# EasyEDA Pro project ProPrj_MBC1  FRAM（AM29F016）(定稿)_2024-09-28.epro, board 1
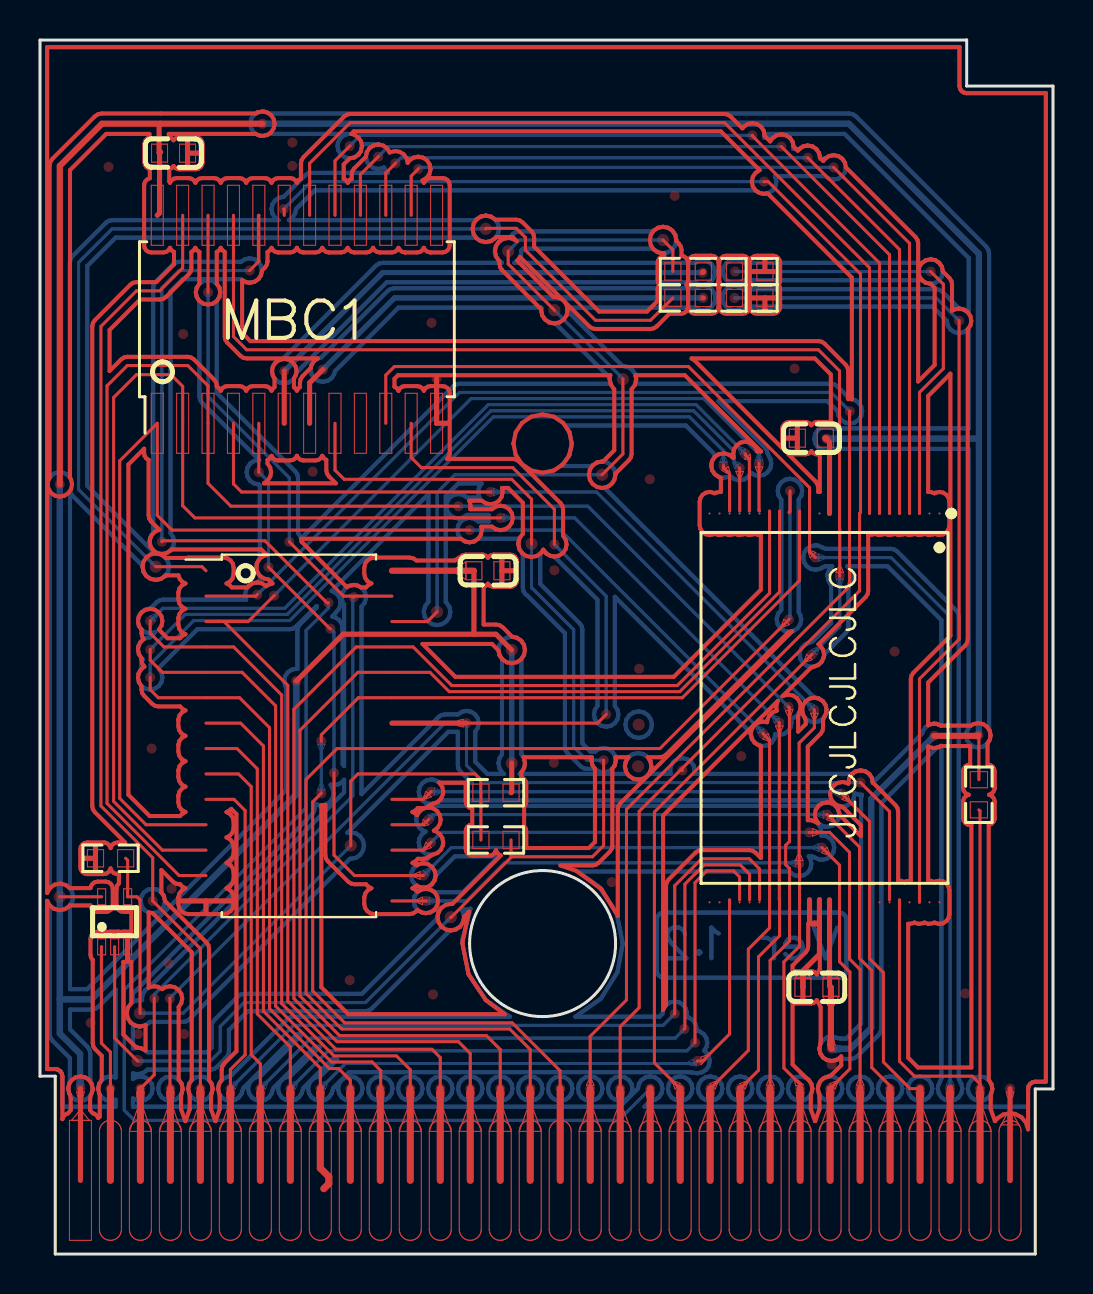
[diagram p3: board, top side]
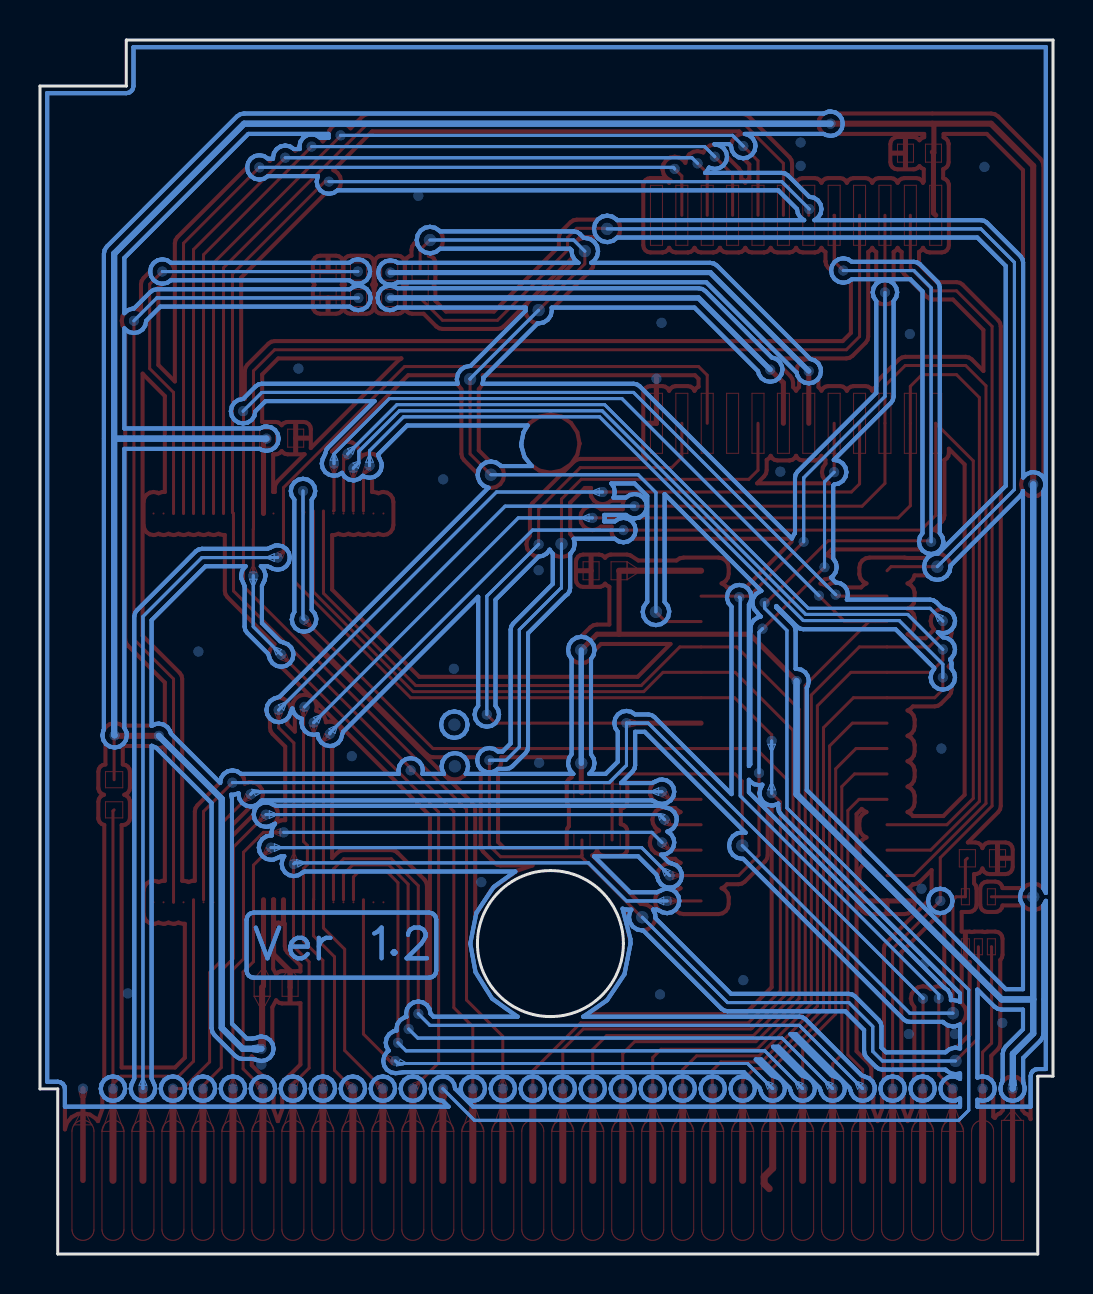
[diagram p4: board, bottom side, seen from below]

Outline 50.67 x 60.7 mm; copper layers: Top Layer, Bottom Layer. Coordinates in mm from the lower left corner of the outline.
Outline path: 0,60.7 46.35,60.7 46.35,58.4 50.67,58.4 50.67,8.25 49.78,8.25 49.78,0 0.76,0 0.76,8.89 0,8.89 0,60.7 ; 21.49,15.52 arc(25.14,19.17) 28.79,15.52 arc(25.14,11.87) 21.49,15.52

## Placement (name value [footprint] x y rotation side)

## Nets

## Routing (per net, layer and track width the routed paths; a pad name or vN(x,y) marks a point on that pad's centre or on a via; arc(x,y) is an arc through that point)
(no net): length 8305.5
  Top Layer w0.152: 35.02,8.27 35.94,9.19 35.94,14.86 36.99,15.91 36.99,17.71 36.98,17.72 36.98,26.57 ; 22.53,38.1 10.08,38.1 9.68,38.51 9.68,41.54 ; 10.95,49.64 10.95,49.63 10.49,49.17 ; 10.95,49.64 10.93,49.66 10.93,51.92 10.95,51.94 10.95,49.64 ; 25.73,35.48 25.73,37.24 23.65,39.32 19.07,39.32 18.57,39.83 18.57,41.54 ; 8.3,20.19 6.12,20.19 3.68,22.63 3.68,42.82 4.83,43.97 6.55,43.97 7.14,43.38 7.14,37.41 7.75,36.81 23.04,36.81 ; 35.64,55.93 35.64,55.91 41.99,49.55 41.99,37.03 ; 45.97,46.66 45.97,30.73 43.99,28.75 43.99,17.58 ; 8.3,34.16 8.1,34.37 5.79,34.37 ; 32.23,11.25 32.26,11.28 32.26,18.49 33.22,19.46 35.03,19.46 35.49,18.99 35.49,17.71 ; 14.07,23.04 13.64,22.61 13.64,13.16 15.24,11.56 23.62,11.56 26.01,9.17 26.02,8.27 ; 22.06,20.7 22.06,23.06 22.05,23.07 22.05,23.72 21.77,24 15.9,24 15.54,23.65 15.54,20.42 ; 31.66,47.8 30.54,46.69 27.79,46.69 24.28,50.19 24.28,50.83 23.82,51.28 22.33,51.28 22.3,51.26 ; 12.52,8.27 12.52,10.35 10.87,12 10.87,24.26 9.85,25.27 8.3,25.27 ; 44.55,49.12 45.19,48.49 45.19,44.27 43.99,43.08 43.99,37.03 ; 35.99,37.15 35.97,37.18 35.97,39.52 ; 17.6,20.19 19.18,20.19 19.56,20.57 ; 5.51,30.23 5.51,29.69 6.12,29.08 10.11,29.08 11.79,27.41 11.79,12.39 14.58,9.6 16.61,9.6 17.04,9.17 17.04,8.29 17.02,8.27 ; 19.86,32.11 19.38,31.62 17.6,31.62 ; 21.52,8.27 21.52,10.02 20.93,10.62 14.86,10.62 12.7,12.77 12.7,27.24 15.82,30.35 18.67,30.35 20.6,28.42 31.88,28.42 36.49,33.04 36.49,37.15 ; 16.92,54.86 16.03,53.97 16.03,51.94 ; 32.08,24.24 40.99,33.15 41,37.03 ; 32.08,24.24 29.97,22.13 29.97,12.32 29.02,11.37 29.02,8.27 ; 32.08,24.24 32.13,24.18 32.13,24.18 ; 38.79,34.82 38.49,35.12 38.49,38.32 32.44,44.37 17.73,44.37 17.3,43.94 17.3,41.54 ; 35.99,17.71 35.99,19.25 35.48,19.76 33.1,19.76 31.75,18.42 31.75,12.01 ; 46.97,22.21 47.02,22.15 47.02,8.5 ; 25.73,47.19 23.42,49.5 23.42,50.14 ; 19.56,23.11 19.18,22.73 17.6,22.73 ; 17.3,51.94 17.3,54.05 17.78,54.53 ; 19.43,21.72 19.18,21.46 17.6,21.46 ; 31.17,50.7 31.66,50.21 31.66,49.12 ; 23.56,19.94 23.56,19.83 20.57,16.84 20.55,16.84 ; 23.56,19.94 23.56,20.7 ; 23.56,19.94 23.64,19.86 27.63,19.86 28.19,20.42 28.19,24.69 ; 3.08,15.36 3.07,15.35 3.07,10.54 3.52,10.09 3.52,8.27 ; 34.49,17.71 34.49,11 33.15,9.65 32.89,9.65 ; 14.76,51.94 14.76,54.66 15.49,55.4 ; 9.52,8.27 9.52,9.22 10.26,9.96 10.26,22.17 9.7,22.73 8.3,22.73 ; 35.28,40 35.28,39.95 35.48,39.75 35.48,37.15 ; 3.73,15.36 3.73,10.79 4.88,9.65 ; 8.3,32.89 10.79,32.89 10.87,32.97 ; 9.2,31.62 12.4,28.43 12.4,12.65 14.81,10.24 19.61,10.24 20.02,9.82 20.02,8.27 ; 5.51,28.83 5.51,28.22 5.92,27.81 9.98,27.81 11.48,26.32 11.48,12.27 14.48,9.27 14.94,9.27 15.52,8.68 15.52,8.27 ; 17.6,32.89 15.19,32.89 12.47,35.61 ; 33.52,8.27 35.43,10.18 35.43,15.24 36.49,16.3 36.49,25.69 36.17,26.01 ; 34.99,17.71 34.99,18.86 34.7,19.15 33.35,19.15 32.77,18.57 32.77,10.57 ; 12.22,51.94 12.22,52.22 12.19,52.25 ; 42.99,17.71 42.99,9.64 43.74,8.89 46.63,8.89 47.02,8.5 ; 38.48,21.08 39.5,21.08 40.49,20.09 40.49,14.75 41.02,14.22 41.02,8.27 ; 38.61,29.97 30.73,22.1 30.73,9.56 32.02,8.27 ; 14.02,8.27 14.02,9.29 11.18,12.14 11.18,25.4 10.04,26.54 8.3,26.54 ; 42.49,37.03 42.49,49.96 37.08,55.37 ; 20.93,37.39 9.55,37.39 8.41,38.53 8.41,43.41 7.39,44.42 4.37,44.42 3.35,43.41 3.35,22.53 6.96,18.92 8.3,18.92 ; 40,33.91 40,36.24 39.99,36.25 39.99,44.16 38.94,45.21 10.34,45.21 9.68,45.87 9.68,51.94 ; 8.02,8.27 8.02,15.27 5.64,17.65 5.64,19.81 3.05,22.4 3.05,46.38 4.83,48.16 5.99,48.16 7.14,49.3 7.14,51.94 ; 26.01,7.98 26.02,7.97 ; 47.02,8.5 47.02,8.27 ; 8.9,31.62 10.41,31.62 11.71,32.92 ; 8.9,31.62 8.89,31.63 ; 8.9,31.62 8.3,31.62 ; 8.3,24 9.93,24 10.57,23.37 10.57,9.97 11.02,9.51 11.02,8.27 ; 14.07,25.65 14.07,25.96 15.93,27.81 32.13,27.81 37.99,33.67 37.99,37.15 ; 38.41,54.81 42.99,50.22 42.99,37.03 ; 28.32,26.97 27.89,26.54 21.34,26.54 ; 14.71,24.05 14.71,19.94 15.73,18.92 19.18,18.92 ; 17.6,17.65 19.3,17.65 ; 37.47,31.72 31.01,25.27 14.86,25.27 13.31,23.72 13.31,13.03 15.06,11.28 15.09,11.28 15.11,11.25 23.5,11.25 24.52,10.22 24.52,8.27 ; 36.22,53.62 36.42,53.62 41.04,49 41.04,37.08 40.99,37.03 ; 34.19,39.42 34.19,39.32 34.49,39.01 34.49,37.15 ; 8.3,21.46 5.31,21.46 3.99,22.78 3.99,39.66 5.87,41.54 5.87,36.93 6.6,36.19 21.49,36.19 ; 6.5,12.78 6.5,8.29 6.52,8.27 ; 18.52,8.27 18.52,9.21 17.83,9.91 14.71,9.91 12.09,12.52 12.09,27.95 9.69,30.35 6.2,30.35 5.51,31.04 5.51,31.65 ; 37.52,38.15 37.52,37.14 37.47,37.08 ; 24.59,35.51 24.59,37.74 23.6,38.73 15.22,38.73 14.76,39.19 14.76,41.54 ; 0.99,17.86 1,17.86 3.08,17.86 ; 5.72,12.78 5.72,8.96 5.02,8.27 ; 39.37,21.97 40.99,20.35 40.99,14.78 41.6,14.17 41.6,9.32 42.52,8.4 42.52,8.27 ; 27.52,8.27 27.52,10.89 29.34,12.7 29.34,22.23 40.49,33.39 40.49,42.12 40.51,42.14 ; 8.41,48.08 8.41,51.94 ; 41.05,23.57 42.49,22.12 42.49,17.71 ; 29.16,43.74 29.16,40 28.12,38.96 ; 37.44,27.36 37.49,27.31 37.49,20.62 37.3,20.43 37.3,19.47 37.49,19.28 37.49,15.65 36.52,14.68 36.52,8.27 ; 39.52,8.27 40.51,9.26 40.51,14.1 39.99,14.62 39.99,19.44 39.12,20.32 ; 44.02,8.27 43.52,8.27 42.19,9.6 42.19,14.07 41.49,14.77 41.49,21.63 40.13,22.99 ; 14.43,32.56 14.35,32.56 11.25,35.66 6.15,35.66 6.1,35.61 ; 18.57,51.94 18.57,53.9 18.92,54.25 ; 13.49,51.94 13.49,54.53 15.52,56.57 34.24,56.57 41.49,49.31 41.49,37.03 ; 36.99,37.15 36.99,33.11 32,28.12 20.47,28.12 19.51,29.08 15.9,29.08 13,26.19 13,12.9 14.98,10.92 22.33,10.92 23.02,10.23 23.02,8.27 ; 5,12.04 5,17.7 4.85,17.86 4.38,17.86 4.38,19.69 4.28,19.79 ; 10.95,39.09 10.95,41.54 ; 38.74,27.2 38.74,26.31 37.97,25.55 37.97,19.51 37.99,19.49 37.99,15.39 37.21,14.61 37.21,9.29 38.02,8.48 38.02,8.27 ; 46.94,25.93 46.97,25.91 46.97,23.72 ; 11.43,34.34 14.5,31.27 14.53,31.27 ; 35,39.29 35,37.15 ; 39.7,54.33 43.49,50.54 43.49,37.03 ; 15.7,32.84 15.75,32.89
  Top Layer w0.203: 35.5,48.23 35.52,48.34 35.58,48.46 35.53,48.56 35.5,48.69 ; 35.5,48.23 35.5,47.37 ; 35.5,48.23 35.5,47.37 ; 35.5,48.23 35.47,48.37 35.42,48.46 35.48,48.59 35.5,48.69 ; 35.5,49.56 35.5,48.69 ; 35.5,49.56 35.5,48.69 ; 35.5,49.56 35.47,49.69 35.39,49.81 35.28,49.89 35.14,49.91 34.34,49.91 34.2,49.89 34.08,49.81 34,49.69 33.98,49.56 33.98,48.69 34,48.56 34.06,48.46 33.99,48.34 33.98,48.23 33.98,47.37 34,47.23 34.08,47.12 34.2,47.04 34.34,47.01 35.14,47.01 35.28,47.04 35.39,47.12 35.47,47.23 35.5,47.37 ; 35.5,49.56 35.53,49.69 35.61,49.81 35.72,49.89 35.86,49.91 36.66,49.91 36.8,49.89 36.92,49.81 37,49.69 37.02,49.56 37.02,48.69 37.01,48.59 36.94,48.46 37,48.37 37.02,48.23 37.02,47.37 37,47.23 36.92,47.12 36.8,47.04 36.66,47.01 35.86,47.01 35.72,47.04 35.61,47.12 35.53,47.23 35.5,47.37 ; 9.54,17.14 9.65,17.31 9.69,17.5 9.69,17.8 9.65,18 9.54,18.16 9.37,18.27 9.33,18.29 9.5,18.38 9.63,18.54 9.69,18.73 9.69,18.77 9.69,19.07 9.65,19.27 9.54,19.43 9.37,19.54 9.33,19.56 9.5,19.65 9.63,19.81 9.69,20 9.69,20.04 9.69,20.34 9.65,20.54 9.54,20.7 9.37,20.81 9.33,20.83 9.5,20.92 9.63,21.08 9.69,21.27 9.69,21.31 9.69,21.61 9.65,21.81 9.54,21.97 9.37,22.08 9.33,22.1 9.5,22.19 9.57,22.25 9.83,21.99 9.83,10.14 9.22,9.53 9.12,9.38 9.09,9.22 9.09,8.7 8.96,8.5 8.91,8.27 8.96,8.03 8.98,7.98 8.99,7.82 8.99,7.24 8.78,6.65 8.77,6.65 8.77,6.65 8.56,7.24 8.56,7.82 8.56,7.98 8.63,8.21 8.63,8.27 8.59,8.5 8.46,8.7 8.46,15.27 8.42,15.44 8.33,15.58 6.25,17.66 6.2,17.89 6.07,18.08 6.07,19.19 6.65,18.62 6.79,18.52 6.96,18.49 7.01,18.49 7.15,18.35 7.28,18.29 7.1,18.19 6.98,18.04 6.92,17.85 6.92,17.8 6.92,17.5 6.96,17.31 7.07,17.14 7.23,17.03 7.43,17 9.18,17 9.37,17.03 9.54,17.14 ; 46.94,26.55 46.7,26.5 46.57,26.42 45.07,26.42 44.85,26.51 44.73,26.52 44.49,26.47 44.43,26.44 44.43,28.57 46.28,30.43 46.38,30.57 46.41,30.73 46.41,46.23 46.54,46.43 46.59,46.66 46.54,46.89 46.41,47.09 46.21,47.23 45.97,47.27 45.74,47.23 45.62,47.16 45.62,48.49 45.59,48.66 45.49,48.8 45.16,49.13 45.12,49.36 44.98,49.56 44.78,49.69 44.55,49.74 44.32,49.69 44.12,49.56 43.99,49.36 43.94,49.12 43.99,48.89 44.12,48.69 44.32,48.56 44.55,48.51 44.75,48.31 44.75,44.45 43.93,43.63 43.93,50.54 43.89,50.7 43.8,50.84 40.31,54.33 40.26,54.57 40.13,54.77 39.93,54.9 39.7,54.94 39.47,54.9 39.27,54.76 39.18,54.65 39.02,54.81 38.97,55.05 38.84,55.25 38.64,55.38 38.41,55.42 38.17,55.38 37.97,55.25 37.9,55.17 37.7,55.37 37.65,55.61 37.52,55.81 37.32,55.94 37.08,55.98 36.85,55.94 36.65,55.8 36.53,55.63 36.25,55.91 36.25,55.93 36.2,56.17 36.07,56.36 35.87,56.5 35.64,56.54 35.4,56.5 35.2,56.36 35.14,56.28 34.55,56.87 34.41,56.97 34.24,57 15.52,57 15.35,56.97 15.21,56.87 13.18,54.84 13.09,54.7 13.05,54.53 13.05,53.77 12.94,53.69 12.86,53.58 12.85,53.56 12.78,53.68 12.66,53.76 12.53,53.79 11.92,53.79 11.78,53.77 11.66,53.69 11.59,53.57 11.58,53.56 11.51,53.68 11.39,53.76 11.26,53.79 10.65,53.79 10.51,53.77 10.39,53.69 10.32,53.57 10.31,53.56 10.24,53.68 10.12,53.76 9.99,53.79 9.38,53.79 9.24,53.77 9.12,53.69 9.05,53.57 9.04,53.56 8.97,53.68 8.85,53.76 8.72,53.79 8.11,53.79 7.97,53.77 7.85,53.69 7.78,53.57 7.77,53.56 7.7,53.68 7.58,53.76 7.45,53.79 6.84,53.79 6.7,53.77 6.58,53.69 6.51,53.57 6.5,53.56 6.47,53.64 6.47,54.24 6.59,54.3 6.68,54.4 6.78,54.3 6.91,54.24 6.98,54.23 7.78,54.23 7.92,54.26 8.03,54.34 8.11,54.45 8.14,54.59 8.14,55.49 8.11,55.63 8.03,55.75 7.92,55.82 7.78,55.85 6.98,55.85 6.84,55.82 6.73,55.75 6.68,55.69 6.58,55.79 6.45,55.84 6.44,55.84 6.44,56 10.79,56 11.01,55.91 11.12,55.9 11.36,55.95 11.56,56.08 11.69,56.28 11.74,56.52 11.69,56.75 11.56,56.95 11.36,57.08 11.12,57.13 10.89,57.08 10.79,57.03 3.1,57.03 2.9,56.99 2.74,56.88 0.63,54.77 0.52,54.6 0.48,54.41 0.48,38.82 0.39,38.6 0.38,38.48 0.42,38.25 0.56,38.05 0.76,37.92 0.99,37.87 0.99,37.87 1.22,37.92 1.42,38.05 1.56,38.25 1.6,38.48 1.56,38.72 1.5,38.82 1.5,54.19 3.31,56 5.47,56 5.47,55.83 5.35,55.77 5.26,55.66 5.22,55.52 5.22,55.49 5.22,54.59 5.25,54.45 5.33,54.34 5.44,54.26 5.5,54.24 5.5,53.79 5.37,53.73 5.27,53.63 5.22,53.5 5.21,53.44 5.21,50.44 5.24,50.3 5.31,50.18 5.43,50.11 5.57,50.08 6.17,50.08 6.3,50.11 6.42,50.18 6.5,50.3 6.5,50.31 6.58,50.19 6.69,50.11 6.7,50.1 6.7,49.48 5.81,48.59 4.83,48.59 4.66,48.56 4.52,48.47 2.74,46.69 2.65,46.55 2.61,46.38 2.61,22.4 2.65,22.24 2.74,22.1 4.26,20.58 3.88,20.58 3.74,20.55 3.63,20.47 3.55,20.36 3.53,20.29 3.48,20.42 3.38,20.52 3.25,20.57 3.18,20.58 2.37,20.58 2.24,20.55 2.12,20.47 2.04,20.36 2.02,20.22 2.02,19.36 2.04,19.22 2.12,19.1 2.24,19.02 2.37,19 3.18,19 3.32,19.02 3.43,19.1 3.51,19.22 3.53,19.28 3.59,19.15 3.69,19.05 3.82,19 3.88,19 3.95,19 3.95,18.53 3.86,18.42 3.83,18.29 3.83,17.46 3.85,17.33 3.93,17.21 4.05,17.13 4.18,17.1 4.57,17.1 4.57,16.12 4.18,16.12 4.06,16.1 3.93,16.12 3.53,16.12 3.41,16.1 3.28,16.12 2.88,16.12 2.75,16.09 2.63,16.02 2.55,15.9 2.53,15.76 2.53,14.96 2.55,14.83 2.63,14.71 2.64,14.7 2.64,10.54 2.67,10.38 2.77,10.23 3.09,9.91 3.09,8.7 2.96,8.5 2.91,8.27 2.96,8.03 2.99,7.97 2.99,6.87 2.91,6.8 2.84,6.92 2.73,7.01 2.64,7.03 2.51,7.19 2.51,7.79 2.55,7.95 2.63,8.17 2.64,8.27 2.59,8.5 2.46,8.7 2.26,8.83 2.02,8.88 1.79,8.83 1.59,8.7 1.46,8.5 1.41,8.27 1.46,8.03 1.5,7.95 1.54,7.79 1.54,7.19 1.41,7.03 1.28,6.98 1.18,6.88 1.12,6.75 1.12,6.74 1.12,8.89 1.09,9.03 1.02,9.14 0.9,9.22 0.76,9.25 0.36,9.25 0.36,17.66 0.48,17.43 0.68,17.27 0.93,17.2 0.99,17.19 1.24,17.24 1.46,17.39 1.5,17.43 2.53,17.43 2.57,17.29 2.66,17.19 2.78,17.12 2.88,17.1 3.28,17.1 3.42,17.13 3.54,17.21 3.61,17.32 3.64,17.46 3.64,18.26 3.61,18.4 3.54,18.52 3.42,18.59 3.28,18.62 2.88,18.62 2.75,18.59 2.63,18.52 2.55,18.4 2.53,18.3 1.49,18.3 1.28,18.45 1.03,18.52 0.99,18.52 0.74,18.47 0.52,18.33 0.38,18.11 0.36,18.06 0.36,60.34 46,60.34 46,58.4 46.02,58.26 46.1,58.15 46.22,58.07 46.35,58.04 50.31,58.04 50.31,8.61 49.78,8.61 49.65,8.59 49.53,8.51 49.45,8.39 49.43,8.25 49.43,6.23 49.32,6.57 49.09,6.84 48.78,7 48.52,7.04 48.18,6.97 47.88,6.78 47.77,6.65 47.77,6.65 47.56,7.24 47.56,7.82 47.56,7.98 47.63,8.21 47.63,8.27 47.59,8.5 47.46,8.7 47.46,21.45 47.59,21.5 47.69,21.6 47.75,21.73 47.75,21.81 47.75,22.61 47.73,22.75 47.65,22.86 47.53,22.94 47.47,22.96 47.6,23.02 47.7,23.12 47.75,23.25 47.75,23.31 47.75,24.12 47.73,24.25 47.65,24.37 47.53,24.45 47.4,24.48 47.4,25.53 47.52,25.74 47.55,25.93 47.5,26.17 47.37,26.37 47.17,26.5 46.94,26.55 ; 38.99,7.82 38.99,7.24 38.78,6.65 38.77,6.65 38.77,6.65 38.56,7.24 38.56,7.82 38.56,7.98 38.63,8.21 38.63,8.27 38.59,8.5 38.46,8.7 38.42,8.73 38.17,8.95 37.65,9.47 37.65,12.55 37.76,12.53 38.56,12.53 38.7,12.55 38.81,12.63 38.86,12.69 39.05,12.34 39.05,10.69 39.03,10.5 38.99,10.27 38.99,10.26 39.03,10.03 39.16,9.83 39.36,9.7 39.6,9.65 39.6,9.65 39.83,9.7 40.03,9.83 40.08,9.88 40.08,9.44 39.57,8.93 39.42,8.87 39.19,8.78 39.02,8.62 38.93,8.4 38.91,8.27 38.96,8.03 38.98,7.98 38.99,7.82 ; 43.49,18.66 43.3,18.62 43.24,18.6 43.06,18.66 42.99,18.66 42.93,18.66 42.93,22.12 42.89,22.29 42.8,22.43 41.66,23.57 41.61,23.81 41.48,24 41.28,24.14 41.05,24.18 40.81,24.14 40.61,24 40.48,23.81 40.43,23.57 40.44,23.52 40.21,23.59 40.13,23.6 39.9,23.55 39.7,23.42 39.57,23.22 39.52,22.99 39.57,22.75 39.7,22.55 39.9,22.42 40.03,22.38 40.18,22.32 41.06,21.45 41.06,20.9 40.03,21.92 39.97,22.08 39.89,22.3 39.72,22.47 39.5,22.57 39.37,22.58 39.14,22.54 38.94,22.4 38.8,22.2 38.76,21.97 38.8,21.74 38.94,21.54 38.61,21.68 38.48,21.69 38.41,21.69 38.41,25.37 39.04,26.01 39.14,26.15 39.17,26.31 39.17,26.7 39.24,26.85 39.33,27.07 39.35,27.2 39.3,27.44 39.17,27.64 38.97,27.77 38.74,27.82 38.5,27.77 38.3,27.64 38.17,27.44 38.12,27.2 38.17,26.97 38.23,26.85 38.3,26.7 38.3,26.49 37.93,26.12 37.93,26.89 37.99,27.09 38.05,27.32 38.05,27.36 38.01,27.59 37.87,27.79 37.67,27.92 37.44,27.97 37.21,27.92 37.14,27.89 38.56,29.31 38.71,29.37 38.94,29.46 39.11,29.62 39.21,29.84 39.22,29.97 39.17,30.21 39.04,30.4 38.94,30.49 41.3,32.84 41.39,32.99 41.43,33.15 41.43,35.95 41.49,35.95 41.68,35.98 41.74,36.01 41.93,35.95 41.99,35.95 42.18,35.98 42.24,36.01 42.43,35.95 42.49,35.95 42.68,35.98 42.74,36.01 42.93,35.95 42.99,35.95 43.18,35.98 43.24,36.01 43.43,35.95 43.49,35.95 43.68,35.98 43.74,36.01 43.93,35.95 43.99,35.95 44.18,35.98 44.24,36.01 44.43,35.95 44.49,35.95 44.68,35.98 44.74,36.01 44.93,35.95 44.99,35.95 45.18,35.98 45.34,36.09 45.45,36.25 45.49,36.44 45.49,37.61 45.45,37.8 45.34,37.96 45.18,38.06 44.99,38.1 44.8,38.06 44.74,38.04 44.56,38.1 44.49,38.1 44.43,38.1 44.43,42.9 45.49,43.97 45.54,44.02 45.54,30.91 43.69,29.06 43.59,28.92 43.56,28.75 43.56,18.66 43.49,18.66 ; 22.05,50.64 22.3,50.59 22.55,50.64 22.77,50.79 22.82,50.85 23.65,50.85 23.85,50.64 23.62,50.77 23.42,50.8 23.16,50.75 22.95,50.61 22.81,50.39 22.76,50.14 22.81,49.89 22.95,49.67 22.98,49.64 22.98,49.5 23.02,49.34 23.11,49.2 25.07,47.24 25.07,47.19 25.12,46.94 25.26,46.72 25.48,46.58 25.73,46.53 25.98,46.58 26.2,46.72 26.34,46.94 26.39,47.19 26.34,47.45 26.23,47.63 27.48,46.38 27.62,46.28 27.79,46.25 27.79,46.25 30.54,46.25 30.71,46.28 30.85,46.38 30.85,46.38 31.48,47.01 32.06,47.01 32.2,47.04 32.31,47.12 32.39,47.23 32.42,47.37 32.42,48.23 32.39,48.37 32.34,48.46 32.4,48.59 32.42,48.69 32.42,49.56 32.39,49.69 32.31,49.81 32.2,49.89 32.09,49.91 32.09,50.21 32.06,50.37 31.96,50.51 31.83,50.65 31.83,50.7 31.78,50.95 31.63,51.17 31.42,51.31 31.17,51.36 30.91,51.31 30.7,51.17 30.55,50.95 30.5,50.7 30.55,50.44 30.7,50.23 30.91,50.09 31.17,50.03 31.21,50.04 31.22,50.03 31.22,49.91 31.09,49.87 30.98,49.79 30.91,49.66 30.9,49.56 30.9,48.69 30.92,48.56 30.98,48.46 30.91,48.34 30.9,48.23 30.9,47.66 30.36,47.12 27.97,47.12 24.72,50.37 24.72,50.83 24.68,50.99 24.59,51.13 24.13,51.59 23.99,51.68 23.82,51.72 22.78,51.72 22.57,51.86 22.31,51.92 22.3,51.92 22.05,51.87 21.83,51.73 21.69,51.51 21.64,51.26 21.69,51 21.83,50.79 22.05,50.64 ; 5.08,31.04 5.11,30.87 5.19,30.75 5.02,30.58 4.92,30.37 4.9,30.23 4.95,29.99 5.08,29.8 5.08,29.69 5.11,29.53 5.2,29.39 5.22,29.37 5.04,29.22 4.93,29 4.9,28.83 4.95,28.59 5.08,28.4 5.08,28.22 5.11,28.05 5.2,27.91 5.61,27.51 5.75,27.41 5.92,27.38 7.01,27.38 7.15,27.24 7.28,27.18 7.1,27.08 6.98,26.93 6.92,26.74 6.92,26.69 6.92,26.39 6.96,26.2 7.07,26.03 7.23,25.92 7.28,25.91 7.1,25.81 6.98,25.66 6.92,25.47 6.92,25.42 6.92,25.12 6.96,24.93 7.07,24.76 7.23,24.65 7.28,24.64 7.1,24.54 6.98,24.39 6.92,24.2 6.92,24.15 6.92,23.85 6.96,23.66 7.07,23.49 7.23,23.38 7.28,23.37 7.1,23.27 6.98,23.12 6.92,22.93 6.92,22.88 6.92,22.58 6.96,22.39 7.07,22.22 7.23,22.11 7.28,22.1 7.1,22 7.01,21.9 5.49,21.9 4.42,22.96 4.42,39.48 5.21,40.26 5.21,40.04 5.24,39.9 5.31,39.78 5.43,39.7 5.43,39.7 5.43,36.93 5.47,36.77 5.56,36.62 5.97,36.21 5.75,36.12 5.59,35.95 5.5,35.73 5.48,35.61 5.53,35.38 5.66,35.18 5.86,35.05 6.1,35 6.33,35.05 6.53,35.18 6.57,35.23 11.07,35.23 11.35,34.95 11.13,34.87 10.95,34.72 10.84,34.5 10.82,34.34 10.86,34.11 11,33.91 11.2,33.78 11.43,33.73 11.63,33.53 11.4,33.45 11.32,33.39 11.12,33.53 10.89,33.58 10.87,33.58 10.64,33.53 10.44,33.4 10.38,33.33 9.6,33.33 9.46,33.47 9.33,33.53 9.5,33.62 9.63,33.78 9.69,33.97 9.69,34.01 9.69,34.31 9.65,34.51 9.54,34.67 9.37,34.78 9.18,34.82 7.43,34.82 7.29,34.8 6.29,34.8 6.09,34.96 5.84,35.03 5.79,35.03 5.54,34.98 5.32,34.83 5.18,34.62 5.13,34.37 5.18,34.11 5.32,33.9 5.54,33.75 5.79,33.7 6.04,33.75 6.26,33.9 6.29,33.93 6.93,33.93 7,33.75 7.13,33.6 7.28,33.53 7.1,33.43 6.98,33.28 6.92,33.09 6.92,33.04 6.92,32.74 6.96,32.55 7.07,32.38 7.23,32.27 7.28,32.26 7.1,32.16 6.98,32.01 6.92,31.82 6.92,31.77 6.92,31.47 6.96,31.28 7.07,31.11 7.23,31 7.28,30.99 7.1,30.89 7.01,30.79 6.38,30.79 5.95,31.22 6.08,31.42 6.12,31.65 6.08,31.88 5.94,32.08 5.75,32.21 5.51,32.26 5.28,32.21 5.08,32.08 4.95,31.88 4.9,31.65 4.95,31.41 5.08,31.22 5.08,31.04 ; 7.13,8.21 7.14,8.27 7.09,8.5 6.96,8.7 6.94,8.72 6.94,12.34 7.07,12.54 7.11,12.78 7.07,13.01 6.94,13.21 6.74,13.34 6.5,13.39 6.5,13.39 6.27,13.34 6.11,13.25 5.9,13.36 5.72,13.39 5.48,13.34 5.44,13.32 5.44,17.08 5.64,17.04 7.59,15.09 7.59,8.7 7.46,8.5 7.41,8.27 7.46,8.03 7.48,7.98 7.49,7.82 7.49,7.24 7.28,6.65 7.27,6.65 7.27,6.65 7.06,7.24 7.06,7.82 7.06,7.98 7.13,8.21 ; 35.65,53.38 35.79,53.19 35.99,53.05 36.22,53.01 36.4,53.03 40.61,48.82 40.61,42.74 40.51,42.75 40.43,42.75 40.43,44.16 40.39,44.32 40.3,44.46 39.25,45.52 39.1,45.61 38.94,45.65 10.52,45.65 10.11,46.05 10.11,48.69 10.32,48.58 10.49,48.56 10.72,48.61 10.92,48.74 11.06,48.94 11.1,49.17 11.25,49.32 11.35,49.47 11.38,49.63 11.38,50.1 11.5,50.18 11.58,50.3 11.58,50.31 11.66,50.19 11.77,50.11 11.91,50.08 12.52,50.08 12.65,50.11 12.77,50.18 12.85,50.3 12.85,50.31 12.93,50.19 13.04,50.11 13.18,50.08 13.79,50.08 13.92,50.11 14.04,50.18 14.12,50.3 14.12,50.31 14.2,50.19 14.31,50.11 14.45,50.08 15.06,50.08 15.19,50.11 15.31,50.18 15.39,50.3 15.39,50.31 15.47,50.19 15.58,50.11 15.72,50.08 16.33,50.08 16.46,50.11 16.58,50.18 16.66,50.3 16.66,50.31 16.74,50.19 16.85,50.11 16.99,50.08 17.6,50.08 17.73,50.11 17.85,50.18 17.93,50.3 17.93,50.31 18.01,50.19 18.12,50.11 18.26,50.08 18.87,50.08 19,50.11 19.12,50.18 19.2,50.3 19.2,50.31 19.28,50.19 19.39,50.11 19.53,50.08 20.14,50.08 20.27,50.11 20.39,50.18 20.47,50.3 20.5,50.44 20.5,53.44 20.47,53.57 20.39,53.69 20.28,53.77 20.14,53.79 19.54,53.79 19.4,53.77 19.28,53.69 19.21,53.57 19.2,53.56 19.13,53.68 19.34,53.8 19.48,53.99 19.53,54.23 19.53,54.25 19.49,54.49 19.36,54.69 19.16,54.82 18.92,54.87 18.69,54.82 18.49,54.69 18.39,54.56 18.34,54.79 18.19,54.98 17.99,55.11 17.78,55.15 17.55,55.1 17.49,55.07 17.37,55.28 17.18,55.42 16.94,55.48 16.92,55.48 16.68,55.43 16.48,55.3 16.35,55.1 16.3,54.87 15.72,54.28 15.63,54.14 15.59,53.97 15.59,53.77 15.48,53.69 15.4,53.58 15.39,53.56 15.32,53.68 15.2,53.76 15.19,53.77 15.19,54.48 15.5,54.78 15.73,54.83 15.93,54.97 16.06,55.16 16.11,55.4 16.06,55.63 15.93,55.83 15.73,55.96 15.57,56 15.7,56.13 34.06,56.13 36,54.19 35.8,54.06 35.66,53.87 35.61,53.64 35.61,53.62 35.65,53.38 ; 24.22,22.38 24.3,22.49 24.32,22.63 24.32,22.63 24.32,23.5 24.3,23.63 24.22,23.75 24.1,23.83 24.08,23.83 24.08,24.08 24.22,24.31 24.26,24.54 24.21,24.79 24.19,24.84 27.6,24.84 27.58,24.69 27.63,24.45 27.76,24.26 27.76,20.6 27.46,20.3 24.32,20.3 24.32,21.13 24.3,21.27 24.22,21.39 24.22,22.38 ; 44.93,16.51 44.99,16.51 45.18,16.55 45.34,16.65 45.45,16.81 45.49,17 45.49,18.17 45.45,18.36 45.34,18.52 45.18,18.62 44.99,18.66 44.8,18.62 44.74,18.6 44.56,18.66 44.49,18.66 44.43,18.66 44.43,25.38 44.65,25.3 44.73,25.3 44.96,25.34 45.07,25.4 46.53,25.4 46.53,24.48 46.39,24.45 46.28,24.37 46.2,24.25 46.17,24.12 46.17,23.31 46.2,23.17 46.28,23.06 46.4,22.98 46.46,22.96 46.33,22.91 46.23,22.81 46.18,22.68 46.17,22.61 46.17,21.81 46.2,21.67 46.28,21.55 46.4,21.47 46.53,21.45 46.59,21.45 46.59,9.32 43.92,9.32 43.43,9.82 43.43,16.51 43.49,16.51 43.68,16.55 43.74,16.57 43.93,16.51 43.99,16.51 44.18,16.55 44.24,16.57 44.43,16.51 44.49,16.51 44.68,16.55 44.74,16.57 44.93,16.51 ; 20.55,17.5 20.29,17.45 20.08,17.31 19.94,17.09 19.89,16.84 19.94,16.59 20.08,16.37 20.29,16.23 20.55,16.18 20.8,16.23 21.02,16.37 21.16,16.59 21.21,16.84 21.21,16.86 21.46,17.12 21.13,15.59 21.13,15.52 21.44,13.99 22.31,12.69 23.24,11.99 15.42,11.99 14.07,13.34 14.07,22.43 14.27,22.46 14.27,19.94 14.31,19.78 14.4,19.64 15.42,18.62 15.56,18.52 15.73,18.49 16.31,18.49 16.45,18.35 16.58,18.29 16.4,18.19 16.28,18.04 16.22,17.85 16.22,17.8 16.22,17.5 16.26,17.31 16.37,17.14 16.53,17.03 16.73,17 18.48,17 18.67,17.03 18.84,17.14 18.88,17.19 18.95,17.15 19.17,17.06 19.3,17.04 19.54,17.09 19.74,17.22 19.87,17.42 19.92,17.65 19.87,17.89 19.74,18.09 19.54,18.22 19.3,18.27 19.07,18.22 18.95,18.16 18.88,18.12 18.72,18.25 18.63,18.29 18.81,18.38 18.84,18.41 19.06,18.32 19.18,18.31 19.41,18.36 19.61,18.49 19.74,18.69 19.79,18.92 19.74,19.16 19.61,19.36 19.41,19.49 19.18,19.53 18.94,19.49 18.84,19.43 18.67,19.54 18.63,19.56 18.81,19.65 18.9,19.76 19.18,19.76 19.34,19.79 19.48,19.89 19.51,19.91 19.66,19.97 19.89,20.06 20.06,20.22 20.16,20.44 20.17,20.57 20.12,20.81 19.99,21.01 19.79,21.14 19.7,21.17 19.89,21.31 20.01,21.52 20.04,21.72 20,21.95 19.86,22.15 19.66,22.28 19.43,22.33 19.2,22.28 19,22.15 18.87,21.95 18.86,21.95 18.71,22.07 18.63,22.1 18.81,22.19 18.9,22.3 19.18,22.3 19.34,22.33 19.48,22.43 19.51,22.45 19.66,22.51 19.89,22.6 20.06,22.76 20.16,22.98 20.17,23.11 20.12,23.35 19.99,23.55 19.97,23.57 21.3,23.57 21.29,23.5 21.29,22.63 21.32,22.49 21.4,22.38 21.51,22.3 21.62,22.27 21.62,21.49 21.49,21.45 21.38,21.36 21.31,21.24 21.29,21.13 21.29,20.27 21.32,20.13 21.4,20.02 21.51,19.94 21.65,19.91 22.46,19.91 22.6,19.94 22.71,20.02 22.79,20.13 22.81,20.19 22.86,20.07 22.96,19.97 23.05,19.93 20.62,17.5 20.55,17.5 ; 7.39,44.86 4.37,44.86 4.2,44.83 4.06,44.73 3.48,44.15 3.48,46.2 5.01,47.72 5.99,47.72 6.16,47.76 6.3,47.85 6.3,47.85 7.44,48.99 7.54,49.14 7.57,49.3 7.57,50.1 7.69,50.18 7.77,50.3 7.77,50.31 7.85,50.19 7.96,50.11 7.97,50.1 7.97,48.51 7.84,48.31 7.8,48.08 7.84,47.85 7.97,47.65 8.17,47.52 8.41,47.47 8.64,47.52 8.84,47.65 8.97,47.85 9.02,48.08 8.97,48.32 8.84,48.51 8.84,50.1 8.96,50.18 9.04,50.3 9.04,50.31 9.12,50.19 9.23,50.11 9.24,50.1 9.24,45.87 9.28,45.71 9.37,45.56 10.03,44.91 10.17,44.81 10.34,44.78 13.89,44.78 13.7,44.64 13.57,44.43 13.54,44.3 13.14,43.9 13.04,43.75 13,43.56 13,43.34 12.9,43.25 12.85,43.16 12.78,43.28 12.7,43.34 12.7,43.77 12.81,43.99 12.83,44.14 12.78,44.38 12.65,44.58 12.45,44.71 12.22,44.76 12.22,44.76 11.98,44.71 11.78,44.58 11.65,44.38 11.6,44.14 11.65,43.91 11.73,43.77 11.73,43.34 11.63,43.25 11.58,43.16 11.51,43.28 11.39,43.36 11.26,43.39 10.65,43.39 10.51,43.37 10.39,43.29 10.32,43.17 10.31,43.16 10.24,43.28 10.12,43.36 9.99,43.39 9.38,43.39 9.24,43.37 9.12,43.29 9.05,43.17 9.04,43.16 8.97,43.28 8.85,43.36 8.84,43.37 8.84,43.41 8.81,43.58 8.72,43.72 7.7,44.73 7.56,44.83 7.39,44.86 ; 39.56,41.6 38.88,41.6 38.75,41.57 38.63,41.5 38.58,41.44 38.49,41.54 38.36,41.59 38.28,41.6 37.48,41.6 37.35,41.57 37.23,41.5 37.15,41.38 37.12,41.24 37.12,41.24 37.12,40.34 37.13,40.3 32.74,44.68 32.6,44.78 32.6,44.78 38.76,44.78 39.56,43.98 39.56,41.6 ; 24.12,35.04 24.33,34.9 24.59,34.85 24.84,34.9 25.06,35.04 25.18,35.21 25.33,35.02 25.53,34.91 25.73,34.87 25.96,34.92 26.16,35.05 26.3,35.25 26.34,35.48 26.3,35.72 26.16,35.92 26.16,37.24 26.13,37.4 26.04,37.54 23.96,39.63 23.81,39.72 23.65,39.75 23.65,39.75 20.36,39.75 20.45,39.86 20.49,39.99 20.5,40.04 20.5,43.04 20.47,43.17 20.39,43.29 20.28,43.37 20.14,43.39 19.54,43.39 19.4,43.37 19.28,43.29 19.21,43.17 19.2,43.16 19.13,43.28 19.01,43.36 18.88,43.39 18.27,43.39 18.13,43.37 18.01,43.29 17.94,43.17 17.93,43.16 17.86,43.28 17.74,43.36 17.73,43.37 17.73,43.76 17.91,43.94 28.53,43.94 28.5,43.74 28.55,43.48 28.69,43.27 28.72,43.24 28.72,40.19 28.16,39.62 28.12,39.63 27.86,39.58 27.65,39.43 27.51,39.22 27.46,38.96 27.51,38.71 27.65,38.5 27.86,38.35 28.12,38.3 28.37,38.35 28.59,38.5 28.73,38.71 28.78,38.96 28.78,39.01 29.47,39.7 29.56,39.84 29.59,40 29.59,43.24 29.75,43.44 29.82,43.69 29.82,43.74 29.79,43.94 32.26,43.94 36.07,40.13 35.97,40.14 35.88,40.13 35.79,40.35 35.62,40.52 35.4,40.61 35.28,40.62 35.05,40.57 34.85,40.44 34.72,40.24 34.67,40 34.7,39.82 34.66,39.81 34.48,39.96 34.25,40.03 34.19,40.03 33.95,39.99 33.75,39.85 33.62,39.66 33.58,39.42 33.62,39.19 33.75,38.99 33.94,38.86 34.06,38.79 34.06,38.1 33.99,38.1 33.8,38.06 33.74,38.04 33.56,38.1 33.49,38.1 33.3,38.06 33.14,37.96 33.03,37.8 33,37.61 33,36.44 33.03,36.25 33.14,36.09 33.3,35.98 33.49,35.95 33.68,35.98 33.74,36.01 33.93,35.95 33.99,35.95 34.18,35.98 34.24,36.01 34.43,35.95 34.49,35.95 34.68,35.98 34.74,36.01 34.93,35.95 34.99,35.95 35.18,35.98 35.24,36.01 35.43,35.95 35.49,35.95 35.68,35.98 35.74,36.01 35.93,35.95 35.99,35.95 36.06,35.95 36.06,33.22 31.7,28.86 20.78,28.86 19.13,30.5 22.61,30.5 22.93,30.18 22.99,29.92 23.15,29.72 23.37,29.58 23.6,29.54 23.85,29.59 24.07,29.73 24.21,29.95 24.26,30.2 24.21,30.45 24.07,30.67 23.85,30.81 23.62,30.86 23.15,31.33 22.99,31.44 22.81,31.47 22.19,31.47 22.19,33.36 22.32,33.42 22.41,33.52 22.5,33.42 22.63,33.36 22.71,33.36 23.51,33.36 23.64,33.38 23.76,33.46 23.84,33.58 23.86,33.71 23.86,34.61 23.84,34.75 23.76,34.87 23.64,34.94 23.51,34.97 22.71,34.97 22.57,34.94 22.45,34.87 22.41,34.81 22.31,34.91 22.18,34.96 22.11,34.97 21.31,34.97 21.17,34.94 21.11,34.91 20.74,34.67 18.84,34.67 18.67,34.78 18.48,34.82 16.73,34.82 16.53,34.78 16.37,34.67 16.26,34.51 16.22,34.31 16.22,34.01 16.26,33.82 16.37,33.65 16.53,33.54 16.58,33.53 16.4,33.43 16.31,33.33 16.07,33.33 15.86,33.43 15.7,33.45 15.46,33.41 15.35,33.35 13.08,35.61 13.06,35.76 21.06,35.76 21.26,35.63 21.49,35.58 21.72,35.63 21.92,35.76 22.05,35.96 22.1,36.19 22.07,36.37 22.61,36.37 22.81,36.24 23.04,36.19 23.27,36.24 23.47,36.37 23.6,36.57 23.65,36.8 23.6,37.04 23.47,37.24 23.27,37.37 23.04,37.42 22.8,37.37 22.61,37.24 21.52,37.24 21.54,37.39 21.5,37.62 21.48,37.67 22.1,37.67 22.3,37.53 22.53,37.49 22.76,37.53 22.96,37.67 23.1,37.87 23.14,38.1 23.11,38.3 23.42,38.3 24.15,37.56 24.15,36.01 23.99,35.81 23.93,35.56 23.92,35.51 23.97,35.25 24.12,35.04 ; 4.57,12.54 4.41,12.34 4.34,12.09 4.34,12.04 4.39,11.79 4.53,11.57 4.75,11.43 5,11.38 5.26,11.43 5.28,11.44 5.28,10.18 5.05,10.29 4.88,10.31 4.83,10.31 4.17,10.97 4.17,14.6 4.57,14.6 4.57,12.54 ; 36.83,27.36 36.86,27.17 36.64,27.07 36.47,26.9 36.38,26.68 36.37,26.59 36.17,26.62 35.94,26.58 35.74,26.44 35.6,26.24 35.56,26.01 35.6,25.78 35.74,25.58 35.93,25.44 36.06,25.41 36.06,19.8 35.79,20.07 35.65,20.16 35.48,20.2 33.1,20.2 32.93,20.16 32.79,20.07 31.44,18.72 31.35,18.58 31.32,18.42 31.32,12.45 31.18,12.25 31.17,12.2 31.17,21.92 36.91,27.66 36.83,27.43 36.83,27.36 ; 32.45,49.69 32.42,49.56 32.42,48.69 32.45,48.56 32.5,48.46 32.44,48.34 32.42,48.23 32.42,47.37 32.45,47.23 32.53,47.12 32.64,47.04 32.78,47.01 33.58,47.01 33.72,47.04 33.84,47.12 33.91,47.23 33.94,47.37 33.94,48.23 33.91,48.37 33.86,48.46 33.93,48.59 33.94,48.69 33.94,49.56 33.91,49.69 33.84,49.81 33.72,49.89 33.58,49.91 32.78,49.91 32.64,49.89 32.53,49.81 32.45,49.69 ; 14.12,39.91 14.2,39.79 14.31,39.71 14.32,39.7 14.32,39.19 14.36,39.03 14.45,38.89 14.8,38.53 11.2,38.53 11.4,38.67 11.52,38.88 11.56,39.09 11.51,39.33 11.38,39.52 11.38,39.7 11.5,39.78 11.58,39.9 11.58,39.91 11.66,39.79 11.77,39.71 11.91,39.68 12.52,39.68 12.65,39.7 12.77,39.78 12.85,39.9 12.85,39.91 12.93,39.79 13.04,39.71 13.18,39.68 13.79,39.68 13.92,39.7 14.04,39.78 14.12,39.9 14.12,39.91 ; 31.18,24.87 31.32,24.97 37.41,31.06 37.57,31.12 37.62,31.13 29.03,22.54 28.94,22.4 28.9,22.23 28.9,16.91 28.09,18.24 26.82,19.16 26.04,19.43 27.63,19.43 27.8,19.46 27.94,19.56 28.5,20.11 28.59,20.25 28.63,20.42 28.63,24.26 28.76,24.46 28.81,24.69 28.79,24.84 29.44,24.84 29.3,24.62 29.26,24.38 29.31,24.13 29.45,23.92 29.67,23.77 29.92,23.72 30.17,23.77 30.39,23.92 30.53,24.13 30.58,24.38 30.53,24.64 30.4,24.84 31.01,24.84 31.18,24.87 ; 38.68,16.55 38.74,16.57 38.93,16.51 38.99,16.51 39.01,16.51 39.01,14.26 38.86,13.98 38.76,14.08 38.63,14.14 38.56,14.14 37.76,14.14 37.65,14.12 37.65,14.42 38.3,15.08 38.39,15.22 38.43,15.39 38.43,16.51 38.49,16.51 38.68,16.55 ; 38.8,38.62 37.44,39.99 37.48,39.98 38.28,39.98 38.42,40.01 38.54,40.09 38.58,40.15 38.68,40.05 38.81,39.99 38.88,39.98 39.01,39.98 39.01,38.1 38.99,38.1 38.93,38.1 38.93,38.32 38.89,38.48 38.8,38.62 ; 24.58,41.87 24.11,41.55 23.79,41.08 23.68,40.52 23.68,40.52 23.79,39.96 24.11,39.49 24.58,39.17 25.14,39.06 25.7,39.17 26.17,39.49 26.49,39.96 26.6,40.52 26.49,41.08 26.17,41.55 25.7,41.87 25.14,41.98 24.58,41.87 ; 25.94,47.82 25.73,47.86 25.68,47.85 23.88,49.66 24.01,49.85 26.16,47.69 25.94,47.82
  Top Layer w0.254: 23.6,24.54 23.6,23.1 23.56,23.06 ; 38.99,17.71 38.99,17.71 38.99,16.64 ; 5.98,55.04 5.98,52.05 5.87,51.94 ; 5.98,55.04 5.96,55.06 5.96,56.44 6.03,56.52 ; 5.98,55.04 6.03,55.1 ; 48.52,8.27 48.52,3.68 48.52,6.94 ; 38.99,16.64 38.86,16.51 38.61,16.51 38.49,16.62 38.49,17.71 ; 38.99,16.64 38.99,14.99 38.16,14.16 38.16,13.33 ; 12.83,28.65 15.16,30.99 21.71,30.99 ; 4.38,14.7 4.38,16.02 ; 39.31,40.77 39.49,40.58 39.49,37.03 ; 36.26,47.8 35.6,47.8 ; 36.26,47.8 36.92,47.8 ; 36.26,47.8 36.26,47.11 ; 36.26,49.12 36.92,49.12 ; 36.26,49.12 35.6,49.12 ; 36.26,49.12 36.26,49.81 ; 38.16,13.33 38.16,12.63 ; 38.16,13.33 38.16,14.04 ; 33.15,49.07 33.18,49.11 33.18,49.12 ; 13.49,41.54 13.49,43.56 14.15,44.22 ; 8.3,17.65 7.02,17.65 ; 8.3,17.65 8.3,17.09 ; 8.3,17.65 9.59,17.65 ; 2.78,19.79 2.11,19.79 ; 2.78,19.79 2.78,19.1 ; 2.78,19.79 2.78,20.48 ; 7.38,55.04 7.38,54.33 ; 7.38,55.04 8.04,55.04 ; 7.38,55.04 7.38,55.75 ; 21.34,26.54 17.6,26.54 ; 19.84,41.54 20.4,41.54 ; 19.84,41.54 19.84,43.76 ; 19.84,41.54 19.84,43.3 ; 37.88,40.79 37.88,40.08 ; 37.88,40.79 37.88,41.5 ; 37.88,40.79 37.22,40.79 ; 21.71,30.99 21.71,34.16 ; 21.71,30.99 22.81,30.99 23.6,30.2 ; 23.11,34.16 23.11,33.45 ; 23.11,34.16 23.76,34.16 ; 23.11,34.16 23.11,34.87 ; 2.02,8.27 2.02,3.68 ; 39.56,13.33 39.49,13.4 39.49,17.71 ; 12.22,41.54 12.22,44.14 ; 33.17,47.8 33.18,47.8
  Top Layer w0.305: 39.56,13.33 39.56,10.3 39.6,10.26 ; 46.94,25.93 46.91,25.91 44.73,25.91 ; 11.12,56.52 3.1,56.52 0.99,54.41 0.99,38.48 ; 17.6,34.16 21.71,34.16 ; 39.34,40.77 39.31,40.77 39.28,40.79
  Top Layer w0.35: 3.52,8.27 3.52,3.68 ; 24.52,8.27 24.52,3.68 ; 44.02,8.27 44.02,3.68 ; 45.52,8.27 45.52,3.68 ; 20.02,8.27 20.02,3.68 ; 26.02,8.27 26.02,3.68 ; 35.02,8.27 35.02,3.68 ; 9.52,8.27 9.52,3.68 ; 11.02,8.27 11.02,3.68 ; 39.52,8.27 39.52,3.68 ; 41.02,8.27 41.02,3.68 ; 12.52,8.27 12.52,3.68 ; 36.52,8.27 36.52,3.68 ; 32.02,8.27 32.02,3.68 ; 18.52,8.27 18.52,3.68 ; 23.02,8.27 23.02,3.68 ; 6.52,8.27 6.52,3.68 ; 29.02,8.27 29.02,3.68 ; 33.52,8.27 33.52,3.68 ; 27.52,8.27 27.52,3.68 ; 42.52,8.27 42.52,3.68 ; 30.52,8.27 30.52,3.68 ; 38.02,8.27 38.02,3.68 ; 47.02,8.27 47.02,3.68 ; 15.52,8.27 15.52,3.68 ; 5.02,8.27 5.02,3.68 ; 17.02,8.27 17.02,3.68 ; 21.52,8.27 21.52,3.68 ; 8.02,8.27 8.02,3.68
  Top Layer w0.351: 14.2,3.27 14.45,3.52 14.45,3.86 14.02,4.29 14.02,8.27
  Bottom Layer w0.152: 31.17,11.43 12.69,11.43 ; 31.17,11.43 12.69,11.43 ; 31.17,11.43 31.75,12.01 31.17,11.43 ; 12.69,11.43 9.52,8.27 12.69,11.43 ; 1.93,49.58 3.61,51.26 ; 1.93,49.58 3.61,51.26 ; 1.93,49.58 1.93,38.23 ; 1.93,49.58 1.93,38.23 ; 3.61,51.26 22.3,51.26 3.61,51.26 ; 31.78,10.79 13.55,10.79 ; 31.78,10.79 13.55,10.79 ; 31.78,10.79 32.23,11.25 31.78,10.79 ; 13.55,10.79 11.02,8.27 13.55,10.79 ; 16.28,12.57 20.55,16.84 16.28,12.57 ; 16.28,12.57 10.21,12.57 ; 16.28,12.57 10.21,12.57 ; 13.31,31.18 13.31,22.3 ; 13.31,31.18 14.43,32.3 ; 13.31,31.18 14.43,32.3 ; 13.31,31.18 13.31,22.3 ; 13.31,22.3 4.22,13.21 ; 13.31,22.3 4.22,13.21 ; 16.03,55.93 15.49,55.4 16.03,55.93 ; 16.03,55.93 35.64,55.93 16.03,55.93 ; 23.98,50.7 31.17,50.7 23.98,50.7 ; 23.98,50.7 23.42,50.14 23.98,50.7 ; 6.5,12.8 6.5,12.78 6.5,12.8 ; 6.5,12.8 20.24,26.54 ; 6.5,12.8 20.24,26.54 ; 21.34,17.65 23.24,19.56 ; 21.34,17.65 23.24,19.56 ; 21.34,17.65 19.3,17.65 21.34,17.65 ; 23.24,19.56 37.92,19.56 ; 23.24,19.56 37.92,19.56 ; 21.34,26.54 20.24,26.54 ; 21.34,26.54 21.34,24.44 ; 21.34,26.54 20.24,26.54 ; 21.34,26.54 21.34,24.44 ; 32.69,42.16 34.72,40.13 ; 32.69,42.16 22.55,42.16 ; 32.69,42.16 34.72,40.13 ; 32.69,42.16 22.55,42.16 ; 34.72,40.13 34.72,39.57 ; 34.72,40.13 34.72,39.57 ; 8.41,42.88 8.41,48.08 8.41,42.88 ; 8.41,42.88 12.47,38.81 ; 8.41,42.88 12.47,38.81 ; 7.26,31.98 12.37,31.98 ; 7.26,31.98 5.51,30.23 7.26,31.98 ; 7.26,31.98 12.37,31.98 ; 12.37,31.98 22.55,42.16 ; 12.37,31.98 22.55,42.16 ; 34.72,39.57 35,39.29 34.72,39.57 ; 27.36,24.69 26.69,25.35 ; 27.36,24.69 26.69,25.35 ; 27.36,24.69 28.19,24.69 27.36,24.69 ; 26.69,25.35 26.69,31.22 ; 26.69,25.35 26.69,31.22 ; 21.56,42.77 11.71,32.92 21.56,42.77 ; 21.56,42.77 33.19,42.77 ; 21.56,42.77 33.19,42.77 ; 11.43,38.61 10.95,39.09 11.43,38.61 ; 11.43,38.61 11.43,34.34 11.43,38.61 ; 4.22,13.21 4.22,7.19 ; 4.22,13.21 4.22,7.19 ; 4.22,7.19 4.72,6.68 ; 4.22,7.19 4.72,6.68 ; 6.15,32.28 12.24,32.28 ; 6.15,32.28 5.51,31.65 6.15,32.28 ; 6.15,32.28 12.24,32.28 ; 12.24,32.28 22.43,42.47 ; 12.24,32.28 22.43,42.47 ; 22.68,41.86 12.5,31.67 ; 22.68,41.86 12.5,31.67 ; 22.68,41.86 32.49,41.86 ; 22.68,41.86 32.49,41.86 ; 12.5,31.67 7.7,31.67 ; 12.5,31.67 7.7,31.67 ; 14.43,32.3 14.43,32.56 14.43,32.3 ; 15.65,32.79 15.7,32.84 15.65,32.79 ; 15.65,32.79 15.65,22.91 ; 15.65,32.79 15.65,22.91 ; 44.83,47.8 34.75,47.8 44.83,47.8 ; 44.83,47.8 45.97,46.66 44.83,47.8 ; 20.07,21.08 19.56,20.57 20.07,21.08 ; 20.07,21.08 38.48,21.08 20.07,21.08 ; 24.61,33.3 24.59,33.3 ; 24.61,33.3 26.69,31.22 ; 24.61,33.3 24.59,33.3 ; 24.61,33.3 26.69,31.22 ; 24.59,33.3 24.59,35.51 24.59,33.3 ; 4.72,6.68 28.94,6.68 ; 4.72,6.68 28.94,6.68 ; 28.94,6.68 30.52,8.27 28.94,6.68 ; 40,23.11 19.56,23.11 40,23.11 ; 40,23.11 40.13,22.99 40,23.11 ; 37.52,31.78 37.47,31.72 37.52,31.78 ; 37.52,31.78 37.52,38.15 37.52,31.78 ; 34.19,40.16 34.19,39.42 34.19,40.16 ; 34.19,40.16 32.49,41.86 ; 34.19,40.16 32.49,41.86 ; 27.41,37.39 20.93,37.39 27.41,37.39 ; 27.41,37.39 37.44,27.36 27.41,37.39 ; 22.2,23.57 41.05,23.57 22.2,23.57 ; 22.2,23.57 21.34,24.44 ; 22.2,23.57 21.34,24.44 ; 6.1,48.31 6.96,49.17 ; 6.1,48.31 6.1,35.61 6.1,48.31 ; 6.1,48.31 6.96,49.17 ; 6.96,49.17 10.49,49.17 6.96,49.17 ; 32.36,10.16 14.41,10.16 ; 32.36,10.16 14.41,10.16 ; 32.36,10.16 32.77,10.57 32.36,10.16 ; 14.41,10.16 12.52,8.27 14.41,10.16 ; 15.65,22.91 5.72,12.98 ; 15.65,22.91 5.72,12.98 ; 42.57,34.82 38.79,34.82 42.57,34.82 ; 42.57,34.82 45.52,31.87 ; 42.57,34.82 45.52,31.87 ; 7.16,12.04 5,12.04 7.16,12.04 ; 7.16,12.04 15.54,20.42 7.16,12.04 ; 40,31.37 38.61,29.97 40,31.37 ; 40,31.37 40,33.91 40,31.37 ; 8.53,9.65 4.88,9.65 8.53,9.65 ; 8.53,9.65 9.02,10.13 ; 8.53,9.65 9.02,10.13 ; 18.06,54.81 38.41,54.81 18.06,54.81 ; 18.06,54.81 17.78,54.53 18.06,54.81 ; 9.02,11.38 9.02,10.13 ; 9.02,11.38 10.21,12.57 ; 9.02,11.38 10.21,12.57 ; 9.02,11.38 9.02,10.13 ; 27.84,38.1 38.74,27.2 27.84,38.1 ; 27.84,38.1 22.53,38.1 27.84,38.1 ; 13.56,53.62 36.22,53.62 13.56,53.62 ; 13.56,53.62 12.19,52.25 13.56,53.62 ; 45.52,31.87 45.52,8.27 45.52,31.87 ; 32.77,9.53 32.89,9.65 32.77,9.53 ; 32.77,9.53 15.28,9.53 ; 32.77,9.53 15.28,9.53 ; 14.71,31.09 14.53,31.27 14.71,31.09 ; 14.71,31.09 14.71,24.05 14.71,31.09 ; 26.75,36.81 36.98,26.57 26.75,36.81 ; 26.75,36.81 23.04,36.81 26.75,36.81 ; 1.93,38.23 5.79,34.37 1.93,38.23 ; 28.32,32.89 25.73,35.48 28.32,32.89 ; 28.32,32.89 28.32,26.97 28.32,32.89 ; 33.19,42.77 35.97,40 ; 33.19,42.77 35.97,40 ; 5.72,12.98 5.72,12.78 5.72,12.98 ; 35.97,40 35.97,39.52 35.97,40 ; 19.69,21.97 19.43,21.72 19.69,21.97 ; 19.69,21.97 39.37,21.97 19.69,21.97 ; 5.51,29.49 7.7,31.67 ; 5.51,29.49 7.7,31.67 ; 5.51,29.49 5.51,28.83 5.51,29.49 ; 19,54.33 18.92,54.25 19,54.33 ; 19,54.33 39.7,54.33 19,54.33 ; 32.82,42.47 35.28,40 32.82,42.47 ; 32.82,42.47 22.43,42.47 ; 32.82,42.47 22.43,42.47 ; 39.57,43.08 40.51,42.14 39.57,43.08 ; 39.57,43.08 20.98,43.08 ; 39.57,43.08 20.98,43.08 ; 19.86,38.08 20.75,38.96 ; 19.86,38.08 19.86,32.11 19.86,38.08 ; 19.86,38.08 20.75,38.96 ; 20.75,38.96 28.12,38.96 20.75,38.96 ; 26.03,36.19 21.49,36.19 26.03,36.19 ; 26.03,36.19 36.17,26.06 ; 26.03,36.19 36.17,26.06 ; 20.98,43.08 10.87,32.97 20.98,43.08 ; 36.17,26.06 36.17,26.01 36.17,26.06 ; 29.16,43.76 25.73,47.19 29.16,43.76 ; 29.16,43.76 29.16,43.74 29.16,43.76 ; 12.47,38.81 12.47,35.61 12.47,38.81 ; 15.28,9.53 14.02,8.27 15.28,9.53 ; 37.92,19.56 37.97,19.51 37.92,19.56 ; 17.42,55.37 37.08,55.37 17.42,55.37 ; 17.42,55.37 16.92,54.86 17.42,55.37 ; 20.57,20.32 39.12,20.32 20.57,20.32 ; 20.57,20.32 19.18,18.92 20.57,20.32 ; 14.07,25.65 14.07,23.04 14.07,25.65 ; 34.77,49.12 44.55,49.12 34.77,49.12
  Bottom Layer w0.203: 25.18,35.21 25.33,35.02 ; 25.18,35.21 25.33,35.02 ; 25.18,35.21 25.18,35.21 ; 25.18,35.21 25.18,35.21 ; 25.33,35.02 25.53,34.91 ; 25.33,35.02 25.53,34.91 ; 26.9,19.12 37.44,19.12 ; 26.9,19.12 37.44,19.12 ; 26.9,19.12 27.97,18.36 ; 26.9,19.12 27.97,18.36 ; 37.44,19.12 37.55,19.07 ; 37.44,19.12 37.55,19.07 ; 29.01,7.37 4.65,7.37 ; 29.01,7.37 29.91,8.27 ; 29.01,7.37 4.65,7.37 ; 29.01,7.37 29.91,8.27 ; 4.65,7.37 4.65,7.37 ; 4.65,7.37 4.65,7.37 ; 38.38,26.7 38.6,26.61 ; 38.38,26.7 38.22,26.87 ; 38.38,26.7 38.22,26.87 ; 38.38,26.7 38.6,26.61 ; 38.6,26.61 38.74,26.59 ; 38.6,26.61 38.74,26.59 ; 41.07,22.76 41.07,11.51 ; 41.07,22.76 41.07,22.77 ; 41.07,22.76 41.07,22.77 ; 41.07,22.76 41.07,11.51 ; 41.07,11.51 40.33,10.77 ; 41.07,11.51 40.33,10.77 ; 23.91,8.27 23.96,8.03 ; 23.91,8.27 23.96,8.5 ; 23.91,8.27 23.96,8.5 ; 23.91,8.27 23.96,8.03 ; 23.96,8.03 24.09,7.84 ; 23.96,8.03 24.09,7.84 ; 29.67,25 29.45,24.85 ; 29.67,25 29.45,24.85 ; 29.67,25 29.92,25.05 ; 29.67,25 29.92,25.05 ; 29.45,24.85 29.31,24.64 ; 29.45,24.85 29.31,24.64 ; 17.59,8.03 17.63,8.27 ; 17.59,8.03 17.46,7.84 ; 17.59,8.03 17.46,7.84 ; 17.59,8.03 17.63,8.27 ; 17.63,8.27 17.59,8.5 ; 17.63,8.27 17.59,8.5 ; 20.94,24.27 21.03,24.13 ; 20.94,24.27 20.9,24.44 ; 20.94,24.27 20.9,24.44 ; 20.94,24.27 21.03,24.13 ; 21.03,24.13 21.61,23.55 ; 21.03,24.13 21.61,23.55 ; 25.13,8.27 25.09,8.5 ; 25.13,8.27 25.09,8.03 ; 25.13,8.27 25.09,8.5 ; 25.13,8.27 25.09,8.03 ; 25.09,8.5 24.96,8.7 ; 25.09,8.5 24.96,8.7 ; 20.08,26.94 19.94,26.85 ; 20.08,26.94 20.24,26.98 ; 20.08,26.94 19.94,26.85 ; 20.08,26.94 20.24,26.98 ; 19.94,26.85 16.08,22.99 ; 19.94,26.85 16.08,22.99 ; 23.85,30.81 23.6,30.86 ; 23.85,30.81 24.07,30.67 ; 23.85,30.81 24.07,30.67 ; 23.85,30.81 23.6,30.86 ; 23.6,30.86 23.34,30.81 ; 23.6,30.86 23.34,30.81 ; 42.29,7.7 42.52,7.66 ; 42.29,7.7 42.09,7.84 ; 42.29,7.7 42.52,7.66 ; 42.29,7.7 42.09,7.84 ; 42.52,7.66 42.76,7.7 ; 42.52,7.66 42.76,7.7 ; 16.48,54.43 16.68,54.3 ; 16.48,54.43 16.68,54.3 ; 16.48,54.43 16.35,54.63 ; 16.48,54.43 16.35,54.63 ; 16.68,54.3 16.92,54.25 ; 16.68,54.3 16.92,54.25 ; 39.6,22.54 39.37,22.58 ; 39.6,22.54 39.8,22.4 ; 39.6,22.54 39.8,22.4 ; 39.6,22.54 39.37,22.58 ; 39.37,22.58 39.14,22.54 ; 39.37,22.58 39.14,22.54 ; 15.14,31.09 15.13,31.17 ; 15.14,31.09 15.14,24.48 ; 15.14,31.09 15.13,31.17 ; 15.14,31.09 15.14,24.48 ; 15.13,31.17 15.14,31.27 ; 15.13,31.17 15.14,31.27 ; 32.37,24.75 32.13,24.79 ; 32.37,24.75 32.56,24.61 ; 32.37,24.75 32.13,24.79 ; 32.37,24.75 32.56,24.61 ; 32.13,24.79 31.9,24.75 ; 32.13,24.79 31.9,24.75 ; 5.13,9.04 5.35,9.18 ; 5.13,9.04 4.88,8.99 ; 5.13,9.04 4.88,8.99 ; 5.13,9.04 5.35,9.18 ; 5.35,9.18 5.38,9.22 ; 5.35,9.18 5.38,9.22 ; 39.52,8.88 39.29,8.83 ; 39.52,8.88 39.76,8.83 ; 39.52,8.88 39.76,8.83 ; 39.52,8.88 39.29,8.83 ; 39.29,8.83 39.09,8.7 ; 39.29,8.83 39.09,8.7 ; 4.9,31.65 4.95,31.41 ; 4.9,31.65 4.91,31.78 ; 4.9,31.65 4.91,31.78 ; 4.9,31.65 4.95,31.41 ; 4.95,31.41 5.08,31.22 ; 4.95,31.41 5.08,31.22 ; 5.26,13.19 5.14,12.98 ; 5.26,13.19 5.45,13.33 ; 5.26,13.19 5.14,12.98 ; 5.26,13.19 5.45,13.33 ; 5.14,12.98 5.1,12.78 ; 5.14,12.98 5.1,12.78 ; 23.81,51.1 23.67,51.01 ; 23.81,51.1 23.98,51.13 ; 23.81,51.1 23.98,51.13 ; 23.81,51.1 23.67,51.01 ; 23.67,51.01 23.67,51.01 ; 23.67,51.01 23.67,51.01 ; 33.46,9.42 33.5,9.65 ; 33.46,9.42 33.5,9.65 ; 33.46,9.42 33.33,9.22 ; 33.46,9.42 33.33,9.22 ; 33.5,9.65 33.46,9.89 ; 33.5,9.65 33.46,9.89 ; 6.52,7.66 6.76,7.7 ; 6.52,7.66 6.76,7.7 ; 6.52,7.66 6.29,7.7 ; 6.52,7.66 6.29,7.7 ; 6.76,7.7 6.96,7.84 ; 6.76,7.7 6.96,7.84 ; 19.56,23.73 19.32,23.68 ; 19.56,23.73 19.69,23.71 ; 19.56,23.73 19.32,23.68 ; 19.56,23.73 19.69,23.71 ; 19.32,23.68 19.12,23.55 ; 19.32,23.68 19.12,23.55 ; 50.31,8.61 49.78,8.61 ; 50.31,8.61 50.31,58.04 ; 50.31,8.61 50.31,58.04 ; 50.31,8.61 49.78,8.61 ; 49.78,8.61 49.65,8.59 ; 49.78,8.61 49.65,8.59 ; 0.36,9.25 0.36,17.66 ; 0.36,9.25 0.76,9.25 ; 0.36,9.25 0.36,17.66 ; 0.36,9.25 0.76,9.25 ; 0.36,17.66 0.48,17.43 ; 0.36,17.66 0.48,17.43 ; 38.5,30.58 38.28,30.49 ; 38.5,30.58 38.28,30.49 ; 38.5,30.58 38.66,30.64 ; 38.5,30.58 38.66,30.64 ; 38.28,30.49 38.11,30.32 ; 38.28,30.49 38.11,30.32 ; 15.93,33.41 15.7,33.45 ; 15.93,33.41 15.7,33.45 ; 15.93,33.41 16.13,33.27 ; 15.93,33.41 16.13,33.27 ; 15.7,33.45 15.46,33.41 ; 15.7,33.45 15.46,33.41 ; 43.09,8.5 42.96,8.7 ; 43.09,8.5 43.13,8.27 ; 43.09,8.5 43.13,8.27 ; 43.09,8.5 42.96,8.7 ; 42.96,8.7 42.76,8.83 ; 42.96,8.7 42.76,8.83 ; 12.02,8.62 11.93,8.4 ; 12.02,8.62 12.19,8.78 ; 12.02,8.62 12.19,8.78 ; 12.02,8.62 11.93,8.4 ; 11.93,8.4 11.91,8.27 ; 11.93,8.4 11.91,8.27 ; 10.51,38.66 10.71,38.53 ; 10.51,38.66 10.38,38.86 ; 10.51,38.66 10.38,38.86 ; 10.51,38.66 10.71,38.53 ; 10.71,38.53 10.94,38.48 ; 10.71,38.53 10.94,38.48 ; 27.1,31.38 27,31.52 ; 27.1,31.38 27,31.52 ; 27.1,31.38 27.13,31.22 ; 27.1,31.38 27.13,31.22 ; 27,31.52 25.02,33.5 ; 27,31.52 25.02,33.5 ; 39.35,27.2 39.3,27.44 ; 39.35,27.2 39.3,26.97 ; 39.35,27.2 39.3,26.97 ; 39.35,27.2 39.3,27.44 ; 39.3,27.44 39.17,27.64 ; 39.3,27.44 39.17,27.64 ; 1.02,9.14 0.9,9.22 ; 1.02,9.14 1.09,9.03 ; 1.02,9.14 0.9,9.22 ; 1.02,9.14 1.09,9.03 ; 0.9,9.22 0.76,9.25 ; 0.9,9.22 0.76,9.25 ; 2.54,8.59 2.52,8.74 ; 2.54,8.59 2.59,8.5 ; 2.54,8.59 2.52,8.74 ; 2.54,8.59 2.59,8.5 ; 2.52,8.74 2.52,10.01 ; 2.52,8.74 2.52,10.01 ; 37.94,14.86 37.79,14.78 ; 37.94,14.86 38.08,15 ; 37.94,14.86 37.79,14.78 ; 37.94,14.86 38.08,15 ; 37.79,14.78 37.57,14.78 ; 37.79,14.78 37.57,14.78 ; 39.94,21.74 39.98,21.97 ; 39.94,21.74 39.98,21.97 ; 39.94,21.74 39.8,21.54 ; 39.94,21.74 39.8,21.54 ; 39.98,21.97 39.94,22.2 ; 39.98,21.97 39.94,22.2 ; 23.11,24.99 22.97,24.77 ; 23.11,24.99 23.11,29.75 ; 23.11,24.99 22.97,24.77 ; 23.11,24.99 23.11,29.75 ; 22.97,24.77 22.93,24.54 ; 22.97,24.77 22.93,24.54 ; 41.91,8.27 41.96,8.03 ; 41.91,8.27 41.96,8.03 ; 41.91,8.27 41.96,8.5 ; 41.91,8.27 41.96,8.5 ; 41.96,8.03 42.09,7.84 ; 41.96,8.03 42.09,7.84 ; 14.63,8.16 14.69,8.32 ; 14.63,8.16 14.59,8.03 ; 14.63,8.16 14.69,8.32 ; 14.63,8.16 14.59,8.03 ; 14.69,8.32 15.46,9.09 ; 14.69,8.32 15.46,9.09 ; 13.86,32.34 13,31.49 ; 13.86,32.34 13.84,32.4 ; 13.86,32.34 13,31.49 ; 13.86,32.34 13.84,32.4 ; 13,31.49 12.91,31.34 ; 13,31.49 12.91,31.34 ; 42.96,7.84 43.09,8.03 ; 42.96,7.84 42.76,7.7 ; 42.96,7.84 42.76,7.7 ; 42.96,7.84 43.09,8.03 ; 43.09,8.03 43.13,8.27 ; 43.09,8.03 43.13,8.27 ; 35.24,38.73 35.43,38.86 ; 35.24,38.73 35,38.68 ; 35.24,38.73 35.43,38.86 ; 35.24,38.73 35,38.68 ; 35.43,38.86 35.57,39.06 ; 35.43,38.86 35.57,39.06 ; 18.94,18.36 19.18,18.31 ; 18.94,18.36 19.18,18.31 ; 18.94,18.36 18.74,18.49 ; 18.94,18.36 18.74,18.49 ; 19.18,18.31 19.41,18.36 ; 19.18,18.31 19.41,18.36 ; 13.62,21.99 13.71,22.14 ; 13.62,21.99 13.71,22.14 ; 13.62,21.99 4.65,13.03 ; 13.62,21.99 4.65,13.03 ; 13.71,22.14 13.74,22.3 ; 13.71,22.14 13.74,22.3 ; 40.31,54.33 40.31,54.33 ; 40.31,54.33 40.31,54.33 ; 40.31,54.33 40.27,54.1 ; 40.31,54.33 40.27,54.1 ; 40.31,54.33 40.27,54.56 ; 40.31,54.33 40.27,54.56 ; 30.57,24.24 30.58,24.38 ; 30.57,24.24 30.47,24.01 ; 30.57,24.24 30.58,24.38 ; 30.57,24.24 30.47,24.01 ; 30.58,24.38 30.53,24.64 ; 30.58,24.38 30.53,24.64 ; 38.02,8.88 37.79,8.83 ; 38.02,8.88 38.26,8.83 ; 38.02,8.88 37.79,8.83 ; 38.02,8.88 38.26,8.83 ; 37.79,8.83 37.59,8.7 ; 37.79,8.83 37.59,8.7 ; 14.96,31.7 14.76,31.83 ; 14.96,31.7 15.09,31.5 ; 14.96,31.7 15.09,31.5 ; 14.96,31.7 14.76,31.83 ; 14.76,31.83 14.62,31.87 ; 14.76,31.83 14.62,31.87 ; 10.56,56.28 10.69,56.08 ; 10.56,56.28 10.51,56.52 ; 10.56,56.28 10.69,56.08 ; 10.56,56.28 10.51,56.52 ; 10.69,56.08 10.89,55.95 ; 10.69,56.08 10.89,55.95 ; 32.74,24.18 32.7,24.42 ; 32.74,24.18 32.72,24.01 ; 32.74,24.18 32.7,24.42 ; 32.74,24.18 32.72,24.01 ; 32.7,24.42 32.56,24.61 ; 32.7,24.42 32.56,24.61 ; 32.8,47.32 33.01,47.21 ; 32.8,47.32 26.38,47.32 ; 32.8,47.32 33.01,47.21 ; 32.8,47.32 26.38,47.32 ; 33.01,47.21 33.17,47.19 ; 33.01,47.21 33.17,47.19 ; 16.59,12.27 20.5,16.18 ; 16.59,12.27 16.45,12.17 ; 16.59,12.27 16.45,12.17 ; 16.59,12.27 20.5,16.18 ; 20.5,16.18 20.55,16.18 ; 20.5,16.18 20.55,16.18 ; 30.87,50.11 31.12,50.04 ; 30.87,50.11 30.66,50.26 ; 30.87,50.11 31.12,50.04 ; 30.87,50.11 30.66,50.26 ; 31.12,50.04 31.17,50.03 ; 31.12,50.04 31.17,50.03 ; 14.73,31.99 14.8,32.08 ; 14.73,31.99 14.62,31.87 ; 14.73,31.99 14.62,31.87 ; 14.73,31.99 14.8,32.08 ; 14.8,32.08 14.96,32.26 ; 14.8,32.08 14.96,32.26 ; 5.91,8.27 5.96,8.03 ; 5.91,8.27 5.96,8.5 ; 5.91,8.27 5.96,8.03 ; 5.91,8.27 5.96,8.5 ; 5.96,8.03 6.09,7.84 ; 5.96,8.03 6.09,7.84 ; 40.33,10.77 40.06,10.77 ; 40.33,10.77 40.06,10.77 ; 40.06,10.77 39.9,10.79 ; 40.06,10.77 39.9,10.79 ; 33.33,10.8 33.2,11 ; 33.33,10.8 33.38,10.57 ; 33.33,10.8 33.38,10.57 ; 33.33,10.8 33.2,11 ; 33.2,11 33,11.13 ; 33.2,11 33,11.13 ; 28.63,25.12 28.43,25.25 ; 28.63,25.12 28.43,25.25 ; 28.63,25.12 28.76,24.92 ; 28.63,25.12 28.76,24.92 ; 28.43,25.25 28.19,25.3 ; 28.43,25.25 28.19,25.3 ; 23.96,8.5 24.09,8.7 ; 23.96,8.5 24.09,8.7 ; 38.16,15.37 37.28,15.37 ; 38.16,15.37 37.28,15.37 ; 38.16,15.37 38.16,15.22 ; 38.16,15.37 38.08,15.59 ; 38.16,15.37 38.16,15.22 ; 38.16,15.37 38.08,15.59 ; 37.28,15.37 37.28,15.52 ; 37.28,15.37 37.28,15.52 ; 31.78,50.44 31.83,50.7 ; 31.78,50.44 31.83,50.7 ; 31.78,50.44 31.63,50.23 ; 31.78,50.44 31.63,50.23 ; 31.83,50.7 31.78,50.95 ; 31.83,50.7 31.78,50.95 ; 11.76,52.68 11.63,52.48 ; 11.76,52.68 11.96,52.81 ; 11.76,52.68 11.63,52.48 ; 11.76,52.68 11.96,52.81 ; 11.63,52.48 11.58,52.25 ; 11.63,52.48 11.58,52.25 ; 5.59,8.5 5.46,8.7 ; 5.59,8.5 5.46,8.7 ; 5.59,8.5 5.64,8.27 ; 5.59,8.5 5.64,8.27 ; 5.46,8.7 5.26,8.83 ; 5.46,8.7 5.26,8.83 ; 38.97,27.77 38.84,27.81 ; 38.97,27.77 39.17,27.64 ; 38.97,27.77 39.17,27.64 ; 38.97,27.77 38.84,27.81 ; 38.84,27.81 38.68,27.87 ; 38.84,27.81 38.68,27.87 ; 16.35,55.1 16.3,54.86 ; 16.35,55.1 16.3,54.86 ; 16.35,55.1 16.48,55.3 ; 16.35,55.1 16.48,55.3 ; 16.3,54.86 16.35,54.63 ; 16.3,54.86 16.35,54.63 ; 40.66,56.99 40.46,57.03 ; 40.66,56.99 40.82,56.88 ; 40.66,56.99 40.46,57.03 ; 40.66,56.99 40.82,56.88 ; 40.46,57.03 11.46,57.03 ; 40.46,57.03 11.46,57.03 ; 28.32,26.36 28.56,26.41 ; 28.32,26.36 28.09,26.41 ; 28.32,26.36 28.09,26.41 ; 28.32,26.36 28.56,26.41 ; 28.56,26.41 28.75,26.54 ; 28.56,26.41 28.75,26.54 ; 39.36,9.7 39.6,9.65 ; 39.36,9.7 39.16,9.83 ; 39.36,9.7 39.16,9.83 ; 39.36,9.7 39.6,9.65 ; 39.6,9.65 39.6,9.65 ; 39.6,9.65 39.6,9.65 ; 29.33,26.21 29.48,26 ; 29.33,26.21 29.48,26 ; 29.33,26.21 29.28,26.47 ; 29.33,26.21 29.28,26.47 ; 29.48,26 29.69,25.85 ; 29.48,26 29.69,25.85 ; 44.98,48.69 45.12,48.89 ; 44.98,48.69 45.12,48.89 ; 44.98,48.69 44.79,48.56 ; 44.98,48.69 44.79,48.56 ; 45.12,48.89 45.16,49.12 ; 45.12,48.89 45.16,49.12 ; 1.59,7.84 1.79,7.7 ; 1.59,7.84 1.46,8.03 ; 1.59,7.84 1.79,7.7 ; 1.59,7.84 1.46,8.03 ; 1.79,7.7 2.02,7.66 ; 1.79,7.7 2.02,7.66 ; 45.83,32.18 42.88,35.13 ; 45.83,32.18 45.92,32.04 ; 45.83,32.18 45.92,32.04 ; 45.83,32.18 42.88,35.13 ; 42.88,35.13 42.74,35.22 ; 42.88,35.13 42.74,35.22 ; 14.71,23.44 14.94,23.49 ; 14.71,23.44 14.54,23.47 ; 14.71,23.44 14.54,23.47 ; 14.71,23.44 14.94,23.49 ; 14.94,23.49 15.14,23.62 ; 14.94,23.49 15.14,23.62 ; 1.09,9.03 1.12,8.89 ; 1.09,9.03 1.12,8.89 ; 8.17,48.65 7.97,48.51 ; 8.17,48.65 8.41,48.69 ; 8.17,48.65 7.97,48.51 ; 8.17,48.65 8.41,48.69 ; 7.97,48.51 7.84,48.32 ; 7.97,48.51 7.84,48.32 ; 34.98,48.37 34.75,48.42 ; 34.98,48.37 35.18,48.24 ; 34.98,48.37 35.18,48.24 ; 34.98,48.37 34.75,48.42 ; 34.75,48.42 34.51,48.37 ; 34.75,48.42 34.51,48.37 ; 40.34,14.17 40.34,16.71 ; 40.34,14.17 40.34,16.71 ; 40.34,14.17 40.31,14.04 ; 40.34,14.17 40.31,14.04 ; 40.34,16.71 40.31,16.85 ; 40.34,16.71 40.31,16.85 ; 8.97,47.85 9.02,48.08 ; 8.97,47.85 9.02,48.08 ; 8.97,47.85 8.84,47.65 ; 8.97,47.85 8.84,47.65 ; 9.02,48.08 8.97,48.32 ; 9.02,48.08 8.97,48.32 ; 12.26,28.42 12.32,28.31 ; 12.26,28.42 12.32,28.31 ; 12.26,28.42 12.22,28.65 ; 12.26,28.42 12.22,28.65 ; 12.32,28.31 12.32,23.2 ; 12.32,28.31 12.32,23.2 ; 25.59,8.7 25.46,8.5 ; 25.59,8.7 25.46,8.5 ; 25.59,8.7 25.79,8.83 ; 25.59,8.7 25.79,8.83 ; 25.46,8.5 25.41,8.27 ; 25.46,8.5 25.41,8.27 ; 21.09,7.84 21.29,7.7 ; 21.09,7.84 20.96,8.03 ; 21.09,7.84 20.96,8.03 ; 21.09,7.84 21.29,7.7 ; 21.29,7.7 21.52,7.66 ; 21.29,7.7 21.52,7.66 ; 12.14,44.75 11.91,44.68 ; 12.14,44.75 11.91,44.68 ; 12.14,44.75 16.8,49.42 ; 12.14,44.75 16.8,49.42 ; 11.91,44.68 11.73,44.52 ; 11.91,44.68 11.73,44.52 ; 14.96,32.26 15.03,32.49 ; 14.96,32.26 15.03,32.49 ; 18.69,17.65 18.74,17.42 ; 18.69,17.65 18.74,17.89 ; 18.69,17.65 18.74,17.89 ; 18.69,17.65 18.74,17.42 ; 18.74,17.42 18.87,17.22 ; 18.74,17.42 18.87,17.22 ; 5.96,8.5 6.09,8.7 ; 5.96,8.5 6.09,8.7 ; 1.41,8.31 1.41,8.27 ; 1.41,8.31 1.48,8.54 ; 1.41,8.31 1.41,8.27 ; 1.41,8.31 1.48,8.54 ; 1.41,8.27 1.46,8.03 ; 1.41,8.27 1.46,8.03 ; 11.63,8.16 11.69,8.32 ; 11.63,8.16 11.59,8.03 ; 11.63,8.16 11.59,8.03 ; 11.63,8.16 11.69,8.32 ; 11.69,8.32 13.73,10.36 ; 11.69,8.32 13.73,10.36 ; 39.83,9.7 39.9,9.73 ; 39.83,9.7 39.6,9.65 ; 39.83,9.7 39.6,9.65 ; 39.83,9.7 39.9,9.73 ; 39.9,9.73 40.06,9.75 ; 39.9,9.73 40.06,9.75 ; 24.76,8.83 24.52,8.88 ; 24.76,8.83 24.96,8.7 ; 24.76,8.83 24.96,8.7 ; 24.76,8.83 24.52,8.88 ; 24.52,8.88 24.29,8.83 ; 24.52,8.88 24.29,8.83 ; 11.06,49.41 10.92,49.61 ; 11.06,49.41 11.1,49.17 ; 11.06,49.41 11.1,49.17 ; 11.06,49.41 10.92,49.61 ; 10.92,49.61 10.72,49.74 ; 10.92,49.61 10.72,49.74 ; 46.02,58.26 46.1,58.15 ; 46.02,58.26 46.1,58.15 ; 46.02,58.26 46,58.4 ; 46.02,58.26 46,58.4 ; 46.1,58.15 46.22,58.07 ; 46.1,58.15 46.22,58.07 ; 13.72,43.79 13.91,43.66 ; 13.72,43.79 13.58,43.99 ; 13.72,43.79 13.91,43.66 ; 13.72,43.79 13.58,43.99 ; 13.91,43.66 14.15,43.61 ; 13.91,43.66 14.15,43.61 ; 41.12,42.14 41.12,42.14 ; 41.12,42.14 41.08,41.9 ; 41.12,42.14 41.08,41.9 ; 41.12,42.14 41.12,42.14 ; 41.12,42.14 41.08,42.37 ; 41.12,42.14 41.08,42.37 ; 39.7,54.94 39.47,54.9 ; 39.7,54.94 39.93,54.9 ; 39.7,54.94 39.93,54.9 ; 39.7,54.94 39.47,54.9 ; 39.47,54.9 39.27,54.77 ; 39.47,54.9 39.27,54.77 ; 37.65,55.61 37.52,55.8 ; 37.65,55.61 37.7,55.37 ; 37.65,55.61 37.52,55.8 ; 37.65,55.61 37.7,55.37 ; 37.52,55.8 37.32,55.94 ; 37.52,55.8 37.32,55.94 ; 47.59,8.03 47.63,8.27 ; 47.59,8.03 47.63,8.27 ; 47.59,8.03 47.46,7.84 ; 47.59,8.03 47.46,7.84 ; 47.63,8.27 47.59,8.5 ; 47.63,8.27 47.59,8.5 ; 3.52,8.88 3.29,8.83 ; 3.52,8.88 3.55,8.88 ; 3.52,8.88 3.29,8.83 ; 3.52,8.88 3.55,8.88 ; 3.29,8.83 3.09,8.7 ; 3.29,8.83 3.09,8.7 ; 5.41,17.09 5.64,17.04 ; 5.41,17.09 5.21,17.22 ; 5.41,17.09 5.64,17.04 ; 5.41,17.09 5.21,17.22 ; 5.64,17.04 5.87,17.09 ; 5.64,17.04 5.87,17.09 ; 8.41,48.69 8.64,48.65 ; 8.41,48.69 8.64,48.65 ; 39.39,42.64 39.9,42.14 ; 39.39,42.64 33.94,42.64 ; 39.39,42.64 33.94,42.64 ; 39.39,42.64 39.9,42.14 ; 39.9,42.14 39.95,41.9 ; 39.9,42.14 39.95,41.9 ; 5.01,32 4.91,31.78 ; 5.01,32 5.18,32.16 ; 5.01,32 5.18,32.16 ; 5.01,32 4.91,31.78 ; 22.81,49.89 22.95,49.67 ; 22.81,49.89 22.76,50.14 ; 22.81,49.89 22.76,50.14 ; 22.81,49.89 22.95,49.67 ; 22.95,49.67 23.1,49.56 ; 22.95,49.67 23.1,49.56 ; 41.07,22.77 41.11,22.96 ; 41.07,22.77 41.11,22.96 ; 4.65,10.28 4.65,11.48 ; 4.65,10.28 4.65,11.48 ; 4.65,10.28 4.88,10.31 ; 4.65,10.28 4.88,10.31 ; 4.65,11.48 4.89,11.39 ; 4.65,11.48 4.89,11.39 ; 11.91,8.27 11.96,8.03 ; 11.91,8.27 11.96,8.03 ; 19.13,22.25 18.95,22.09 ; 19.13,22.25 18.95,22.09 ; 19.13,22.25 19.35,22.32 ; 19.13,22.25 19.35,22.32 ; 18.95,22.09 18.84,21.88 ; 18.95,22.09 18.84,21.88 ; 38.08,15 38.16,15.22 ; 38.08,15 38.16,15.22 ; 23.34,30.81 23.13,30.67 ; 23.34,30.81 23.13,30.67 ; 23.13,30.67 22.98,30.45 ; 23.13,30.67 22.98,30.45 ; 37.59,8.7 37.46,8.5 ; 37.59,8.7 37.46,8.5 ; 29.69,27.08 29.48,26.94 ; 29.69,27.08 29.95,27.13 ; 29.69,27.08 29.48,26.94 ; 29.69,27.08 29.95,27.13 ; 29.48,26.94 29.33,26.72 ; 29.48,26.94 29.33,26.72 ; 12.88,29.26 12.83,29.26 ; 12.88,29.26 12.83,29.26 ; 12.88,29.26 12.88,31.18 ; 12.88,29.26 12.88,31.18 ; 12.83,29.26 12.59,29.22 ; 12.83,29.26 12.59,29.22 ; 44.26,8.83 44.02,8.88 ; 44.26,8.83 44.02,8.88 ; 44.26,8.83 44.46,8.7 ; 44.26,8.83 44.46,8.7 ; 44.02,8.88 43.79,8.83 ; 44.02,8.88 43.79,8.83 ; 39.14,34.32 39.29,34.39 ; 39.14,34.32 39.29,34.39 ; 39.14,34.32 39.02,34.26 ; 39.14,34.32 39.02,34.26 ; 39.29,34.39 39.62,34.39 ; 39.29,34.39 39.62,34.39 ; 21.92,38.1 21.96,37.87 ; 21.92,38.1 21.96,38.33 ; 21.92,38.1 21.96,37.87 ; 21.92,38.1 21.96,38.33 ; 21.96,37.87 21.98,37.82 ; 21.96,37.87 21.98,37.82 ; 13.73,10.36 14,10.36 ; 13.73,10.36 14,10.36 ; 14,10.36 12.57,8.93 ; 14,10.36 12.57,8.93 ; 40.13,54.76 39.93,54.9 ; 40.13,54.76 39.93,54.9 ; 40.13,54.76 40.27,54.56 ; 40.13,54.76 40.27,54.56 ; 39.52,7.66 39.76,7.7 ; 39.52,7.66 39.29,7.7 ; 39.52,7.66 39.76,7.7 ; 39.52,7.66 39.29,7.7 ; 39.76,7.7 39.96,7.84 ; 39.76,7.7 39.96,7.84 ; 26.26,25.35 26.29,25.18 ; 26.26,25.35 26.26,31.04 ; 26.26,25.35 26.29,25.18 ; 26.26,25.35 26.26,31.04 ; 26.29,25.18 26.39,25.04 ; 26.29,25.18 26.39,25.04 ; 40.41,8.27 40.46,8.03 ; 40.41,8.27 40.46,8.03 ; 40.41,8.27 40.46,8.5 ; 40.41,8.27 40.46,8.5 ; 40.46,8.03 40.59,7.84 ; 40.46,8.03 40.59,7.84 ; 38.02,7.66 38.26,7.7 ; 38.02,7.66 38.26,7.7 ; 38.02,7.66 37.79,7.7 ; 38.02,7.66 37.79,7.7 ; 38.26,7.7 38.46,7.84 ; 38.26,7.7 38.46,7.84 ; 16.06,55.16 16.11,55.39 ; 16.06,55.16 15.93,54.96 ; 16.06,55.16 16.11,55.39 ; 16.06,55.16 15.93,54.96 ; 16.11,55.39 16.21,55.5 ; 16.11,55.39 16.21,55.5 ; 40.79,7.7 41.02,7.66 ; 40.79,7.7 40.59,7.84 ; 40.79,7.7 41.02,7.66 ; 40.79,7.7 40.59,7.84 ; 41.02,7.66 41.26,7.7 ; 41.02,7.66 41.26,7.7 ; 39.16,9.83 39.03,10.03 ; 39.16,9.83 39.03,10.03 ; 39.7,53.72 39.93,53.76 ; 39.7,53.72 39.47,53.76 ; 39.7,53.72 39.47,53.76 ; 39.7,53.72 39.93,53.76 ; 39.93,53.76 40.13,53.9 ; 39.93,53.76 40.13,53.9 ; 32.36,12.01 32.32,12.25 ; 32.36,12.01 32.34,11.85 ; 32.36,12.01 32.34,11.85 ; 32.36,12.01 32.32,12.25 ; 32.32,12.25 32.18,12.45 ; 32.32,12.25 32.18,12.45 ; 45.29,7.7 45.52,7.66 ; 45.29,7.7 45.52,7.66 ; 45.29,7.7 45.09,7.84 ; 45.29,7.7 45.09,7.84 ; 45.52,7.66 45.76,7.7 ; 45.52,7.66 45.76,7.7 ; 14.71,43.99 14.75,44.14 ; 14.71,43.99 14.58,43.79 ; 14.71,43.99 14.75,44.14 ; 14.71,43.99 14.58,43.79 ; 14.75,44.14 17.93,47.32 ; 14.75,44.14 17.93,47.32 ; 10.94,38.48 11,38.43 ; 10.94,38.48 11,38.43 ; 11,38.43 11,34.77 ; 11,38.43 11,34.77 ; 32.46,8.7 32.26,8.83 ; 32.46,8.7 32.59,8.5 ; 32.46,8.7 32.26,8.83 ; 32.46,8.7 32.59,8.5 ; 32.26,8.83 32.02,8.88 ; 32.26,8.83 32.02,8.88 ; 22.09,8.5 21.96,8.7 ; 22.09,8.5 21.96,8.7 ; 22.09,8.5 22.13,8.27 ; 22.09,8.5 22.13,8.27 ; 21.96,8.7 21.76,8.83 ; 21.96,8.7 21.76,8.83 ; 4.92,10.31 4.88,10.31 ; 4.92,10.31 5.17,10.24 ; 4.92,10.31 4.88,10.31 ; 4.92,10.31 5.17,10.24 ; 17.54,48.25 17.39,48.15 ; 17.54,48.25 17.73,48.29 ; 17.54,48.25 17.39,48.15 ; 17.54,48.25 17.73,48.29 ; 17.39,48.15 14.07,44.83 ; 17.39,48.15 14.07,44.83 ; 39.57,43.51 29.78,43.51 ; 39.57,43.51 39.74,43.48 ; 39.57,43.51 29.78,43.51 ; 39.57,43.51 39.74,43.48 ; 29.78,43.51 29.82,43.74 ; 29.78,43.51 29.82,43.74 ; 2.36,38.41 2.36,49.4 ; 2.36,38.41 5.74,35.03 ; 2.36,38.41 5.74,35.03 ; 2.36,38.41 2.36,49.4 ; 2.36,49.4 3.79,50.82 ; 2.36,49.4 3.79,50.82 ; 5.41,32.25 5.18,32.16 ; 5.41,32.25 5.56,32.31 ; 5.41,32.25 5.56,32.31 ; 5.41,32.25 5.18,32.16 ; 22,50.66 22.25,50.6 ; 22,50.66 22.25,50.6 ; 22,50.66 21.8,50.82 ; 22,50.66 21.8,50.82 ; 22.25,50.6 22.3,50.59 ; 22.25,50.6 22.3,50.59 ; 15.52,7.66 15.76,7.7 ; 15.52,7.66 15.29,7.7 ; 15.52,7.66 15.76,7.7 ; 15.52,7.66 15.29,7.7 ; 15.76,7.7 15.96,7.84 ; 15.76,7.7 15.96,7.84 ; 40.57,34.14 40.44,34.34 ; 40.57,34.14 40.62,33.91 ; 40.57,34.14 40.44,34.34 ; 40.57,34.14 40.62,33.91 ; 40.44,34.34 40.38,34.39 ; 40.44,34.34 40.38,34.39 ; 31.46,8.5 31.41,8.27 ; 31.46,8.5 31.41,8.27 ; 31.46,8.5 31.59,8.7 ; 31.46,8.5 31.59,8.7 ; 31.41,8.27 31.46,8.03 ; 31.41,8.27 31.46,8.03 ; 27.76,26.74 27.89,26.54 ; 27.76,26.74 27.71,26.97 ; 27.76,26.74 27.89,26.54 ; 27.76,26.74 27.71,26.97 ; 27.89,26.54 28.09,26.41 ; 27.89,26.54 28.09,26.41 ; 39.74,43.48 39.88,43.39 ; 39.74,43.48 39.88,43.39 ; 10.82,34.34 10.86,34.11 ; 10.82,34.34 10.86,34.57 ; 10.82,34.34 10.86,34.11 ; 10.82,34.34 10.86,34.57 ; 10.86,34.11 11,33.91 ; 10.86,34.11 11,33.91 ; 31.6,15.52 32.33,14.78 ; 31.6,15.52 31.46,15.73 ; 31.6,15.52 31.46,15.73 ; 31.6,15.52 32.33,14.78 ; 32.33,14.78 31.31,14.78 32.33,14.78 ; 21.49,36.81 21.25,36.76 ; 21.49,36.81 21.25,36.76 ; 21.49,36.81 21.72,36.76 ; 21.49,36.81 21.72,36.76 ; 21.25,36.76 21.06,36.63 ; 21.25,36.76 21.06,36.63 ; 5.94,28.4 6.08,28.59 ; 5.94,28.4 6.08,28.59 ; 5.94,28.4 5.75,28.26 ; 5.94,28.4 5.75,28.26 ; 6.08,28.59 6.12,28.83 ; 6.08,28.59 6.12,28.83 ; 30.61,26.47 30.56,26.72 ; 30.61,26.47 30.56,26.72 ; 30.61,26.47 30.56,26.21 ; 30.61,26.47 30.56,26.21 ; 30.56,26.72 30.42,26.94 ; 30.56,26.72 30.42,26.94 ; 40.59,8.7 40.46,8.5 ; 40.59,8.7 40.79,8.83 ; 40.59,8.7 40.46,8.5 ; 40.59,8.7 40.79,8.83 ; 4.95,29.99 5.08,29.79 ; 4.95,29.99 5.08,29.79 ; 4.95,29.99 4.9,30.23 ; 4.95,29.99 4.9,30.23 ; 5.08,29.79 5.15,29.73 ; 5.08,29.79 5.15,29.73 ; 40.06,9.75 40.54,9.75 ; 40.06,9.75 40.54,9.75 ; 31.53,16.25 31.46,16.17 ; 31.53,16.25 31.46,16.17 ; 31.53,16.25 31.68,16.32 ; 31.53,16.25 31.68,16.32 ; 31.46,16.17 31.38,16.03 ; 31.46,16.17 31.38,16.03 ; 10.46,8.03 10.59,7.84 ; 10.46,8.03 10.41,8.27 ; 10.46,8.03 10.41,8.27 ; 10.46,8.03 10.59,7.84 ; 10.59,7.84 10.79,7.7 ; 10.59,7.84 10.79,7.7 ; 21.76,8.83 21.52,8.88 ; 21.76,8.83 21.52,8.88 ; 23.16,50.75 22.95,50.61 ; 23.16,50.75 22.95,50.61 ; 23.16,50.75 23.42,50.8 ; 23.16,50.75 23.42,50.8 ; 22.95,50.61 22.81,50.39 ; 22.95,50.61 22.81,50.39 ; 17.26,7.7 17.46,7.84 ; 17.26,7.7 17.02,7.66 ; 17.26,7.7 17.02,7.66 ; 17.26,7.7 17.46,7.84 ; 39.17,26.77 39.3,26.97 ; 39.17,26.77 38.97,26.64 ; 39.17,26.77 39.3,26.97 ; 39.17,26.77 38.97,26.64 ; 38.22,34.59 38.35,34.39 ; 38.22,34.59 38.17,34.82 ; 38.22,34.59 38.17,34.82 ; 38.22,34.59 38.35,34.39 ; 38.35,34.39 38.55,34.26 ; 38.35,34.39 38.55,34.26 ; 42.76,8.83 42.52,8.88 ; 42.76,8.83 42.52,8.88 ; 10.31,32.73 10.31,32.72 ; 10.31,32.73 10.26,32.97 ; 10.31,32.73 10.31,32.72 ; 10.31,32.73 10.26,32.97 ; 10.31,32.72 6.15,32.72 ; 10.31,32.72 6.15,32.72 ; 21.1,27.11 20.91,26.98 ; 21.1,27.11 21.34,27.16 ; 21.1,27.11 20.91,26.98 ; 21.1,27.11 21.34,27.16 ; 20.91,26.98 20.24,26.98 ; 20.91,26.98 20.24,26.98 ; 8.84,43.06 8.84,47.65 ; 8.84,43.06 8.84,47.65 ; 8.84,43.06 12.78,39.12 ; 8.84,43.06 12.78,39.12 ; 31.52,24.18 31.54,24.01 ; 31.52,24.18 31.54,24.01 ; 31.52,24.18 31.57,24.42 ; 31.52,24.18 31.57,24.42 ; 31.54,24.01 30.47,24.01 ; 31.54,24.01 30.47,24.01 ; 39.98,17.07 31.21,17.07 ; 39.98,17.07 40.12,17.04 ; 39.98,17.07 40.12,17.04 ; 39.98,17.07 31.21,17.07 ; 31.21,17.07 31.07,17.04 ; 31.21,17.07 31.07,17.04 ; 39.11,41.33 38.91,41.2 ; 39.11,41.33 39.34,41.38 ; 39.11,41.33 38.91,41.2 ; 39.11,41.33 39.34,41.38 ; 38.91,41.2 38.78,41 ; 38.91,41.2 38.78,41 ; 46.35,26.09 46.33,25.93 ; 46.35,26.09 46.45,26.31 ; 46.35,26.09 46.33,25.93 ; 46.35,26.09 46.45,26.31 ; 46.33,25.93 46.37,25.7 ; 46.33,25.93 46.37,25.7 ; 11.46,57.03 11.24,57.12 ; 11.46,57.03 11.24,57.12 ; 17.93,47.32 25.08,47.32 ; 17.93,47.32 25.08,47.32 ; 32.02,7.66 32.26,7.7 ; 32.02,7.66 31.79,7.7 ; 32.02,7.66 32.26,7.7 ; 32.02,7.66 31.79,7.7 ; 32.26,7.7 32.46,7.84 ; 32.26,7.7 32.46,7.84 ; 20.5,36.96 20.69,36.82 ; 20.5,36.96 20.36,37.15 ; 20.5,36.96 20.69,36.82 ; 20.5,36.96 20.36,37.15 ; 20.69,36.82 20.93,36.78 ; 20.69,36.82 20.93,36.78 ; 15.21,24.4 15.14,24.48 ; 15.21,24.4 15.14,24.48 ; 15.21,24.4 15.21,32.47 ; 15.21,24.4 15.21,32.47 ; 21.76,7.7 21.96,7.84 ; 21.76,7.7 21.52,7.66 ; 21.76,7.7 21.52,7.66 ; 21.76,7.7 21.96,7.84 ; 21.96,7.84 22.09,8.03 ; 21.96,7.84 22.09,8.03 ; 10.51,39.52 10.38,39.33 ; 10.51,39.52 10.71,39.66 ; 10.51,39.52 10.71,39.66 ; 10.51,39.52 10.38,39.33 ; 10.38,39.33 10.34,39.09 ; 10.38,39.33 10.34,39.09 ; 5.13,34.41 5.13,34.37 ; 5.13,34.41 1.62,37.92 ; 5.13,34.41 1.62,37.92 ; 5.13,34.41 5.13,34.37 ; 5.13,34.37 5.18,34.11 ; 5.13,34.37 5.18,34.11 ; 36.53,39.29 36.58,39.52 ; 36.53,39.29 36.4,39.09 ; 36.53,39.29 36.4,39.09 ; 36.53,39.29 36.58,39.52 ; 36.58,39.52 36.53,39.76 ; 36.58,39.52 36.53,39.76 ; 38.03,31.96 37.95,32.1 ; 38.03,31.96 38.08,31.72 ; 38.03,31.96 38.08,31.72 ; 38.03,31.96 37.95,32.1 ; 37.95,32.1 37.95,37.72 ; 37.95,32.1 37.95,37.72 ; 7.79,7.7 8.02,7.66 ; 7.79,7.7 7.59,7.84 ; 7.79,7.7 7.59,7.84 ; 7.79,7.7 8.02,7.66 ; 8.02,7.66 8.26,7.7 ; 8.02,7.66 8.26,7.7 ; 0.48,38.14 0.48,18.28 ; 0.48,38.14 0.42,38.25 ; 0.48,38.14 0.42,38.25 ; 0.48,38.14 0.48,18.28 ; 0.48,18.28 0.36,18.06 ; 0.48,18.28 0.36,18.06 ; 39.12,19.71 39.35,19.75 ; 39.12,19.71 39.35,19.75 ; 39.12,19.71 38.98,19.72 ; 39.12,19.71 38.98,19.72 ; 39.35,19.75 39.55,19.89 ; 39.35,19.75 39.55,19.89 ; 11.96,52.81 12.19,52.86 ; 11.96,52.81 12.19,52.86 ; 8.1,42.57 10.97,39.7 ; 8.1,42.57 8.01,42.71 ; 8.1,42.57 10.97,39.7 ; 8.1,42.57 8.01,42.71 ; 10.97,39.7 10.95,39.7 ; 10.97,39.7 10.95,39.7 ; 38.22,26.87 38.13,27.1 ; 38.22,26.87 38.13,27.1 ; 27.89,32.71 27.89,27.41 ; 27.89,32.71 27.89,27.41 ; 27.89,32.71 25.73,34.87 ; 27.89,32.71 25.73,34.87 ; 27.89,27.41 27.75,27.21 ; 27.89,27.41 27.75,27.21 ; 28.19,24.08 28.43,24.12 ; 28.19,24.08 27.96,24.12 ; 28.19,24.08 27.96,24.12 ; 28.19,24.08 28.43,24.12 ; 28.43,24.12 28.63,24.26 ; 28.43,24.12 28.63,24.26 ; 17.73,48.29 32.8,48.29 ; 17.73,48.29 32.8,48.29 ; 38.55,35.39 38.35,35.26 ; 38.55,35.39 38.79,35.44 ; 38.55,35.39 38.35,35.26 ; 38.55,35.39 38.79,35.44 ; 38.35,35.26 38.22,35.06 ; 38.35,35.26 38.22,35.06 ; 8.64,48.65 8.84,48.51 ; 8.64,48.65 8.84,48.51 ; 31.52,12.58 31.32,12.45 ; 31.52,12.58 31.75,12.63 ; 31.52,12.58 31.75,12.63 ; 31.52,12.58 31.32,12.45 ; 31.32,12.45 31.18,12.25 ; 31.32,12.45 31.18,12.25 ; 45.96,31.87 45.92,32.04 ; 45.96,31.87 45.96,8.77 ; 45.96,31.87 45.92,32.04 ; 45.96,31.87 45.96,8.77 ; 39.57,31.55 38.66,30.64 ; 39.57,31.55 39.57,33.4 ; 39.57,31.55 39.57,33.4 ; 39.57,31.55 38.66,30.64 ; 40.08,41.7 40.28,41.57 ; 40.08,41.7 40.28,41.57 ; 40.08,41.7 39.95,41.9 ; 40.08,41.7 39.95,41.9 ; 40.28,41.57 40.51,41.53 ; 40.28,41.57 40.51,41.53 ; 46.04,47.27 45.98,47.27 ; 46.04,47.27 45.98,47.27 ; 46.04,47.27 46.27,47.19 ; 46.04,47.27 46.27,47.19 ; 45.98,47.27 45.14,48.11 ; 45.98,47.27 45.14,48.11 ; 7.33,11.64 7.47,11.73 ; 7.33,11.64 7.16,11.6 ; 7.33,11.64 7.16,11.6 ; 7.33,11.64 7.47,11.73 ; 7.47,11.73 15.5,19.76 ; 7.47,11.73 15.5,19.76 ; 35.91,8.27 35.96,8.03 ; 35.91,8.27 35.96,8.5 ; 35.91,8.27 35.96,8.5 ; 35.91,8.27 35.96,8.03 ; 35.96,8.03 36.09,7.84 ; 35.96,8.03 36.09,7.84 ; 39.44,33.67 39.5,33.56 ; 39.44,33.67 39.39,33.91 ; 39.44,33.67 39.5,33.56 ; 39.44,33.67 39.39,33.91 ; 39.5,33.56 39.57,33.4 ; 39.5,33.56 39.57,33.4 ; 5.51,30.84 5.28,30.79 ; 5.51,30.84 5.76,31.09 ; 5.51,30.84 5.28,30.79 ; 5.51,30.84 5.76,31.09 ; 5.28,30.79 5.08,30.66 ; 5.28,30.79 5.08,30.66 ; 21.95,26.54 21.9,26.78 ; 21.95,26.54 21.9,26.31 ; 21.95,26.54 21.9,26.78 ; 21.95,26.54 21.9,26.31 ; 21.9,26.78 21.77,26.98 ; 21.9,26.78 21.77,26.98 ; 6.04,34.98 5.79,35.03 ; 6.04,34.98 6.26,34.83 ; 6.04,34.98 6.26,34.83 ; 6.04,34.98 5.79,35.03 ; 5.79,35.03 5.74,35.03 ; 5.79,35.03 5.74,35.03 ; 44.59,8.5 44.46,8.7 ; 44.59,8.5 44.63,8.27 ; 44.59,8.5 44.63,8.27 ; 44.59,8.5 44.46,8.7 ; 21.02,16.37 21.16,16.59 ; 21.02,16.37 20.8,16.23 ; 21.02,16.37 20.8,16.23 ; 21.02,16.37 21.16,16.59 ; 21.16,16.59 21.21,16.84 ; 21.16,16.59 21.21,16.84 ; 10.71,39.66 10.95,39.7 ; 10.71,39.66 10.95,39.7 ; 36.78,25.99 36.98,25.96 ; 36.78,25.99 36.74,25.77 ; 36.78,25.99 36.74,25.77 ; 36.78,25.99 36.98,25.96 ; 36.98,25.96 37.22,26 ; 36.98,25.96 37.22,26 ; 19.49,22.36 19.35,22.32 ; 19.49,22.36 19.52,22.37 ; 19.49,22.36 19.35,22.32 ; 19.49,22.36 19.52,22.37 ; 13.56,44.38 13.54,44.22 ; 13.56,44.38 13.66,44.59 ; 13.56,44.38 13.66,44.59 ; 13.56,44.38 13.54,44.22 ; 13.54,44.22 13.58,43.99 ; 13.54,44.22 13.58,43.99 ; 38.08,31.72 38.03,31.49 ; 38.08,31.72 38.03,31.49 ; 36.22,53.01 36.45,53.05 ; 36.22,53.01 35.99,53.05 ; 36.22,53.01 35.99,53.05 ; 36.22,53.01 36.45,53.05 ; 36.45,53.05 36.65,53.19 ; 36.45,53.05 36.65,53.19 ; 40.41,31.2 40.44,31.37 ; 40.41,31.2 40.31,31.06 ; 40.41,31.2 40.44,31.37 ; 40.41,31.2 40.31,31.06 ; 40.44,31.37 40.44,33.4 ; 40.44,31.37 40.44,33.4 ; 18.95,20.57 18.99,20.34 ; 18.95,20.57 18.99,20.34 ; 18.95,20.57 18.98,20.77 ; 18.95,20.57 18.98,20.77 ; 18.99,20.34 19.12,20.14 ; 18.99,20.34 19.12,20.14 ; 5.5,11.6 7.16,11.6 ; 5.5,11.6 7.16,11.6 ; 5.5,11.6 5.47,11.57 ; 5.5,11.6 5.47,11.57 ; 21.5,17.25 21.53,17.27 ; 21.5,17.25 21.34,17.22 ; 21.5,17.25 21.53,17.27 ; 21.5,17.25 21.34,17.22 ; 21.53,17.27 21.14,15.75 ; 21.53,17.27 21.14,15.75 ; 24.25,24.44 24.26,24.54 ; 24.25,24.44 24.17,24.2 ; 24.25,24.44 24.26,24.54 ; 24.25,24.44 24.17,24.2 ; 24.26,24.54 24.21,24.79 ; 24.26,24.54 24.21,24.79 ; 23.1,49.56 17.15,49.56 ; 23.1,49.56 17.15,49.56 ; 46.35,58.04 50.31,58.04 ; 46.35,58.04 50.31,58.04 ; 46.35,58.04 46.22,58.07 ; 46.35,58.04 46.22,58.07 ; 17.96,8.5 17.91,8.27 ; 17.96,8.5 18.09,8.7 ; 17.96,8.5 17.91,8.27 ; 17.96,8.5 18.09,8.7 ; 17.91,8.27 17.96,8.03 ; 17.91,8.27 17.96,8.03 ; 28.06,12.77 28.89,14.09 ; 28.06,12.77 26.78,11.86 ; 28.06,12.77 26.78,11.86 ; 28.06,12.77 28.89,14.09 ; 28.89,14.09 29.15,15.52 ; 28.89,14.09 29.15,15.52 ; 42.57,35.26 42.57,35.26 ; 42.57,35.26 42.57,35.26 ; 42.57,35.26 42.74,35.22 ; 42.57,35.26 42.74,35.22 ; 42.57,35.26 39.29,35.26 ; 42.57,35.26 39.29,35.26 ; 10.56,56.75 10.51,56.52 ; 10.56,56.75 10.69,56.95 ; 10.56,56.75 10.69,56.95 ; 10.56,56.75 10.51,56.52 ; 19.79,22.55 19.91,22.61 ; 19.79,22.55 19.56,22.5 ; 19.79,22.55 19.91,22.61 ; 19.79,22.55 19.56,22.5 ; 19.91,22.61 20.06,22.68 ; 19.91,22.61 20.06,22.68 ; 26.38,47.32 26.39,47.19 ; 26.38,47.32 26.39,47.19 ; 6.96,7.84 7.09,8.03 ; 6.96,7.84 7.09,8.03 ; 7.09,8.03 7.14,8.27 ; 7.09,8.03 7.14,8.27 ; 12.57,8.93 12.42,8.87 ; 12.57,8.93 12.42,8.87 ; 12.42,8.87 12.19,8.78 ; 12.42,8.87 12.19,8.78 ; 15.96,7.84 16.09,8.03 ; 15.96,7.84 16.09,8.03 ; 16.09,8.03 16.13,8.27 ; 16.09,8.03 16.13,8.27 ; 15.76,8.83 15.52,8.88 ; 15.76,8.83 15.96,8.7 ; 15.76,8.83 15.52,8.88 ; 15.76,8.83 15.96,8.7 ; 15.52,8.88 15.29,8.83 ; 15.52,8.88 15.29,8.83 ; 19.41,8.27 19.46,8.03 ; 19.41,8.27 19.46,8.5 ; 19.41,8.27 19.46,8.5 ; 19.41,8.27 19.46,8.03 ; 19.46,8.03 19.59,7.84 ; 19.46,8.03 19.59,7.84 ; 35.96,8.5 36.09,8.7 ; 35.96,8.5 36.09,8.7 ; 44.02,7.66 44.26,7.7 ; 44.02,7.66 43.79,7.7 ; 44.02,7.66 44.26,7.7 ; 44.02,7.66 43.79,7.7 ; 44.26,7.7 44.46,7.84 ; 44.26,7.7 44.46,7.84 ; 36.24,55.81 36.25,55.93 ; 36.24,55.81 36.65,55.81 ; 36.24,55.81 36.65,55.81 ; 36.24,55.81 36.25,55.93 ; 36.25,55.93 36.24,56 ; 36.25,55.93 36.24,56 ; 19.46,8.5 19.59,8.7 ; 19.46,8.5 19.59,8.7 ; 24.16,50.26 30.66,50.26 ; 24.16,50.26 30.66,50.26 ; 24.16,50.26 24.08,50.19 ; 24.16,50.26 24.08,50.19 ; 29.63,8.27 29.59,8.5 ; 29.63,8.27 29.59,8.03 ; 29.63,8.27 29.59,8.5 ; 29.63,8.27 29.59,8.03 ; 29.59,8.5 29.46,8.7 ; 29.59,8.5 29.46,8.7 ; 32.8,11.49 32.67,11.68 ; 32.8,11.49 32.67,11.68 ; 32.8,11.49 32.84,11.25 ; 32.8,11.49 32.84,11.25 ; 32.67,11.68 32.47,11.82 ; 32.67,11.68 32.47,11.82 ; 5.08,28.4 5.28,28.26 ; 5.08,28.4 4.95,28.59 ; 5.08,28.4 4.95,28.59 ; 5.08,28.4 5.28,28.26 ; 5.28,28.26 5.51,28.22 ; 5.28,28.26 5.51,28.22 ; 41.46,8.7 41.26,8.83 ; 41.46,8.7 41.26,8.83 ; 41.46,8.7 41.59,8.5 ; 41.46,8.7 41.59,8.5 ; 41.26,8.83 41.02,8.88 ; 41.26,8.83 41.02,8.88 ; 14.59,8.03 14.46,7.84 ; 14.59,8.03 14.46,7.84 ; 28.75,32.86 35.52,26.1 ; 28.75,32.86 35.52,26.1 ; 28.75,32.86 28.75,27.41 ; 28.75,32.86 28.75,27.41 ; 35.52,26.1 35.56,25.97 ; 35.52,26.1 35.56,25.97 ; 30.53,24.64 30.39,24.85 ; 30.53,24.64 30.39,24.85 ; 47.33,50.37 40.82,56.88 ; 47.33,50.37 47.44,50.21 ; 47.33,50.37 40.82,56.88 ; 47.33,50.37 47.44,50.21 ; 5,11.38 5.26,11.43 ; 5,11.38 5.26,11.43 ; 5,11.38 4.89,11.39 ; 5,11.38 4.89,11.39 ; 5.26,11.43 5.47,11.57 ; 5.26,11.43 5.47,11.57 ; 12.87,38.98 12.78,39.12 ; 12.87,38.98 12.91,38.81 ; 12.87,38.98 12.78,39.12 ; 12.87,38.98 12.91,38.81 ; 42.09,8.7 41.96,8.5 ; 42.09,8.7 41.96,8.5 ; 42.09,8.7 42.29,8.83 ; 42.09,8.7 42.29,8.83 ; 33.61,48.24 33.41,48.37 ; 33.61,48.24 33.41,48.37 ; 33.61,48.24 33.74,48.04 ; 33.61,48.24 33.74,48.04 ; 33.41,48.37 33.17,48.42 ; 33.41,48.37 33.17,48.42 ; 3.78,13.22 3.78,13.21 ; 3.78,13.22 3.78,13.21 ; 3.78,13.22 2.93,12.37 ; 3.78,13.22 2.93,12.37 ; 3.78,13.21 3.78,8.82 ; 3.78,13.21 3.78,8.82 ; 31.59,7.84 31.79,7.7 ; 31.59,7.84 31.46,8.03 ; 31.59,7.84 31.79,7.7 ; 31.59,7.84 31.46,8.03 ; 3.79,50.82 21.8,50.82 ; 3.79,50.82 21.8,50.82 ; 14.96,8.5 14.91,8.27 ; 14.96,8.5 15.09,8.7 ; 14.96,8.5 14.91,8.27 ; 14.96,8.5 15.09,8.7 ; 14.91,8.27 14.96,8.03 ; 14.91,8.27 14.96,8.03 ; 28.5,43.81 28.5,43.74 ; 28.5,43.81 25.78,46.53 ; 28.5,43.81 25.78,46.53 ; 28.5,43.81 28.5,43.74 ; 28.5,43.74 28.54,43.51 ; 28.5,43.74 28.54,43.51 ; 44.46,7.84 44.59,8.03 ; 44.46,7.84 44.59,8.03 ; 15.03,32.49 15.04,32.56 ; 15.03,32.49 15.04,32.56 ; 9.42,9.97 9.45,10.13 ; 9.42,9.97 9.32,9.83 ; 9.42,9.97 9.32,9.83 ; 9.42,9.97 9.45,10.13 ; 9.45,10.13 9.45,11.2 ; 9.45,10.13 9.45,11.2 ; 46.37,25.7 46.51,25.5 ; 46.37,25.7 46.51,25.5 ; 40.25,56 46.45,49.8 ; 40.25,56 36.24,56 ; 40.25,56 46.45,49.8 ; 40.25,56 36.24,56 ; 46.45,49.8 46.45,47.04 ; 46.45,49.8 46.45,47.04 ; 16.94,55.5 16.91,55.48 ; 16.94,55.5 16.91,55.48 ; 16.94,55.5 16.21,55.5 ; 16.94,55.5 16.21,55.5 ; 16.91,55.48 16.68,55.43 ; 16.91,55.48 16.68,55.43 ; 37.13,8.27 37.09,8.5 ; 37.13,8.27 37.09,8.03 ; 37.13,8.27 37.09,8.5 ; 37.13,8.27 37.09,8.03 ; 37.09,8.5 36.96,8.7 ; 37.09,8.5 36.96,8.7 ; 28.77,38.83 28.78,38.96 ; 28.77,38.83 28.66,38.59 ; 28.77,38.83 28.66,38.59 ; 28.77,38.83 28.78,38.96 ; 28.78,38.96 28.73,39.22 ; 28.78,38.96 28.73,39.22 ; 5.54,33.75 5.79,33.7 ; 5.54,33.75 5.32,33.9 ; 5.54,33.75 5.79,33.7 ; 5.54,33.75 5.32,33.9 ; 5.79,33.7 6.04,33.75 ; 5.79,33.7 6.04,33.75 ; 2.37,10.37 1.5,11.24 ; 2.37,10.37 1.5,11.24 ; 2.37,10.37 2.48,10.2 ; 2.37,10.37 2.48,10.2 ; 1.5,11.24 1.5,12.22 ; 1.5,11.24 1.5,12.22 ; 20.06,23.55 19.91,23.62 ; 20.06,23.55 21.61,23.55 ; 20.06,23.55 21.61,23.55 ; 20.06,23.55 19.91,23.62 ; 19.91,23.62 19.69,23.71 ; 19.91,23.62 19.69,23.71 ; 33.13,9.09 33.33,9.22 ; 33.13,9.09 32.89,9.04 ; 33.13,9.09 33.33,9.22 ; 33.13,9.09 32.89,9.04 ; 29.82,43.74 29.77,43.99 ; 29.82,43.74 29.77,43.99 ; 9.76,7.7 9.96,7.84 ; 9.76,7.7 9.96,7.84 ; 9.76,7.7 9.52,7.66 ; 9.76,7.7 9.52,7.66 ; 9.96,7.84 10.09,8.03 ; 9.96,7.84 10.09,8.03 ; 37.57,14.78 37.42,14.86 ; 37.57,14.78 37.42,14.86 ; 37.42,14.86 37.28,15 37.42,14.86 ; 29.38,24.01 23.99,24.01 ; 29.38,24.01 23.99,24.01 ; 29.38,24.01 29.31,24.13 ; 29.38,24.01 29.31,24.13 ; 23.99,24.01 24.17,24.2 ; 23.99,24.01 24.17,24.2 ; 14.86,33 14.66,33.13 ; 14.86,33 14.99,32.8 ; 14.86,33 14.66,33.13 ; 14.86,33 14.99,32.8 ; 14.66,33.13 14.59,33.15 ; 14.66,33.13 14.59,33.15 ; 15.14,23.62 15.21,23.71 ; 15.14,23.62 15.21,23.71 ; 36.36,15.81 36.14,15.81 36.36,15.81 ; 36.36,15.81 36.51,15.73 ; 36.36,15.81 36.51,15.73 ; 16.13,8.27 16.09,8.5 ; 16.13,8.27 16.09,8.5 ; 35.01,48.56 35.2,48.69 ; 35.01,48.56 35.2,48.69 ; 35.01,48.56 34.77,48.51 ; 35.01,48.56 34.77,48.51 ; 35.2,48.69 44.12,48.69 ; 35.2,48.69 44.12,48.69 ; 13.19,8.32 14.59,9.73 ; 13.19,8.32 14.59,9.73 ; 13.19,8.32 13.13,8.16 ; 13.19,8.32 13.13,8.16 ; 14.59,9.73 14.87,9.73 ; 14.59,9.73 14.87,9.73 ; 25.46,8.03 25.59,7.84 ; 25.46,8.03 25.41,8.27 ; 25.46,8.03 25.41,8.27 ; 25.46,8.03 25.59,7.84 ; 25.59,7.84 25.79,7.7 ; 25.59,7.84 25.79,7.7 ; 28.54,43.51 20.98,43.51 ; 28.54,43.51 20.98,43.51 ; 37.32,55.94 37.08,55.98 ; 37.32,55.94 37.08,55.98 ; 37.08,55.98 36.85,55.94 ; 37.08,55.98 36.85,55.94 ; 1.48,8.54 1.5,8.71 ; 1.48,8.54 1.5,8.71 ; 36.6,25.58 36.74,25.77 ; 36.6,25.58 36.4,25.44 ; 36.6,25.58 36.74,25.77 ; 36.6,25.58 36.4,25.44 ; 19.61,18.49 19.74,18.69 ; 19.61,18.49 19.41,18.36 ; 19.61,18.49 19.41,18.36 ; 19.61,18.49 19.74,18.69 ; 19.74,18.69 19.78,18.82 ; 19.74,18.69 19.78,18.82 ; 26.59,40.38 26.6,40.52 ; 26.59,40.38 26.43,39.84 ; 26.59,40.38 26.6,40.52 ; 26.59,40.38 26.43,39.84 ; 26.6,40.52 26.49,41.08 ; 26.6,40.52 26.49,41.08 ; 40.13,8.27 40.09,8.5 ; 40.13,8.27 40.09,8.03 ; 40.13,8.27 40.09,8.5 ; 40.13,8.27 40.09,8.03 ; 40.09,8.5 39.96,8.7 ; 40.09,8.5 39.96,8.7 ; 13.84,32.4 12.8,31.37 ; 13.84,32.4 12.8,31.37 ; 16.21,20.42 16.16,20.68 ; 16.21,20.42 16.16,20.17 ; 16.21,20.42 16.16,20.17 ; 16.21,20.42 16.16,20.68 ; 16.16,20.68 16.01,20.89 ; 16.16,20.68 16.01,20.89 ; 20.48,32.36 20.33,32.57 ; 20.48,32.36 20.33,32.57 ; 20.48,32.36 20.53,32.11 ; 20.48,32.36 20.53,32.11 ; 20.33,32.57 20.3,32.61 ; 20.33,32.57 20.3,32.61 ; 39.8,22.4 39.94,22.2 ; 39.8,22.4 39.94,22.2 ; 14.54,23.47 14.57,23.39 ; 14.54,23.47 14.57,23.39 ; 46.51,25.5 46.7,25.37 ; 46.51,25.5 46.7,25.37 ; 17.21,54.32 17.33,54.12 ; 17.21,54.32 17.15,54.3 ; 17.21,54.32 17.15,54.3 ; 17.21,54.32 17.33,54.12 ; 17.33,54.12 17.4,54.05 ; 17.33,54.12 17.4,54.05 ; 16.59,8.7 16.46,8.5 ; 16.59,8.7 16.79,8.83 ; 16.59,8.7 16.79,8.83 ; 16.59,8.7 16.46,8.5 ; 16.46,8.5 16.41,8.27 ; 16.46,8.5 16.41,8.27 ; 17.46,8.7 17.26,8.83 ; 17.46,8.7 17.26,8.83 ; 17.46,8.7 17.59,8.5 ; 17.46,8.7 17.59,8.5 ; 17.26,8.83 17.02,8.88 ; 17.26,8.83 17.02,8.88 ; 6.71,35.61 6.66,35.84 ; 6.71,35.61 6.66,35.38 ; 6.71,35.61 6.66,35.38 ; 6.71,35.61 6.66,35.84 ; 6.66,35.84 6.53,36.04 ; 6.66,35.84 6.53,36.04 ; 20.98,43.51 20.81,43.48 ; 20.98,43.51 20.81,43.48 ; 20.81,43.48 20.67,43.39 ; 20.81,43.48 20.67,43.39 ; 19.84,18.97 20.75,19.89 ; 19.84,18.97 19.78,18.82 ; 19.84,18.97 19.78,18.82 ; 19.84,18.97 20.75,19.89 ; 20.75,19.89 22.96,19.89 ; 20.75,19.89 22.96,19.89 ; 39.58,40.2 39.68,40.26 ; 39.58,40.2 39.34,40.16 ; 39.58,40.2 39.68,40.26 ; 39.58,40.2 39.34,40.16 ; 39.68,40.26 46.45,40.26 ; 39.68,40.26 46.45,40.26 ; 1.62,17.66 1.65,17.86 ; 1.62,17.66 1.5,17.43 ; 1.62,17.66 1.65,17.86 ; 1.62,17.66 1.5,17.43 ; 1.65,17.86 1.6,18.11 ; 1.65,17.86 1.6,18.11 ; 10.34,39.09 10.38,38.86 ; 10.34,39.09 10.38,38.86 ; 0.48,12.73 0.48,11.02 ; 0.48,12.73 0.48,11.02 ; 0.48,12.73 0.48,17.43 ; 0.48,12.73 0.48,17.43 ; 0.48,11.02 0.52,10.83 ; 0.48,11.02 0.52,10.83 ; 19.12,20.14 19.32,20.01 ; 19.12,20.14 19.32,20.01 ; 31.97,16.32 31.68,16.32 ; 31.97,16.32 31.68,16.32 ; 31.97,16.32 32.11,16.25 ; 31.97,16.32 32.11,16.25 ; 31.09,8.5 30.96,8.7 ; 31.09,8.5 30.96,8.7 ; 31.09,8.5 31.13,8.27 ; 31.09,8.5 31.13,8.27 ; 30.96,8.7 30.76,8.83 ; 30.96,8.7 30.76,8.83 ; 38.78,40.53 38.91,40.33 ; 38.78,40.53 38.73,40.77 ; 38.78,40.53 38.91,40.33 ; 38.78,40.53 38.73,40.77 ; 38.91,40.33 39.11,40.2 ; 38.91,40.33 39.11,40.2 ; 18.87,21.48 19,21.28 ; 18.87,21.48 19,21.28 ; 18.87,21.48 18.82,21.72 ; 18.87,21.48 18.82,21.72 ; 19,21.28 19.2,21.15 ; 19,21.28 19.2,21.15 ; 36.52,8.88 36.29,8.83 ; 36.52,8.88 36.76,8.83 ; 36.52,8.88 36.76,8.83 ; 36.52,8.88 36.29,8.83 ; 36.29,8.83 36.09,8.7 ; 36.29,8.83 36.09,8.7 ; 5.08,30.66 4.95,30.46 ; 5.08,30.66 4.95,30.46 ; 21.92,35.76 23.97,35.76 ; 21.92,35.76 23.97,35.76 ; 21.92,35.76 21.72,35.63 ; 21.92,35.76 21.72,35.63 ; 23.97,35.76 23.92,35.51 ; 23.97,35.76 23.92,35.51 ; 0.43,38.72 0.38,38.48 ; 0.43,38.72 0.38,38.48 ; 0.43,38.72 0.56,38.91 ; 0.43,38.72 0.56,38.91 ; 0.38,38.48 0.42,38.25 ; 0.38,38.48 0.42,38.25 ; 20.42,26.11 20.9,26.11 ; 20.42,26.11 20.9,26.11 ; 20.42,26.11 15.38,21.06 ; 20.42,26.11 15.38,21.06 ; 20.9,26.11 20.9,24.44 ; 20.9,26.11 20.9,24.44 ; 35.56,25.97 35.62,25.74 ; 35.56,25.97 35.62,25.74 ; 20,17.22 19.9,16.98 ; 20,17.22 19.81,17.22 ; 20,17.22 19.81,17.22 ; 20,17.22 19.9,16.98 ; 19.9,16.98 19.89,16.84 ; 19.9,16.98 19.89,16.84 ; 39.96,8.7 39.76,8.83 ; 39.96,8.7 39.76,8.83 ; 4.95,30.46 4.9,30.23 ; 4.95,30.46 4.9,30.23 ; 34.94,38.69 35,38.68 ; 34.94,38.69 35,38.68 ; 34.94,38.69 34.71,38.76 ; 34.94,38.69 34.71,38.76 ; 45.09,26.4 44.87,26.5 ; 45.09,26.4 44.87,26.5 ; 45.09,26.4 45.09,31.69 ; 45.09,26.4 45.09,31.69 ; 44.87,26.5 44.73,26.52 ; 44.87,26.5 44.73,26.52 ; 44.85,25.31 45.07,25.4 ; 44.85,25.31 42.09,22.55 ; 44.85,25.31 45.07,25.4 ; 44.85,25.31 42.09,22.55 ; 45.07,25.4 45.09,25.41 ; 45.07,25.4 45.09,25.41 ; 17.35,48.59 32.77,48.59 ; 17.35,48.59 32.77,48.59 ; 17.35,48.59 12.82,44.07 ; 17.35,48.59 12.82,44.07 ; 32.77,48.59 32.99,48.48 ; 32.77,48.59 32.99,48.48 ; 24.29,7.7 24.52,7.66 ; 24.29,7.7 24.52,7.66 ; 24.29,7.7 24.09,7.84 ; 24.29,7.7 24.09,7.84 ; 24.52,7.66 24.76,7.7 ; 24.52,7.66 24.76,7.7 ; 28.19,25.3 27.96,25.25 ; 28.19,25.3 27.96,25.25 ; 27.96,25.25 27.76,25.12 ; 27.96,25.25 27.76,25.12 ; 39.4,33.98 39.39,33.91 ; 39.4,33.98 39.39,33.91 ; 39.4,33.98 39.47,34.21 ; 39.4,33.98 39.47,34.21 ; 7.84,48.32 7.8,48.08 ; 7.84,48.32 7.8,48.08 ; 36.09,7.84 36.29,7.7 ; 36.09,7.84 36.29,7.7 ; 36.29,7.7 36.52,7.66 ; 36.29,7.7 36.52,7.66 ; 31.09,8.04 31.13,8.27 ; 31.09,8.04 30.96,7.84 ; 31.09,8.04 30.96,7.84 ; 31.09,8.04 31.13,8.27 ; 44.13,26.03 41.66,23.56 ; 44.13,26.03 44.16,26.14 ; 44.13,26.03 41.66,23.56 ; 44.13,26.03 44.16,26.14 ; 41.66,23.56 41.66,23.57 ; 41.66,23.56 41.66,23.57 ; 22.3,51.92 22.05,51.87 ; 22.3,51.92 22.55,51.87 ; 22.3,51.92 22.55,51.87 ; 22.3,51.92 22.05,51.87 ; 22.05,51.87 21.83,51.73 ; 22.05,51.87 21.83,51.73 ; 37.28,15.52 37.35,15.66 ; 37.28,15.52 37.35,15.66 ; 20.32,37.39 20.36,37.15 ; 20.32,37.39 20.36,37.62 ; 20.32,37.39 20.36,37.15 ; 20.32,37.39 20.36,37.62 ; 12.91,31.34 12.88,31.18 ; 12.91,31.34 12.88,31.18 ; 40.81,24.14 40.62,24.01 ; 40.81,24.14 40.62,24.01 ; 40.81,24.14 41.05,24.18 ; 40.81,24.14 41.05,24.18 ; 40.62,24.01 32.72,24.01 ; 40.62,24.01 32.72,24.01 ; 21.77,26.11 21.9,26.31 ; 21.77,26.11 21.77,24.61 ; 21.77,26.11 21.77,24.61 ; 21.77,26.11 21.9,26.31 ; 7.41,8.27 7.46,8.03 ; 7.41,8.27 7.46,8.5 ; 7.41,8.27 7.46,8.5 ; 7.41,8.27 7.46,8.03 ; 7.46,8.03 7.59,7.84 ; 7.46,8.03 7.59,7.84 ; 10.41,8.27 10.43,8.4 ; 10.41,8.27 10.43,8.4 ; 2.57,12.22 2.77,12.26 ; 2.57,12.22 1.5,12.22 ; 2.57,12.22 1.5,12.22 ; 2.57,12.22 2.77,12.26 ; 2.77,12.26 2.93,12.37 ; 2.77,12.26 2.93,12.37 ; 49.45,8.39 49.43,8.25 ; 49.45,8.39 49.43,8.25 ; 49.45,8.39 49.53,8.51 ; 49.45,8.39 49.53,8.51 ; 49.43,8.25 49.43,7.37 ; 49.43,8.25 49.43,7.37 ; 21.34,17.22 21.09,17.22 ; 21.34,17.22 21.09,17.22 ; 19.07,17.09 19.3,17.04 ; 19.07,17.09 18.87,17.22 ; 19.07,17.09 18.87,17.22 ; 19.07,17.09 19.3,17.04 ; 19.3,17.04 19.54,17.09 ; 19.3,17.04 19.54,17.09 ; 38.17,55.38 37.97,55.25 ; 38.17,55.38 37.97,55.25 ; 38.17,55.38 38.41,55.42 ; 38.17,55.38 38.41,55.42 ; 37.97,55.25 37.68,55.25 ; 37.97,55.25 37.68,55.25 ; 19.69,22.41 19.52,22.37 ; 19.69,22.41 38.86,22.41 ; 19.69,22.41 38.86,22.41 ; 19.69,22.41 19.52,22.37 ; 5.59,8.03 5.64,8.27 ; 5.59,8.03 5.64,8.27 ; 5.59,8.03 5.46,7.84 ; 5.59,8.03 5.46,7.84 ; 37.95,37.72 38.08,37.92 ; 37.95,37.72 38.08,37.92 ; 38.08,37.92 38.13,38.15 ; 38.08,37.92 38.13,38.15 ; 30.91,51.31 30.7,51.17 ; 30.91,51.31 31.17,51.36 ; 30.91,51.31 31.17,51.36 ; 30.91,51.31 30.7,51.17 ; 30.7,51.17 30.66,51.13 ; 30.7,51.17 30.66,51.13 ; 41.08,41.9 40.95,41.7 ; 41.08,41.9 40.95,41.7 ; 21.36,36.95 22.44,36.95 ; 21.36,36.95 21.16,36.82 ; 21.36,36.95 21.16,36.82 ; 21.36,36.95 22.44,36.95 ; 22.44,36.95 22.43,36.81 ; 22.44,36.95 22.43,36.81 ; 31.79,8.83 31.59,8.7 ; 31.79,8.83 31.59,8.7 ; 31.79,8.83 32.02,8.88 ; 31.79,8.83 32.02,8.88 ; 36.27,40.31 33.94,42.64 ; 36.27,40.31 36.36,40.19 ; 36.27,40.31 33.94,42.64 ; 36.27,40.31 36.36,40.19 ; 24.08,24.99 24.08,29.75 ; 24.08,24.99 24.21,24.79 ; 24.08,24.99 24.08,29.75 ; 24.08,24.99 24.21,24.79 ; 24.08,29.75 24.22,29.97 ; 24.08,29.75 24.22,29.97 ; 5.18,34.11 5.32,33.9 ; 5.18,34.11 5.32,33.9 ; 27.29,8.83 27.09,8.7 ; 27.29,8.83 27.52,8.88 ; 27.29,8.83 27.52,8.88 ; 27.29,8.83 27.09,8.7 ; 27.09,8.7 26.96,8.5 ; 27.09,8.7 26.96,8.5 ; 39.14,35.33 38.92,35.42 ; 39.14,35.33 39.29,35.26 ; 39.14,35.33 38.92,35.42 ; 39.14,35.33 39.29,35.26 ; 38.92,35.42 38.79,35.44 ; 38.92,35.42 38.79,35.44 ; 11.1,49.17 11.06,48.94 ; 11.1,49.17 11.06,48.94 ; 21.14,15.75 21.13,15.52 ; 21.14,15.75 21.13,15.52 ; 21.13,15.52 21.44,13.99 ; 21.13,15.52 21.44,13.99 ; 47.47,50.01 47.44,50.21 ; 47.47,50.01 47.47,40.79 ; 47.47,50.01 47.47,40.79 ; 47.47,50.01 47.44,50.21 ; 14.15,43.61 14.38,43.66 ; 14.15,43.61 14.38,43.66 ; 14.38,43.66 14.58,43.79 ; 14.38,43.66 14.58,43.79 ; 33.46,9.89 33.33,10.08 ; 33.46,9.89 33.33,10.08 ; 30.96,13.92 31.07,13.84 ; 30.96,13.92 31.07,13.84 ; 30.96,13.92 30.88,14.04 ; 30.96,13.92 30.88,14.04 ; 31.07,13.84 31.21,13.81 ; 31.07,13.84 31.21,13.81 ; 15.14,31.27 15.09,31.5 ; 15.14,31.27 15.09,31.5 ; 12.64,51.83 12.77,52.04 ; 12.64,51.83 12.45,51.69 ; 12.64,51.83 12.77,52.04 ; 12.64,51.83 12.45,51.69 ; 12.77,52.04 12.8,52.25 ; 12.77,52.04 12.8,52.25 ; 34.54,48.56 34.77,48.51 ; 34.54,48.56 34.34,48.69 ; 34.54,48.56 34.77,48.51 ; 34.54,48.56 34.34,48.69 ; 41.05,22.96 41.11,22.96 ; 41.05,22.96 41.11,22.96 ; 41.05,22.96 40.97,22.96 ; 41.05,22.96 40.97,22.96 ; 19.29,21.12 19.1,20.98 ; 19.29,21.12 19.2,21.15 ; 19.29,21.12 19.2,21.15 ; 19.29,21.12 19.1,20.98 ; 19.1,20.98 18.98,20.77 ; 19.1,20.98 18.98,20.77 ; 25.09,8.03 24.96,7.84 ; 25.09,8.03 24.96,7.84 ; 1.5,17.43 1.5,13.24 ; 1.5,17.43 1.5,13.24 ; 20.3,32.61 20.3,37.89 ; 20.3,32.61 20.3,37.89 ; 7.97,42.88 8.01,42.71 ; 7.97,42.88 7.97,47.65 ; 7.97,42.88 7.97,47.65 ; 7.97,42.88 8.01,42.71 ; 38.99,10.26 39.03,10.03 ; 38.99,10.26 39.03,10.5 ; 38.99,10.26 39.03,10.5 ; 38.99,10.26 39.03,10.03 ; 34.13,47.8 34.18,47.57 ; 34.13,47.8 34.18,48.04 ; 34.13,47.8 34.18,47.57 ; 34.13,47.8 34.18,48.04 ; 34.18,47.57 34.31,47.37 ; 34.18,47.57 34.31,47.37 ; 16.92,54.25 17.15,54.3 ; 16.92,54.25 17.15,54.3 ; 33.71,48.84 33.76,49.07 ; 33.71,48.84 33.58,48.64 ; 33.71,48.84 33.76,49.07 ; 33.71,48.84 33.58,48.64 ; 33.76,49.07 33.71,49.31 ; 33.76,49.07 33.71,49.31 ; 45.76,7.7 45.96,7.84 ; 45.76,7.7 45.96,7.84 ; 45.96,7.84 46.09,8.03 ; 45.96,7.84 46.09,8.03 ; 23.46,7.84 23.59,8.03 ; 23.46,7.84 23.26,7.7 ; 23.46,7.84 23.59,8.03 ; 23.46,7.84 23.26,7.7 ; 23.59,8.03 23.63,8.27 ; 23.59,8.03 23.63,8.27 ; 29.91,8.27 29.96,8.5 ; 29.91,8.27 29.96,8.5 ; 40.56,22.55 40.7,22.75 ; 40.56,22.55 40.7,22.75 ; 40.56,22.55 40.37,22.42 ; 40.56,22.55 40.37,22.42 ; 40.7,22.75 40.74,22.99 ; 40.7,22.75 40.74,22.99 ; 39.62,34.39 39.47,34.21 ; 39.62,34.39 39.47,34.21 ; 38.59,8.5 38.46,8.7 ; 38.59,8.5 38.46,8.7 ; 38.59,8.5 38.63,8.27 ; 38.59,8.5 38.63,8.27 ; 38.46,8.7 38.26,8.83 ; 38.46,8.7 38.26,8.83 ; 38.22,35.06 38.17,34.82 ; 38.22,35.06 38.17,34.82 ; 21.34,27.16 21.57,27.11 ; 21.34,27.16 21.57,27.11 ; 36.17,25.4 36.4,25.44 ; 36.17,25.4 36.4,25.44 ; 36.17,25.4 35.97,25.43 ; 36.17,25.4 35.97,25.43 ; 28.48,38.41 28.66,38.59 ; 28.48,38.41 28.66,38.59 ; 28.48,38.41 28.24,38.31 ; 28.48,38.41 28.24,38.31 ; 11.36,55.95 11.46,56 ; 11.36,55.95 11.46,56 ; 11.36,55.95 11.12,55.9 ; 11.36,55.95 11.12,55.9 ; 11.46,56 15.41,56 ; 11.46,56 15.41,56 ; 1.5,13.24 2.36,13.24 ; 1.5,13.24 2.36,13.24 ; 19.81,17.22 19.66,17.15 ; 19.81,17.22 19.66,17.15 ; 38.01,30.11 38,29.97 ; 38.01,30.11 38.11,30.32 ; 38.01,30.11 38,29.97 ; 38.01,30.11 38.11,30.32 ; 38,29.97 38.04,29.74 ; 38,29.97 38.04,29.74 ; 9.29,7.7 9.52,7.66 ; 9.29,7.7 9.52,7.66 ; 9.29,7.7 9.09,7.84 ; 9.29,7.7 9.09,7.84 ; 11.6,44.14 11.65,43.91 ; 11.6,44.14 11.63,44.3 ; 11.6,44.14 11.65,43.91 ; 11.6,44.14 11.63,44.3 ; 11.65,43.91 11.78,43.71 ; 11.65,43.91 11.78,43.71 ; 27.65,39.43 27.62,39.4 ; 27.65,39.43 27.86,39.58 ; 27.65,39.43 27.86,39.58 ; 27.65,39.43 27.62,39.4 ; 27.62,39.4 26.07,39.4 ; 27.62,39.4 26.07,39.4 ; 6.04,33.75 6.26,33.9 ; 6.04,33.75 6.26,33.9 ; 22.59,8.7 22.46,8.5 ; 22.59,8.7 22.79,8.83 ; 22.59,8.7 22.79,8.83 ; 22.59,8.7 22.46,8.5 ; 22.46,8.5 22.41,8.27 ; 22.46,8.5 22.41,8.27 ; 18.96,8.7 18.76,8.83 ; 18.96,8.7 19.09,8.5 ; 18.96,8.7 18.76,8.83 ; 18.96,8.7 19.09,8.5 ; 18.76,8.83 18.52,8.88 ; 18.76,8.83 18.52,8.88 ; 18.29,7.7 18.52,7.66 ; 18.29,7.7 18.52,7.66 ; 18.29,7.7 18.09,7.84 ; 18.29,7.7 18.09,7.84 ; 18.52,7.66 18.76,7.7 ; 18.52,7.66 18.76,7.7 ; 30.42,26.94 30.2,27.08 ; 30.42,26.94 30.2,27.08 ; 0.36,60.34 46,60.34 ; 0.36,60.34 0.36,18.06 ; 0.36,60.34 46,60.34 ; 0.36,60.34 0.36,18.06 ; 46,60.34 46,58.4 ; 46,60.34 46,58.4 ; 26.26,31.04 24.38,32.92 ; 26.26,31.04 24.38,32.92 ; 5.38,10.09 5.17,10.24 ; 5.38,10.09 5.17,10.24 ; 5.38,10.09 8.35,10.09 ; 5.38,10.09 8.35,10.09 ; 34.46,8.5 34.41,8.27 ; 34.46,8.5 34.41,8.27 ; 34.46,8.5 34.59,8.7 ; 34.46,8.5 34.59,8.7 ; 34.41,8.27 34.46,8.03 ; 34.41,8.27 34.46,8.03 ; 5.87,17.09 6.07,17.22 ; 5.87,17.09 6.07,17.22 ; 45.12,49.36 44.98,49.56 ; 45.12,49.36 44.98,49.56 ; 45.12,49.36 45.16,49.12 ; 45.12,49.36 45.16,49.12 ; 44.98,49.56 44.79,49.69 ; 44.98,49.56 44.79,49.69 ; 11.06,48.94 10.92,48.74 ; 11.06,48.94 10.92,48.74 ; 35,49.69 34.77,49.74 ; 35,49.69 35.2,49.56 ; 35,49.69 35.2,49.56 ; 35,49.69 34.77,49.74 ; 34.77,49.74 34.54,49.69 ; 34.77,49.74 34.54,49.69 ; 29.15,15.52 28.84,17.06 ; 29.15,15.52 28.84,17.06 ; 28.84,17.06 27.97,18.36 ; 28.84,17.06 27.97,18.36 ; 39.68,20.55 39.55,20.75 ; 39.68,20.55 39.73,20.32 ; 39.68,20.55 39.55,20.75 ; 39.68,20.55 39.73,20.32 ; 39.55,20.75 39.35,20.89 ; 39.55,20.75 39.35,20.89 ; 37.28,38.72 37.08,38.58 ; 37.28,38.72 37.08,38.58 ; 37.28,38.72 37.52,38.76 ; 37.28,38.72 37.52,38.76 ; 37.08,38.58 36.95,38.39 ; 37.08,38.58 36.95,38.39 ; 8.53,9.22 8.7,9.25 ; 8.53,9.22 5.38,9.22 ; 8.53,9.22 8.7,9.25 ; 8.53,9.22 5.38,9.22 ; 8.7,9.25 8.84,9.34 ; 8.7,9.25 8.84,9.34 ; 39.55,19.89 39.68,20.09 ; 39.55,19.89 39.68,20.09 ; 39.09,8.7 38.96,8.5 ; 39.09,8.7 38.96,8.5 ; 32.99,48.48 33.15,48.46 ; 32.99,48.48 33.15,48.46 ; 33.15,48.46 33.38,48.51 ; 33.15,48.46 33.38,48.51 ; 37.75,38.72 37.52,38.76 ; 37.75,38.72 37.95,38.58 ; 37.75,38.72 37.52,38.76 ; 37.75,38.72 37.95,38.58 ; 42.39,34.39 45.09,31.69 ; 42.39,34.39 40.38,34.39 ; 42.39,34.39 40.38,34.39 ; 42.39,34.39 45.09,31.69 ; 40.62,33.91 40.6,33.78 ; 40.62,33.91 40.6,33.78 ; 10.21,13.01 10.04,12.97 ; 10.21,13.01 16.1,13.01 ; 10.21,13.01 16.1,13.01 ; 10.21,13.01 10.04,12.97 ; 10.04,12.97 9.9,12.88 ; 10.04,12.97 9.9,12.88 ; 1.5,38.14 1.5,38.15 ; 1.5,38.14 1.5,18.28 ; 1.5,38.14 1.5,18.28 ; 1.5,38.14 1.5,38.15 ; 1.5,38.15 1.57,37.99 ; 1.5,38.15 1.57,37.99 ; 33.03,15.08 32.96,15 ; 33.03,15.08 32.96,15.15 ; 33.03,15.08 32.96,15 ; 33.03,15.08 32.96,15.15 ; 32.96,15 32.89,15.08 ; 32.96,15 32.89,15.08 ; 30.96,7.84 30.76,7.7 ; 30.96,7.84 30.76,7.7 ; 33.69,39.77 33.59,39.55 ; 33.69,39.77 33.75,39.93 ; 33.69,39.77 33.75,39.93 ; 33.69,39.77 33.59,39.55 ; 33.59,39.55 33.58,39.42 ; 33.59,39.55 33.58,39.42 ; 33.58,39.42 33.62,39.19 ; 33.58,39.42 33.62,39.19 ; 33.62,39.19 33.75,38.99 ; 33.62,39.19 33.75,38.99 ; 35.63,8.27 35.59,8.5 ; 35.63,8.27 35.59,8.03 ; 35.63,8.27 35.59,8.5 ; 35.63,8.27 35.59,8.03 ; 35.59,8.5 35.46,8.7 ; 35.59,8.5 35.46,8.7 ; 33,11.13 32.84,11.17 ; 33,11.13 32.84,11.17 ; 37.22,26 37.41,26.14 ; 37.22,26 37.41,26.14 ; 16.31,32.84 16.26,33.08 ; 16.31,32.84 16.26,33.08 ; 16.31,32.84 16.31,32.78 ; 16.31,32.84 16.31,32.78 ; 16.26,33.08 16.13,33.27 ; 16.26,33.08 16.13,33.27 ; 10.63,33.53 10.44,33.4 ; 10.63,33.53 10.44,33.4 ; 10.63,33.53 10.87,33.58 ; 10.63,33.53 10.87,33.58 ; 10.44,33.4 10.31,33.2 ; 10.44,33.4 10.31,33.2 ; 39.68,20.09 39.73,20.32 ; 39.68,20.09 39.73,20.32 ; 13.4,54.02 13.26,53.93 ; 13.4,54.02 13.56,54.05 ; 13.4,54.02 13.56,54.05 ; 13.4,54.02 13.26,53.93 ; 13.26,53.93 12.19,52.86 ; 13.26,53.93 12.19,52.86 ; 29.41,44.35 29.16,44.4 ; 29.41,44.35 29.16,44.4 ; 29.41,44.35 29.63,44.21 ; 29.41,44.35 29.63,44.21 ; 29.16,44.4 29.14,44.4 ; 29.16,44.4 29.14,44.4 ; 26.43,39.84 26.07,39.4 ; 26.43,39.84 26.07,39.4 ; 1.1,39.08 0.99,39.09 ; 1.1,39.08 0.99,39.09 ; 1.1,39.08 1.33,38.99 ; 1.1,39.08 1.33,38.99 ; 0.99,39.09 0.76,39.05 ; 0.99,39.09 0.76,39.05 ; 46.09,8.5 46.03,8.62 ; 46.09,8.5 46.03,8.62 ; 46.09,8.5 46.13,8.27 ; 46.09,8.5 46.13,8.27 ; 46.03,8.62 45.96,8.77 ; 46.03,8.62 45.96,8.77 ; 32.77,49.56 23.74,49.56 ; 32.77,49.56 32.91,49.64 ; 32.77,49.56 23.74,49.56 ; 32.77,49.56 32.91,49.64 ; 23.74,49.56 23.94,49.72 ; 23.74,49.56 23.94,49.72 ; 7.14,48.74 10.06,48.74 ; 7.14,48.74 6.53,48.13 ; 7.14,48.74 10.06,48.74 ; 7.14,48.74 6.53,48.13 ; 10.06,48.74 10.26,48.61 ; 10.06,48.74 10.26,48.61 ; 39.27,53.9 39.47,53.76 ; 39.27,53.9 36.77,53.9 ; 39.27,53.9 39.47,53.76 ; 39.27,53.9 36.77,53.9 ; 20.48,31.85 20.53,32.11 ; 20.48,31.85 20.33,31.64 ; 20.48,31.85 20.53,32.11 ; 20.48,31.85 20.33,31.64 ; 40.09,8.03 39.96,7.84 ; 40.09,8.03 39.96,7.84 ; 23.11,29.75 22.98,29.95 ; 23.11,29.75 22.98,29.95 ; 5.56,32.31 5.84,32.59 ; 5.56,32.31 5.84,32.59 ; 49.65,8.59 49.53,8.51 ; 49.65,8.59 49.53,8.51 ; 26.78,11.86 30.99,11.86 ; 26.78,11.86 30.99,11.86 ; 45.54,46.23 45.74,46.09 ; 45.54,46.23 45.41,46.42 ; 45.54,46.23 45.74,46.09 ; 45.54,46.23 45.41,46.42 ; 45.74,46.09 45.97,46.05 ; 45.74,46.09 45.97,46.05 ; 8.26,7.7 8.46,7.84 ; 8.26,7.7 8.46,7.84 ; 8.46,7.84 8.59,8.03 ; 8.46,7.84 8.59,8.03 ; 21.25,35.63 21.49,35.58 ; 21.25,35.63 21.06,35.76 ; 21.25,35.63 21.06,35.76 ; 21.25,35.63 21.49,35.58 ; 21.49,35.58 21.72,35.63 ; 21.49,35.58 21.72,35.63 ; 26.26,8.83 26.02,8.88 ; 26.26,8.83 26.46,8.7 ; 26.26,8.83 26.46,8.7 ; 26.26,8.83 26.02,8.88 ; 26.02,8.88 25.79,8.83 ; 26.02,8.88 25.79,8.83 ; 10.52,8.62 10.43,8.4 ; 10.52,8.62 10.43,8.4 ; 10.52,8.62 10.69,8.78 ; 10.52,8.62 10.69,8.78 ; 12.39,29.08 12.26,28.89 ; 12.39,29.08 12.59,29.22 ; 12.39,29.08 12.26,28.89 ; 12.39,29.08 12.59,29.22 ; 12.26,28.89 12.22,28.65 ; 12.26,28.89 12.22,28.65 ; 16.09,8.5 15.96,8.7 ; 16.09,8.5 15.96,8.7 ; 4.65,8.75 4.65,9.03 ; 4.65,8.75 4.79,8.83 ; 4.65,8.75 4.65,9.03 ; 4.65,8.75 4.79,8.83 ; 4.65,9.03 4.88,8.99 ; 4.65,9.03 4.88,8.99 ; 29.95,27.13 30.2,27.08 ; 29.95,27.13 30.2,27.08 ; 14.87,9.73 14.07,8.93 ; 14.87,9.73 14.07,8.93 ; 14.07,8.93 13.92,8.87 ; 14.07,8.93 13.92,8.87 ; 3.76,7.7 3.78,7.71 ; 3.76,7.7 3.52,7.66 ; 3.76,7.7 3.52,7.66 ; 3.76,7.7 3.78,7.71 ; 3.78,7.71 3.78,7.37 ; 3.78,7.71 3.78,7.37 ; 24.76,7.7 24.96,7.84 ; 24.76,7.7 24.96,7.84 ; 36.53,39.76 36.47,39.87 ; 36.53,39.76 36.47,39.87 ; 36.47,39.87 36.4,40.03 ; 36.47,39.87 36.4,40.03 ; 11,34.77 10.86,34.57 ; 11,34.77 10.86,34.57 ; 36.96,8.7 36.76,8.83 ; 36.96,8.7 36.76,8.83 ; 6.29,7.7 6.09,7.84 ; 6.29,7.7 6.09,7.84 ; 37.7,31.16 37.9,31.29 ; 37.7,31.16 37.47,31.11 ; 37.7,31.16 37.9,31.29 ; 37.7,31.16 37.47,31.11 ; 37.9,31.29 38.03,31.49 ; 37.9,31.29 38.03,31.49 ; 29.26,8.83 29.02,8.88 ; 29.26,8.83 29.46,8.7 ; 29.26,8.83 29.02,8.88 ; 29.26,8.83 29.46,8.7 ; 29.02,8.88 28.79,8.83 ; 29.02,8.88 28.79,8.83 ; 6.29,8.83 6.09,8.7 ; 6.29,8.83 6.52,8.88 ; 6.29,8.83 6.09,8.7 ; 6.29,8.83 6.52,8.88 ; 30.39,24.85 30.17,25 ; 30.39,24.85 30.17,25 ; 30.17,25 29.92,25.05 ; 30.17,25 29.92,25.05 ; 15.8,21.03 15.54,21.08 ; 15.8,21.03 16.01,20.89 ; 15.8,21.03 16.01,20.89 ; 15.8,21.03 15.54,21.08 ; 15.54,21.08 15.38,21.06 ; 15.54,21.08 15.38,21.06 ; 44.12,49.56 35.2,49.56 ; 44.12,49.56 44.32,49.69 ; 44.12,49.56 44.32,49.69 ; 44.12,49.56 35.2,49.56 ; 32.34,11.85 32.47,11.82 ; 32.34,11.85 32.47,11.82 ; 38.13,27.1 38.07,27.25 ; 38.13,27.1 38.07,27.25 ; 36.85,55.94 36.65,55.81 ; 36.85,55.94 36.65,55.81 ; 22.96,19.89 22.93,19.86 ; 22.96,19.89 22.93,19.86 ; 22.93,19.86 21.16,18.09 ; 22.93,19.86 21.16,18.09 ; 42.09,22.55 42.09,11.3 ; 42.09,22.55 42.09,11.3 ; 47.59,8.5 47.46,8.7 ; 47.59,8.5 47.46,8.7 ; 47.46,8.7 47.26,8.83 ; 47.46,8.7 47.26,8.83 ; 19.2,32.11 19.25,31.85 ; 19.2,32.11 19.25,31.85 ; 19.2,32.11 19.2,32.15 ; 19.2,32.11 19.2,32.15 ; 19.25,31.85 19.39,31.64 ; 19.25,31.85 19.39,31.64 ; 38.73,40.77 38.78,41 ; 38.73,40.77 38.78,41 ; 13.06,35.77 12.95,35.99 ; 13.06,35.77 20.67,43.39 ; 13.06,35.77 20.67,43.39 ; 13.06,35.77 12.95,35.99 ; 12.95,35.99 12.91,36.04 ; 12.95,35.99 12.91,36.04 ; 16.59,7.84 16.79,7.7 ; 16.59,7.84 16.46,8.03 ; 16.59,7.84 16.46,8.03 ; 16.59,7.84 16.79,7.7 ; 16.79,7.7 17.02,7.66 ; 16.79,7.7 17.02,7.66 ; 5.76,31.09 5.75,31.08 ; 5.76,31.09 5.75,31.08 ; 36.4,40.03 36.36,40.19 ; 36.4,40.03 36.36,40.19 ; 32.46,7.84 32.59,8.03 ; 32.46,7.84 32.59,8.03 ; 32.59,8.03 32.63,8.27 ; 32.59,8.03 32.63,8.27 ; 27.76,25.12 27.54,25.12 ; 27.76,25.12 27.54,25.12 ; 27.54,25.12 27.13,25.53 ; 27.54,25.12 27.13,25.53 ; 33.29,7.7 33.52,7.66 ; 33.29,7.7 33.52,7.66 ; 33.29,7.7 33.09,7.84 ; 33.29,7.7 33.09,7.84 ; 33.52,7.66 33.76,7.7 ; 33.52,7.66 33.76,7.7 ; 41.05,24.18 41.05,24.18 ; 41.05,24.18 41.05,24.18 ; 41.05,24.18 41.28,24.14 ; 41.05,24.18 41.28,24.14 ; 10.39,12.14 16.28,12.14 ; 10.39,12.14 9.45,11.2 ; 10.39,12.14 16.28,12.14 ; 10.39,12.14 9.45,11.2 ; 16.28,12.14 16.45,12.17 ; 16.28,12.14 16.45,12.17 ; 21.52,8.88 21.29,8.83 ; 21.52,8.88 21.29,8.83 ; 21.29,8.83 21.09,8.7 ; 21.29,8.83 21.09,8.7 ; 47.37,25.5 47.5,25.7 ; 47.37,25.5 47.17,25.37 ; 47.37,25.5 47.5,25.7 ; 47.37,25.5 47.17,25.37 ; 47.5,25.7 47.55,25.93 ; 47.5,25.7 47.55,25.93 ; 26.96,8.5 26.91,8.27 ; 26.96,8.5 26.91,8.27 ; 26.91,8.27 26.96,8.03 ; 26.91,8.27 26.96,8.03 ; 20.02,7.66 20.26,7.7 ; 20.02,7.66 20.26,7.7 ; 20.02,7.66 19.79,7.7 ; 20.02,7.66 19.79,7.7 ; 20.26,7.7 20.46,7.84 ; 20.26,7.7 20.46,7.84 ; 26.39,25.04 27.05,24.38 ; 26.39,25.04 27.05,24.38 ; 15.19,55.93 15.01,55.77 ; 15.19,55.93 15.41,56 ; 15.19,55.93 15.41,56 ; 15.19,55.93 15.01,55.77 ; 15.01,55.77 14.9,55.56 ; 15.01,55.77 14.9,55.56 ; 5.66,35.18 5.86,35.05 ; 5.66,35.18 5.53,35.38 ; 5.66,35.18 5.86,35.05 ; 5.66,35.18 5.53,35.38 ; 5.86,35.05 6.1,35 ; 5.86,35.05 6.1,35 ; 33.81,16.1 33.95,16.03 33.81,16.1 ; 33.81,16.1 33.59,16.32 ; 33.81,16.1 33.59,16.32 ; 22.79,8.83 23.02,8.88 ; 22.79,8.83 23.02,8.88 ; 15.26,54.83 15.49,54.78 ; 15.26,54.83 15.49,54.78 ; 15.26,54.83 15.06,54.96 ; 15.26,54.83 15.06,54.96 ; 15.49,54.78 15.73,54.83 ; 15.49,54.78 15.73,54.83 ; 12.8,52.25 13.74,53.19 ; 12.8,52.25 13.74,53.19 ; 46.45,41.28 39.68,41.28 ; 46.45,41.28 46.45,46.28 ; 46.45,41.28 39.68,41.28 ; 46.45,41.28 46.45,46.28 ; 39.68,41.28 39.46,41.37 ; 39.68,41.28 39.46,41.37 ; 20.93,38 20.7,37.95 ; 20.93,38 21.16,37.95 ; 20.93,38 20.7,37.95 ; 20.93,38 21.16,37.95 ; 20.7,37.95 20.5,37.82 ; 20.7,37.95 20.5,37.82 ; 30.99,11.86 31.14,12.02 ; 30.99,11.86 31.14,12.02 ; 23.02,7.66 23.26,7.7 ; 23.02,7.66 22.79,7.7 ; 23.02,7.66 23.26,7.7 ; 23.02,7.66 22.79,7.7 ; 27.13,25.53 27.13,31.22 ; 27.13,25.53 27.13,31.22 ; 45.02,8.62 44.93,8.4 ; 45.02,8.62 45.09,8.77 ; 45.02,8.62 45.09,8.77 ; 45.02,8.62 44.93,8.4 ; 44.93,8.4 44.91,8.27 ; 44.93,8.4 44.91,8.27 ; 40.6,33.78 40.51,33.56 ; 40.6,33.78 40.51,33.56 ; 28.79,8.83 28.59,8.7 ; 28.79,8.83 28.59,8.7 ; 28.59,8.7 28.46,8.5 ; 28.59,8.7 28.46,8.5 ; 18.87,18.09 18.74,17.89 ; 18.87,18.09 19.07,18.22 ; 18.87,18.09 19.07,18.22 ; 18.87,18.09 18.74,17.89 ; 25.53,34.91 25.73,34.87 ; 25.53,34.91 25.73,34.87 ; 7.09,8.5 6.96,8.7 ; 7.09,8.5 7.14,8.27 ; 7.09,8.5 7.14,8.27 ; 7.09,8.5 6.96,8.7 ; 6.96,8.7 6.76,8.83 ; 6.96,8.7 6.76,8.83 ; 30.53,7.66 30.76,7.7 ; 30.53,7.66 30.76,7.7 ; 30.53,7.66 30.24,7.37 ; 30.53,7.66 30.24,7.37 ; 46.45,46.28 46.41,46.23 ; 46.45,46.28 46.41,46.23 ; 37.68,55.25 37.7,55.37 ; 37.68,55.25 37.7,55.37 ; 44.55,48.51 44.79,48.56 ; 44.55,48.51 44.32,48.56 ; 44.55,48.51 44.79,48.56 ; 44.55,48.51 44.32,48.56 ; 37.95,27.02 38.04,27.24 ; 37.95,27.02 38.04,27.24 ; 37.95,27.02 37.78,26.85 ; 37.95,27.02 37.78,26.85 ; 38.04,27.24 38.05,27.28 ; 38.04,27.24 38.05,27.28 ; 39.6,10.87 39.36,10.83 ; 39.6,10.87 39.67,10.87 ; 39.6,10.87 39.67,10.87 ; 39.6,10.87 39.36,10.83 ; 39.36,10.83 39.17,10.69 ; 39.36,10.83 39.17,10.69 ; 33.52,8.88 33.29,8.83 ; 33.52,8.88 33.76,8.83 ; 33.52,8.88 33.29,8.83 ; 33.52,8.88 33.76,8.83 ; 33.29,8.83 33.09,8.7 ; 33.29,8.83 33.09,8.7 ; 5.15,29.73 5.09,29.57 ; 5.15,29.73 5.09,29.57 ; 19.81,18.09 19.66,18.16 ; 19.81,18.09 19.66,18.16 ; 19.81,18.09 21.16,18.09 ; 19.81,18.09 21.16,18.09 ; 19.66,18.16 19.44,18.25 ; 19.66,18.16 19.44,18.25 ; 3.09,8.7 2.96,8.5 ; 3.09,8.7 2.96,8.5 ; 2.96,8.5 2.91,8.27 ; 2.96,8.5 2.91,8.27 ; 45.09,25.41 45.09,8.77 ; 45.09,25.41 45.09,8.77 ; 43.41,8.27 43.46,8.03 ; 43.41,8.27 43.46,8.5 ; 43.41,8.27 43.46,8.5 ; 43.41,8.27 43.46,8.03 ; 43.46,8.03 43.59,7.84 ; 43.46,8.03 43.59,7.84 ; 41.66,23.57 41.61,23.81 ; 41.66,23.57 41.61,23.81 ; 19.39,31.64 19.61,31.49 ; 19.39,31.64 19.61,31.49 ; 32.18,12.45 31.98,12.58 ; 32.18,12.45 31.98,12.58 ; 31.98,12.58 31.75,12.63 ; 31.98,12.58 31.75,12.63 ; 16.96,49.52 16.8,49.42 ; 16.96,49.52 17.15,49.56 ; 16.96,49.52 16.8,49.42 ; 16.96,49.52 17.15,49.56 ; 46.46,8.03 46.59,7.84 ; 46.46,8.03 46.41,8.27 ; 46.46,8.03 46.59,7.84 ; 46.46,8.03 46.41,8.27 ; 46.59,7.84 46.79,7.7 ; 46.59,7.84 46.79,7.7 ; 11.02,7.66 11.26,7.7 ; 11.02,7.66 11.26,7.7 ; 11.02,7.66 10.79,7.7 ; 11.02,7.66 10.79,7.7 ; 11.26,7.7 11.46,7.84 ; 11.26,7.7 11.46,7.84 ; 28.46,8.5 28.41,8.27 ; 28.46,8.5 28.41,8.27 ; 28.41,8.27 28.46,8.03 ; 28.41,8.27 28.46,8.03 ; 5.53,35.38 5.48,35.61 ; 5.53,35.38 5.48,35.61 ; 38.64,55.38 38.41,55.42 ; 38.64,55.38 38.84,55.25 ; 38.64,55.38 38.84,55.25 ; 38.64,55.38 38.41,55.42 ; 5.51,28.22 5.75,28.26 ; 5.51,28.22 5.75,28.26 ; 29.96,8.5 30.09,8.7 ; 29.96,8.5 30.09,8.7 ; 41.08,42.37 40.95,42.57 ; 41.08,42.37 40.95,42.57 ; 40.95,42.57 40.75,42.7 ; 40.95,42.57 40.75,42.7 ; 49.43,7.37 30.24,7.37 ; 49.43,7.37 30.24,7.37 ; 42.29,8.83 42.52,8.88 ; 42.29,8.83 42.52,8.88 ; 32.96,8.03 33.09,7.84 ; 32.96,8.03 32.91,8.27 ; 32.96,8.03 33.09,7.84 ; 32.96,8.03 32.91,8.27 ; 23.67,51.01 23.47,50.8 ; 23.67,51.01 23.47,50.8 ; 23.47,50.8 23.42,50.8 ; 23.47,50.8 23.42,50.8 ; 5.28,31.08 5.51,31.04 ; 5.28,31.08 5.08,31.22 ; 5.28,31.08 5.51,31.04 ; 5.28,31.08 5.08,31.22 ; 5.51,31.04 5.75,31.08 ; 5.51,31.04 5.75,31.08 ; 37.35,15.66 37.42,15.73 ; 37.35,15.66 37.42,15.73 ; 37.42,15.73 37.57,15.81 ; 37.42,15.73 37.57,15.81 ; 40.13,53.9 40.27,54.1 ; 40.13,53.9 40.27,54.1 ; 8.02,8.88 7.79,8.83 ; 8.02,8.88 7.79,8.83 ; 8.02,8.88 8.26,8.83 ; 8.02,8.88 8.26,8.83 ; 7.79,8.83 7.59,8.7 ; 7.79,8.83 7.59,8.7 ; 32.63,8.27 32.59,8.5 ; 32.63,8.27 32.59,8.5 ; 2.64,8.27 2.59,8.5 ; 2.64,8.27 2.59,8.03 ; 2.64,8.27 2.59,8.03 ; 2.64,8.27 2.59,8.5 ; 6.26,34.83 6.4,34.62 ; 6.26,34.83 6.4,34.62 ; 11.96,8.03 12.09,7.84 ; 11.96,8.03 12.09,7.84 ; 1.12,8.89 1.12,7.37 ; 1.12,8.89 1.12,7.37 ; 24.08,50.14 24.08,50.19 ; 24.08,50.14 24.06,49.95 ; 24.08,50.14 24.06,49.95 ; 24.08,50.14 24.08,50.19 ; 22.38,24.01 21.77,24.61 ; 22.38,24.01 21.77,24.61 ; 22.38,24.01 23.2,24.01 ; 22.38,24.01 23.2,24.01 ; 1.5,18.28 1.6,18.11 ; 1.5,18.28 1.6,18.11 ; 22.43,36.81 22.45,36.63 ; 22.43,36.81 22.45,36.63 ; 36.83,53.62 36.79,53.85 ; 36.83,53.62 36.79,53.85 ; 36.83,53.62 36.79,53.38 ; 36.83,53.62 36.79,53.38 ; 36.79,53.85 36.77,53.9 ; 36.79,53.85 36.77,53.9 ; 12.78,43.91 12.82,44.07 ; 12.78,43.91 12.65,43.71 ; 12.78,43.91 12.82,44.07 ; 12.78,43.91 12.65,43.71 ; 47.5,26.17 47.47,26.23 ; 47.5,26.17 47.47,26.23 ; 47.5,26.17 47.55,25.93 ; 47.5,26.17 47.55,25.93 ; 47.47,26.23 47.47,40.79 ; 47.47,26.23 47.47,40.79 ; 27.76,7.7 27.96,7.84 ; 27.76,7.7 27.96,7.84 ; 27.76,7.7 27.52,7.66 ; 27.76,7.7 27.52,7.66 ; 27.96,7.84 28.09,8.03 ; 27.96,7.84 28.09,8.03 ; 5.11,12.69 5,12.7 ; 5.11,12.69 5.1,12.78 ; 5.11,12.69 5.1,12.78 ; 5.11,12.69 5,12.7 ; 5,12.7 4.75,12.65 ; 5,12.7 4.75,12.65 ; 14.88,55.4 14.93,55.16 ; 14.88,55.4 14.9,55.56 ; 14.88,55.4 14.93,55.16 ; 14.88,55.4 14.9,55.56 ; 14.93,55.16 15.06,54.96 ; 14.93,55.16 15.06,54.96 ; 29.77,43.99 29.63,44.21 ; 29.77,43.99 29.63,44.21 ; 6.66,35.38 6.53,35.18 ; 6.66,35.38 6.53,35.18 ; 44.79,49.69 44.55,49.74 ; 44.79,49.69 44.55,49.74 ; 44.55,49.74 44.32,49.69 ; 44.55,49.74 44.32,49.69 ; 12.09,7.84 12.29,7.7 ; 12.09,7.84 12.29,7.7 ; 44.32,48.56 44.12,48.69 ; 44.32,48.56 44.12,48.69 ; 22.77,51.73 22.55,51.87 ; 22.77,51.73 22.91,51.51 ; 22.77,51.73 22.55,51.87 ; 22.77,51.73 22.91,51.51 ; 34.71,38.76 34.53,38.91 ; 34.71,38.76 34.53,38.91 ; 20.06,22.68 39.57,22.68 ; 20.06,22.68 39.57,22.68 ; 39.57,22.68 39.62,22.65 ; 39.57,22.68 39.62,22.65 ; 28.75,26.54 28.89,26.74 ; 28.75,26.54 28.89,26.74 ; 3.09,7.84 3.29,7.7 ; 3.09,7.84 2.96,8.03 ; 3.09,7.84 2.96,8.03 ; 3.09,7.84 3.29,7.7 ; 3.29,7.7 3.52,7.66 ; 3.29,7.7 3.52,7.66 ; 35.26,7.7 35.46,7.84 ; 35.26,7.7 35.46,7.84 ; 35.26,7.7 35.02,7.66 ; 35.26,7.7 35.02,7.66 ; 35.46,7.84 35.59,8.03 ; 35.46,7.84 35.59,8.03 ; 19.89,16.79 16.1,13.01 ; 19.89,16.79 19.89,16.84 ; 19.89,16.79 19.89,16.84 ; 19.89,16.79 16.1,13.01 ; 31.38,15.88 31.46,15.73 ; 31.38,15.88 31.46,15.73 ; 31.38,15.88 31.38,16.03 ; 31.38,15.88 31.38,16.03 ; 12.91,38.81 12.91,36.04 ; 12.91,38.81 12.91,36.04 ; 20.93,36.78 21.16,36.82 ; 20.93,36.78 20.93,36.78 ; 20.93,36.78 20.93,36.78 ; 20.93,36.78 21.16,36.82 ; 34.42,38.86 34.53,38.91 ; 34.42,38.86 34.53,38.91 ; 34.42,38.86 34.19,38.81 ; 34.42,38.86 34.19,38.81 ; 33.71,49.31 33.58,49.51 ; 33.71,49.31 33.58,49.51 ; 11.63,52.01 11.76,51.81 ; 11.63,52.01 11.76,51.81 ; 11.63,52.01 11.58,52.25 ; 11.63,52.01 11.58,52.25 ; 11.76,51.81 11.94,51.69 ; 11.76,51.81 11.94,51.69 ; 24.15,33.3 24.19,33.13 ; 24.15,33.3 24.15,35.01 ; 24.15,33.3 24.19,33.13 ; 24.15,33.3 24.15,35.01 ; 24.19,33.13 24.28,32.99 ; 24.19,33.13 24.28,32.99 ; 21.92,36.63 21.72,36.76 ; 21.92,36.63 22.45,36.63 ; 21.92,36.63 21.72,36.76 ; 21.92,36.63 22.45,36.63 ; 19.59,8.7 19.79,8.83 ; 19.59,8.7 19.79,8.83 ; 26.39,47.15 26.39,47.19 ; 26.39,47.15 29.14,44.4 ; 26.39,47.15 26.39,47.19 ; 26.39,47.15 29.14,44.4 ; 1.5,49.58 1.5,38.83 ; 1.5,49.58 1.53,49.75 ; 1.5,49.58 1.53,49.75 ; 1.5,49.58 1.5,38.83 ; 1.5,38.83 1.33,38.99 ; 1.5,38.83 1.33,38.99 ; 31.7,24.61 31.57,24.42 ; 31.7,24.61 31.9,24.75 ; 31.7,24.61 31.9,24.75 ; 31.7,24.61 31.57,24.42 ; 26.59,8.5 26.46,8.7 ; 26.59,8.5 26.63,8.27 ; 26.59,8.5 26.46,8.7 ; 26.59,8.5 26.63,8.27 ; 22.93,24.54 22.98,24.28 ; 22.93,24.54 22.98,24.28 ; 22.98,24.28 23.13,24.07 ; 22.98,24.28 23.13,24.07 ; 25.12,46.94 25.26,46.72 ; 25.12,46.94 25.07,47.19 ; 25.12,46.94 25.07,47.19 ; 25.12,46.94 25.26,46.72 ; 25.26,46.72 25.48,46.58 ; 25.26,46.72 25.48,46.58 ; 30.76,8.83 30.52,8.88 ; 30.76,8.83 30.52,8.88 ; 30.52,8.88 30.29,8.83 ; 30.52,8.88 30.29,8.83 ; 32.96,15.15 32.89,15.08 ; 32.96,15.15 32.89,15.08 ; 38.68,27.87 28.24,38.31 ; 38.68,27.87 28.24,38.31 ; 28.09,8.5 27.96,8.7 ; 28.09,8.5 27.96,8.7 ; 28.09,8.5 28.13,8.27 ; 28.09,8.5 28.13,8.27 ; 27.96,8.7 27.76,8.83 ; 27.96,8.7 27.76,8.83 ; 28.81,24.69 28.76,24.92 ; 28.81,24.69 28.76,24.45 ; 28.81,24.69 28.76,24.45 ; 28.81,24.69 28.76,24.92 ; 15.5,19.76 15.54,19.76 ; 15.5,19.76 15.54,19.76 ; 34.54,49.69 34.34,49.56 ; 34.54,49.69 34.34,49.56 ; 39.9,10.79 39.67,10.87 ; 39.9,10.79 39.67,10.87 ; 5.53,35.84 5.48,35.61 ; 5.53,35.84 5.66,36.04 ; 5.53,35.84 5.48,35.61 ; 5.53,35.84 5.66,36.04 ; 6.1,35 6.33,35.05 ; 6.1,35 6.33,35.05 ; 6.33,35.05 6.53,35.18 ; 6.33,35.05 6.53,35.18 ; 33.23,10.16 33.35,10.37 ; 33.23,10.16 33.35,10.37 ; 33.23,10.16 33.33,10.08 ; 33.23,10.16 33.33,10.08 ; 33.35,10.37 33.38,10.57 ; 33.35,10.37 33.38,10.57 ; 5.02,7.66 5.26,7.7 ; 5.02,7.66 5.26,7.7 ; 5.02,7.66 4.87,7.68 ; 5.02,7.66 4.87,7.68 ; 5.26,7.7 5.46,7.84 ; 5.26,7.7 5.46,7.84 ; 19.54,17.09 19.66,17.15 ; 19.54,17.09 19.66,17.15 ; 33.76,7.7 33.96,7.84 ; 33.76,7.7 33.96,7.84 ; 33.96,7.84 34.09,8.03 ; 33.96,7.84 34.09,8.03 ; 44.83,48.24 35.18,48.24 ; 44.83,48.24 45,48.2 ; 44.83,48.24 45,48.2 ; 44.83,48.24 35.18,48.24 ; 39.62,22.65 39.79,22.48 ; 39.62,22.65 39.79,22.48 ; 39.79,22.48 40.01,22.39 ; 39.79,22.48 40.01,22.39 ; 33.38,48.51 33.58,48.64 ; 33.38,48.51 33.58,48.64 ; 29.33,26.72 29.28,26.47 ; 29.33,26.72 29.28,26.47 ; 13.69,8.78 13.52,8.62 ; 13.69,8.78 13.92,8.87 ; 13.69,8.78 13.92,8.87 ; 13.69,8.78 13.52,8.62 ; 13.52,8.62 13.43,8.4 ; 13.52,8.62 13.43,8.4 ; 10.89,57.08 10.69,56.95 ; 10.89,57.08 10.69,56.95 ; 10.89,57.08 11.12,57.13 ; 10.89,57.08 11.12,57.13 ; 40.13,22.38 40.37,22.42 ; 40.13,22.38 40.01,22.39 ; 40.13,22.38 40.01,22.39 ; 40.13,22.38 40.37,22.42 ; 37.23,31.16 37.47,31.11 ; 37.23,31.16 37.03,31.29 ; 37.23,31.16 37.03,31.29 ; 37.23,31.16 37.47,31.11 ; 22.79,7.7 22.59,7.84 ; 22.79,7.7 22.59,7.84 ; 27.96,24.12 27.76,24.25 ; 27.96,24.12 27.76,24.25 ; 39.6,21.41 39.8,21.54 ; 39.6,21.41 39.37,21.36 ; 39.6,21.41 39.37,21.36 ; 39.6,21.41 39.8,21.54 ; 19.09,8.03 19.13,8.27 ; 19.09,8.03 18.96,7.84 ; 19.09,8.03 18.96,7.84 ; 19.09,8.03 19.13,8.27 ; 19.13,8.27 19.09,8.5 ; 19.13,8.27 19.09,8.5 ; 38.55,34.26 38.79,34.21 ; 38.55,34.26 38.79,34.21 ; 38.79,34.21 39.02,34.26 ; 38.79,34.21 39.02,34.26 ; 34.31,48.24 34.18,48.04 ; 34.31,48.24 34.51,48.37 ; 34.31,48.24 34.18,48.04 ; 34.31,48.24 34.51,48.37 ; 33.75,39.93 33.75,39.98 ; 33.75,39.93 33.75,39.98 ; 30.88,16.85 30.85,16.71 ; 30.88,16.85 30.96,16.97 ; 30.88,16.85 30.96,16.97 ; 30.88,16.85 30.85,16.71 ; 30.85,16.71 30.85,14.17 ; 30.85,16.71 30.85,14.17 ; 7.59,8.7 7.46,8.5 ; 7.59,8.7 7.46,8.5 ; 9.19,8.78 9.02,8.62 ; 9.19,8.78 9.42,8.87 ; 9.19,8.78 9.02,8.62 ; 9.19,8.78 9.42,8.87 ; 9.02,8.62 8.93,8.4 ; 9.02,8.62 8.93,8.4 ; 12.8,31.37 12.8,31.37 ; 12.8,31.37 12.8,31.37 ; 12.8,31.37 12.66,31.27 ; 12.8,31.37 12.66,31.27 ; 39.88,43.39 40.51,42.75 ; 39.88,43.39 40.51,42.75 ; 21.8,51.69 12.45,51.69 ; 21.8,51.69 21.83,51.73 ; 21.8,51.69 12.45,51.69 ; 21.8,51.69 21.83,51.73 ; 3.55,8.88 3.78,8.82 ; 3.55,8.88 3.78,8.82 ; 22.98,29.95 22.93,30.2 ; 22.98,29.95 22.93,30.2 ; 11,33.91 11.11,33.82 ; 11,33.91 11.11,33.82 ; 11.11,33.82 10.87,33.58 ; 11.11,33.82 10.87,33.58 ; 6.07,17.22 6.2,17.42 ; 6.07,17.22 6.2,17.42 ; 6.2,17.42 6.25,17.65 ; 6.2,17.42 6.25,17.65 ; 21.16,37.95 21.36,37.82 ; 21.16,37.95 21.36,37.82 ; 28.59,7.84 28.79,7.7 ; 28.59,7.84 28.46,8.03 ; 28.59,7.84 28.79,7.7 ; 28.59,7.84 28.46,8.03 ; 28.79,7.7 29.02,7.66 ; 28.79,7.7 29.02,7.66 ; 5.08,29.49 5.08,29.26 ; 5.08,29.49 5.09,29.57 ; 5.08,29.49 5.09,29.57 ; 5.08,29.49 5.08,29.26 ; 5.08,29.26 4.94,29.06 ; 5.08,29.26 4.94,29.06 ; 44.59,8.03 44.63,8.27 ; 44.59,8.03 44.63,8.27 ; 32.91,49.64 33.15,49.69 ; 32.91,49.64 33.15,49.69 ; 16.68,55.43 16.48,55.3 ; 16.68,55.43 16.48,55.3 ; 36.4,39.09 36.2,38.96 ; 36.4,39.09 36.2,38.96 ; 8.58,10.31 8.35,10.09 ; 8.58,10.31 8.35,10.09 ; 8.58,10.31 8.58,11.38 ; 8.58,10.31 8.58,11.38 ; 19.86,31.44 20.12,31.49 ; 19.86,31.44 20.12,31.49 ; 19.86,31.44 19.61,31.49 ; 19.86,31.44 19.61,31.49 ; 20.12,31.49 20.33,31.64 ; 20.12,31.49 20.33,31.64 ; 14.68,23.04 14.64,23.27 ; 14.68,23.04 14.64,22.8 ; 14.68,23.04 14.64,23.27 ; 14.68,23.04 14.64,22.8 ; 14.64,23.27 14.57,23.39 ; 14.64,23.27 14.57,23.39 ; 44.49,26.47 44.3,26.34 ; 44.49,26.47 44.3,26.34 ; 44.49,26.47 44.73,26.52 ; 44.49,26.47 44.73,26.52 ; 44.3,26.34 44.16,26.14 ; 44.3,26.34 44.16,26.14 ; 20.36,37.62 20.5,37.82 ; 20.36,37.62 20.5,37.82 ; 26.49,41.08 26.29,41.42 ; 26.49,41.08 26.29,41.42 ; 26.29,41.42 32.31,41.42 ; 26.29,41.42 32.31,41.42 ; 38.41,19.07 38.54,19.27 ; 38.41,19.07 38.21,18.94 ; 38.41,19.07 38.54,19.27 ; 38.41,19.07 38.21,18.94 ; 38.54,19.27 38.59,19.51 ; 38.54,19.27 38.59,19.51 ; 31.21,13.81 39.98,13.81 ; 31.21,13.81 39.98,13.81 ; 27.75,27.21 27.71,26.97 ; 27.75,27.21 27.71,26.97 ; 41.46,7.84 41.59,8.03 ; 41.46,7.84 41.59,8.03 ; 41.46,7.84 41.26,7.7 ; 41.46,7.84 41.26,7.7 ; 41.59,8.03 41.63,8.27 ; 41.59,8.03 41.63,8.27 ; 40.31,16.85 40.23,16.97 ; 40.31,16.85 40.23,16.97 ; 40.23,16.97 40.12,17.04 ; 40.23,16.97 40.12,17.04 ; 35.57,39.06 35.77,38.94 ; 35.57,39.06 35.77,38.94 ; 35.77,38.94 35.97,38.91 ; 35.77,38.94 35.97,38.91 ; 27.36,24.25 27.76,24.25 ; 27.36,24.25 27.19,24.29 ; 27.36,24.25 27.76,24.25 ; 27.36,24.25 27.19,24.29 ; 18.68,19.27 18.58,19.06 ; 18.68,19.27 18.58,19.06 ; 18.68,19.27 18.85,19.44 ; 18.68,19.27 18.85,19.44 ; 18.58,19.06 18.56,18.92 ; 18.58,19.06 18.56,18.92 ; 46.45,26.31 46.45,40.26 ; 46.45,26.31 46.45,40.26 ; 4.65,7.37 4.65,7.78 ; 4.65,7.37 4.65,7.78 ; 4.65,7.78 4.87,7.68 ; 4.65,7.78 4.87,7.68 ; 33.59,16.32 33.59,14.78 33.59,16.32 ; 14.99,32.8 15.04,32.56 ; 14.99,32.8 15.04,32.56 ; 7.84,47.85 7.97,47.65 ; 7.84,47.85 7.8,48.08 ; 7.84,47.85 7.97,47.65 ; 7.84,47.85 7.8,48.08 ; 32.26,16.03 32.19,16.17 ; 32.26,16.03 32.26,15.95 32.26,16.03 ; 32.26,16.03 32.19,16.17 ; 32.19,16.17 32.11,16.25 ; 32.19,16.17 32.11,16.25 ; 28.63,24.26 28.76,24.45 ; 28.63,24.26 28.76,24.45 ; 31.14,12.02 31.18,12.25 ; 31.14,12.02 31.18,12.25 ; 38.05,27.28 38.07,27.25 ; 38.05,27.28 38.07,27.25 ; 26.59,8.03 26.63,8.27 ; 26.59,8.03 26.46,7.84 ; 26.59,8.03 26.46,7.84 ; 26.59,8.03 26.63,8.27 ; 37.59,26.57 37.56,26.76 ; 37.59,26.57 37.56,26.76 ; 37.59,26.57 37.55,26.33 ; 37.59,26.57 37.55,26.33 ; 37.56,26.76 37.78,26.85 ; 37.56,26.76 37.78,26.85 ; 11.73,44.52 11.63,44.3 ; 11.73,44.52 11.63,44.3 ; 5.98,32.69 5.84,32.59 ; 5.98,32.69 5.84,32.59 ; 5.98,32.69 6.15,32.72 ; 5.98,32.69 6.15,32.72 ; 39.12,20.93 39.07,20.93 ; 39.12,20.93 39.35,20.89 ; 39.12,20.93 39.07,20.93 ; 39.12,20.93 39.35,20.89 ; 39.07,20.93 39.09,21.08 ; 39.07,20.93 39.09,21.08 ; 12.29,7.7 12.52,7.66 ; 12.29,7.7 12.52,7.66 ; 12.52,7.66 12.76,7.7 ; 12.52,7.66 12.76,7.7 ; 15.29,7.7 15.09,7.84 ; 15.29,7.7 15.09,7.84 ; 37.08,32.2 36.93,32.02 ; 37.08,32.2 37.08,37.72 ; 37.08,32.2 36.93,32.02 ; 37.08,32.2 37.08,37.72 ; 36.93,32.02 36.86,31.79 ; 36.93,32.02 36.86,31.79 ; 33.09,8.7 32.96,8.5 ; 33.09,8.7 32.96,8.5 ; 32.96,8.5 32.91,8.27 ; 32.96,8.5 32.91,8.27 ; 32.31,41.42 33.75,39.98 ; 32.31,41.42 33.75,39.98 ; 24.12,35.04 24.15,35.01 ; 24.12,35.04 24.15,35.01 ; 24.12,35.04 23.97,35.25 ; 24.12,35.04 23.97,35.25 ; 13.14,11 11.07,8.93 ; 13.14,11 12.87,11 ; 13.14,11 12.87,11 ; 13.14,11 11.07,8.93 ; 11.07,8.93 10.92,8.87 ; 11.07,8.93 10.92,8.87 ; 11.46,7.84 11.59,8.03 ; 11.46,7.84 11.59,8.03 ; 14.07,44.83 13.84,44.75 ; 14.07,44.83 13.84,44.75 ; 13.84,44.75 13.66,44.59 ; 13.84,44.75 13.66,44.59 ; 6.08,29.06 5.95,29.26 ; 6.08,29.06 6.12,28.83 ; 6.08,29.06 6.12,28.83 ; 6.08,29.06 5.95,29.26 ; 5.95,29.26 5.95,29.31 ; 5.95,29.26 5.95,29.31 ; 0.76,39.05 0.56,38.91 ; 0.76,39.05 0.56,38.91 ; 13.41,8.27 13.46,8.03 ; 13.41,8.27 13.46,8.03 ; 13.41,8.27 13.43,8.4 ; 13.41,8.27 13.43,8.4 ; 13.46,8.03 13.59,7.84 ; 13.46,8.03 13.59,7.84 ; 32.94,48.37 32.8,48.29 ; 32.94,48.37 33.17,48.42 ; 32.94,48.37 32.8,48.29 ; 32.94,48.37 33.17,48.42 ; 29.46,7.84 29.59,8.03 ; 29.46,7.84 29.59,8.03 ; 29.46,7.84 29.26,7.7 ; 29.46,7.84 29.26,7.7 ; 28.89,26.74 28.93,26.97 ; 28.89,26.74 28.93,26.97 ; 28.93,26.97 28.89,27.21 ; 28.93,26.97 28.89,27.21 ; 21.96,38.33 22.09,38.53 ; 21.96,38.33 22.09,38.53 ; 15.26,33.27 15.13,33.08 ; 15.26,33.27 15.13,33.08 ; 15.26,33.27 15.46,33.41 ; 15.26,33.27 15.46,33.41 ; 15.13,33.08 15.09,32.84 ; 15.13,33.08 15.09,32.84 ; 13.56,54.05 17.4,54.05 ; 13.56,54.05 17.4,54.05 ; 35.62,25.74 35.77,25.55 ; 35.62,25.74 35.77,25.55 ; 35.77,25.55 35.97,25.43 ; 35.77,25.55 35.97,25.43 ; 34.21,48.89 34.34,48.69 ; 34.21,48.89 34.34,48.69 ; 34.21,48.89 34.16,49.12 ; 34.21,48.89 34.16,49.12 ; 3.78,7.37 1.12,7.37 ; 3.78,7.37 1.12,7.37 ; 37.55,19.07 37.75,18.94 ; 37.55,19.07 37.75,18.94 ; 37.75,18.94 37.97,18.89 ; 37.75,18.94 37.97,18.89 ; 15.21,23.71 15.21,23.09 ; 15.21,23.71 15.21,23.09 ; 15.21,23.09 5.45,13.33 ; 15.21,23.09 5.45,13.33 ; 39.37,21.36 39.24,21.37 ; 39.37,21.36 39.24,21.37 ; 33.76,8.83 33.96,8.7 ; 33.76,8.83 33.96,8.7 ; 35.97,38.91 36.2,38.96 ; 35.97,38.91 36.2,38.96 ; 6.26,33.9 6.4,34.11 ; 6.26,33.9 6.4,34.11 ; 15.09,8.7 15.29,8.83 ; 15.09,8.7 15.29,8.83 ; 5.07,17.89 5.03,17.65 ; 5.07,17.89 5.03,17.65 ; 5.07,17.89 5.21,18.09 ; 5.07,17.89 5.21,18.09 ; 5.03,17.65 5.07,17.42 ; 5.03,17.65 5.07,17.42 ; 37.03,31.29 36.9,31.49 ; 37.03,31.29 36.9,31.49 ; 39.17,10.69 39.03,10.5 ; 39.17,10.69 39.03,10.5 ; 39.34,40.16 39.11,40.2 ; 39.34,40.16 39.11,40.2 ; 40.31,14.04 40.23,13.92 ; 40.31,14.04 40.23,13.92 ; 35.26,8.83 35.02,8.88 ; 35.26,8.83 35.46,8.7 ; 35.26,8.83 35.02,8.88 ; 35.26,8.83 35.46,8.7 ; 35.02,8.88 34.79,8.83 ; 35.02,8.88 34.79,8.83 ; 5.95,29.31 7.88,31.24 ; 5.95,29.31 7.88,31.24 ; 39.05,21.32 38.91,21.52 ; 39.05,21.32 39.09,21.08 ; 39.05,21.32 38.91,21.52 ; 39.05,21.32 39.09,21.08 ; 38.91,21.52 39.02,21.47 ; 38.91,21.52 39.02,21.47 ; 0.52,10.83 0.63,10.66 ; 0.52,10.83 0.63,10.66 ; 19.12,23.55 18.99,23.35 ; 19.12,23.55 18.99,23.35 ; 4.95,28.59 4.9,28.83 ; 4.95,28.59 4.9,28.83 ; 22.76,50.14 22.81,50.39 ; 22.76,50.14 22.81,50.39 ; 34.46,8.03 34.59,7.84 ; 34.46,8.03 34.59,7.84 ; 29.02,7.66 29.26,7.7 ; 29.02,7.66 29.26,7.7 ; 46.94,25.32 47.17,25.37 ; 46.94,25.32 47.17,25.37 ; 46.94,25.32 46.7,25.37 ; 46.94,25.32 46.7,25.37 ; 10.49,48.56 10.72,48.61 ; 10.49,48.56 10.26,48.61 ; 10.49,48.56 10.72,48.61 ; 10.49,48.56 10.26,48.61 ; 10.72,48.61 10.92,48.74 ; 10.72,48.61 10.92,48.74 ; 30.66,51.13 23.98,51.13 ; 30.66,51.13 23.98,51.13 ; 31.42,51.31 31.17,51.36 ; 31.42,51.31 31.63,51.17 ; 31.42,51.31 31.17,51.36 ; 31.42,51.31 31.63,51.17 ; 4.65,12.6 4.65,13.03 ; 4.65,12.6 4.65,13.03 ; 4.65,12.6 4.75,12.65 ; 4.65,12.6 4.75,12.65 ; 45.97,46.05 46.21,46.09 ; 45.97,46.05 46.21,46.09 ; 46.21,46.09 46.41,46.23 ; 46.21,46.09 46.41,46.23 ; 19.56,22.5 19.32,22.55 ; 19.56,22.5 19.32,22.55 ; 45.41,46.42 45.36,46.66 ; 45.41,46.42 45.36,46.66 ; 19.43,32.61 19.27,32.4 ; 19.43,32.61 19.27,32.4 ; 19.43,32.61 19.43,37.99 ; 19.43,32.61 19.43,37.99 ; 19.27,32.4 19.2,32.15 ; 19.27,32.4 19.2,32.15 ; 19.6,19.96 19.23,19.59 ; 19.6,19.96 19.23,19.59 ; 19.6,19.96 19.56,19.96 ; 19.6,19.96 19.56,19.96 ; 19.23,19.59 19.07,19.53 ; 19.23,19.59 19.07,19.53 ; 38.46,7.84 38.59,8.03 ; 38.46,7.84 38.59,8.03 ; 38.59,8.03 38.63,8.27 ; 38.59,8.03 38.63,8.27 ; 16.41,8.27 16.46,8.03 ; 16.41,8.27 16.46,8.03 ; 18.84,21.88 18.82,21.72 ; 18.84,21.88 18.82,21.72 ; 30.96,16.97 31.07,17.04 ; 30.96,16.97 31.07,17.04 ; 22.09,8.03 22.13,8.27 ; 22.09,8.03 22.13,8.27 ; 25.02,33.5 25.02,35.01 ; 25.02,33.5 25.02,35.01 ; 25.02,35.01 25.18,35.21 ; 25.02,35.01 25.18,35.21 ; 41.61,23.81 41.48,24 ; 41.61,23.81 41.48,24 ; 41.48,24 41.28,24.14 ; 41.48,24 41.28,24.14 ; 5.41,18.22 5.21,18.09 ; 5.41,18.22 5.64,18.27 ; 5.41,18.22 5.21,18.09 ; 5.41,18.22 5.64,18.27 ; 38.97,55.05 38.84,55.25 ; 38.97,55.05 38.84,55.25 ; 38.97,55.05 39.02,54.81 ; 38.97,55.05 39.02,54.81 ; 27.19,24.29 27.05,24.38 ; 27.19,24.29 27.05,24.38 ; 8.93,8.4 8.91,8.27 ; 8.93,8.4 8.91,8.27 ; 23.59,8.5 23.46,8.7 ; 23.59,8.5 23.46,8.7 ; 23.59,8.5 23.63,8.27 ; 23.59,8.5 23.63,8.27 ; 23.46,8.7 23.26,8.83 ; 23.46,8.7 23.26,8.83 ; 36.96,7.84 37.09,8.03 ; 36.96,7.84 36.76,7.7 ; 36.96,7.84 37.09,8.03 ; 36.96,7.84 36.76,7.7 ; 43.79,7.7 43.59,7.84 ; 43.79,7.7 43.59,7.84 ; 44.91,8.27 44.96,8.03 ; 44.91,8.27 44.96,8.03 ; 44.96,8.03 45.09,7.84 ; 44.96,8.03 45.09,7.84 ; 25.48,46.58 25.73,46.53 ; 25.48,46.58 25.73,46.53 ; 21.98,37.82 21.36,37.82 ; 21.98,37.82 21.36,37.82 ; 12.32,23.2 2.36,13.24 ; 12.32,23.2 2.36,13.24 ; 10.31,33.2 10.26,32.97 ; 10.31,33.2 10.26,32.97 ; 11.12,57.13 11.24,57.12 ; 11.12,57.13 11.24,57.12 ; 6.4,34.62 6.45,34.37 ; 6.4,34.62 6.45,34.37 ; 39.14,22.54 39.02,22.47 ; 39.14,22.54 39.02,22.47 ; 39.02,22.47 38.86,22.41 ; 39.02,22.47 38.86,22.41 ; 22.91,51.51 22.96,51.26 ; 22.91,51.51 22.96,51.26 ; 31.78,50.95 31.63,51.17 ; 31.78,50.95 31.63,51.17 ; 39.17,29.74 39.21,29.87 ; 39.17,29.74 39.21,29.87 ; 39.17,29.74 39.04,29.54 ; 39.17,29.74 39.04,29.54 ; 39.21,29.87 39.27,30.02 ; 39.21,29.87 39.27,30.02 ; 40.75,42.7 40.51,42.75 ; 40.75,42.7 40.51,42.75 ; 38.76,19.82 38.98,19.72 ; 38.76,19.82 38.61,19.89 ; 38.76,19.82 38.61,19.89 ; 38.76,19.82 38.98,19.72 ; 35.99,53.05 35.79,53.19 ; 35.99,53.05 35.79,53.19 ; 9.57,8.93 9.42,8.87 ; 9.57,8.93 12.38,11.74 ; 9.57,8.93 9.42,8.87 ; 9.57,8.93 12.38,11.74 ; 31.17,50.03 31.42,50.09 ; 31.17,50.03 31.42,50.09 ; 20.55,16.18 20.8,16.23 ; 20.55,16.18 20.8,16.23 ; 47.26,8.83 47.02,8.88 ; 47.26,8.83 47.02,8.88 ; 10.92,8.87 10.69,8.78 ; 10.92,8.87 10.69,8.78 ; 8.84,9.34 9.32,9.83 ; 8.84,9.34 9.32,9.83 ; 5.79,48.62 5.69,48.48 ; 5.79,48.62 5.69,48.48 ; 5.79,48.62 6.65,49.48 ; 5.79,48.62 6.65,49.48 ; 5.69,48.48 5.66,48.31 ; 5.69,48.48 5.66,48.31 ; 5.07,17.42 5.21,17.22 ; 5.07,17.42 5.21,17.22 ; 46.41,8.27 46.46,8.5 ; 46.41,8.27 46.46,8.5 ; 6.25,17.65 6.2,17.89 ; 6.25,17.65 6.2,17.89 ; 6.2,17.89 6.07,18.09 ; 6.2,17.89 6.07,18.09 ; 2.91,8.27 2.96,8.03 ; 2.91,8.27 2.96,8.03 ; 19.07,18.22 19.3,18.27 ; 19.07,18.22 19.3,18.27 ; 41.94,10.94 42.05,11.11 ; 41.94,10.94 40.9,9.9 ; 41.94,10.94 42.05,11.11 ; 41.94,10.94 40.9,9.9 ; 42.05,11.11 42.09,11.3 ; 42.05,11.11 42.09,11.3 ; 23.02,8.88 23.26,8.83 ; 23.02,8.88 23.26,8.83 ; 8.84,48.51 8.97,48.32 ; 8.84,48.51 8.97,48.32 ; 38.96,8.5 38.91,8.27 ; 38.96,8.5 38.91,8.27 ; 40.54,9.75 40.73,9.79 ; 40.54,9.75 40.73,9.79 ; 20.26,8.83 20.02,8.88 ; 20.26,8.83 20.02,8.88 ; 20.26,8.83 20.46,8.7 ; 20.26,8.83 20.46,8.7 ; 20.02,8.88 19.79,8.83 ; 20.02,8.88 19.79,8.83 ; 33.6,47.37 33.74,47.57 ; 33.6,47.37 33.74,47.57 ; 33.6,47.37 33.41,47.24 ; 33.6,47.37 33.41,47.24 ; 33.74,47.57 33.78,47.8 ; 33.74,47.57 33.78,47.8 ; 46.79,7.7 47.02,7.66 ; 46.79,7.7 47.02,7.66 ; 33.78,47.8 33.74,48.04 ; 33.78,47.8 33.74,48.04 ; 37.41,8.27 37.46,8.03 ; 37.41,8.27 37.46,8.03 ; 37.41,8.27 37.46,8.5 ; 37.41,8.27 37.46,8.5 ; 37.46,8.03 37.59,7.84 ; 37.46,8.03 37.59,7.84 ; 38.45,19.89 38.61,19.89 ; 38.45,19.89 38.54,19.74 ; 38.45,19.89 38.54,19.74 ; 38.45,19.89 38.61,19.89 ; 34.31,47.37 34.51,47.24 ; 34.31,47.37 34.51,47.24 ; 18.29,8.83 18.09,8.7 ; 18.29,8.83 18.52,8.88 ; 18.29,8.83 18.52,8.88 ; 18.29,8.83 18.09,8.7 ; 1.5,9.8 1.5,8.71 ; 1.5,9.8 1.5,8.71 ; 1.5,9.8 0.63,10.66 ; 1.5,9.8 0.63,10.66 ; 24.29,8.83 24.09,8.7 ; 24.29,8.83 24.09,8.7 ; 46.45,47.04 46.27,47.19 ; 46.45,47.04 46.27,47.19 ; 6.52,8.88 6.76,8.83 ; 6.52,8.88 6.76,8.83 ; 22.41,8.27 22.46,8.03 ; 22.41,8.27 22.46,8.03 ; 38.59,19.51 38.54,19.74 ; 38.59,19.51 38.54,19.74 ; 22.3,50.59 22.55,50.64 ; 22.3,50.59 22.55,50.64 ; 4.94,29.06 4.9,28.83 ; 4.94,29.06 4.9,28.83 ; 39.02,21.47 39.24,21.37 ; 39.02,21.47 39.24,21.37 ; 22.55,50.64 22.77,50.79 ; 22.55,50.64 22.77,50.79 ; 13.97,22.44 14.07,22.43 ; 13.97,22.44 14.07,22.43 ; 13.97,22.44 13.74,22.52 ; 13.97,22.44 13.74,22.52 ; 14.07,22.43 14.31,22.47 ; 14.07,22.43 14.31,22.47 ; 39.98,13.81 40.12,13.84 ; 39.98,13.81 40.12,13.84 ; 40.12,13.84 40.23,13.92 ; 40.12,13.84 40.23,13.92 ; 9.09,7.84 8.96,8.03 ; 9.09,7.84 8.96,8.03 ; 20.59,8.03 20.63,8.27 ; 20.59,8.03 20.46,7.84 ; 20.59,8.03 20.46,7.84 ; 20.59,8.03 20.63,8.27 ; 20.63,8.27 20.59,8.5 ; 20.63,8.27 20.59,8.5 ; 25.73,46.53 25.78,46.53 ; 25.73,46.53 25.78,46.53 ; 37.59,7.84 37.79,7.7 ; 37.59,7.84 37.79,7.7 ; 14.96,8.03 15.09,7.84 ; 14.96,8.03 15.09,7.84 ; 46.46,8.5 46.59,8.7 ; 46.46,8.5 46.59,8.7 ; 18.96,7.84 18.76,7.7 ; 18.96,7.84 18.76,7.7 ; 10.72,49.74 10.49,49.79 ; 10.72,49.74 10.49,49.79 ; 38.91,8.27 38.96,8.03 ; 38.91,8.27 38.96,8.03 ; 36.65,53.19 36.79,53.38 ; 36.65,53.19 36.79,53.38 ; 13.59,7.84 13.79,7.7 ; 13.59,7.84 13.79,7.7 ; 13.79,7.7 14.02,7.66 ; 13.79,7.7 14.02,7.66 ; 36.9,31.49 36.85,31.72 ; 36.9,31.49 36.85,31.72 ; 38.04,29.74 38.18,29.54 ; 38.04,29.74 38.18,29.54 ; 11.94,51.69 3.61,51.69 ; 11.94,51.69 3.61,51.69 ; 3.61,51.69 3.44,51.66 ; 3.61,51.69 3.44,51.66 ; 40.51,41.53 40.75,41.57 ; 40.51,41.53 40.75,41.57 ; 40.75,41.57 40.95,41.7 ; 40.75,41.57 40.95,41.7 ; 43.46,8.5 43.59,8.7 ; 43.46,8.5 43.59,8.7 ; 16.23,32.55 16.31,32.78 ; 16.23,32.55 16.08,32.36 ; 16.23,32.55 16.08,32.36 ; 16.23,32.55 16.31,32.78 ; 46.09,8.03 46.13,8.27 ; 46.09,8.03 46.13,8.27 ; 19.07,19.53 18.85,19.44 ; 19.07,19.53 18.85,19.44 ; 36.51,15.73 36.65,15.59 ; 36.51,15.73 36.65,15.59 ; 34.79,7.7 35.02,7.66 ; 34.79,7.7 35.02,7.66 ; 34.79,7.7 34.59,7.84 ; 34.79,7.7 34.59,7.84 ; 10.09,8.03 10.13,8.16 ; 10.09,8.03 10.13,8.16 ; 37.95,38.58 38.08,38.39 ; 37.95,38.58 38.08,38.39 ; 38.96,8.03 39.09,7.84 ; 38.96,8.03 39.09,7.84 ; 39.09,7.84 39.29,7.7 ; 39.09,7.84 39.29,7.7 ; 34.51,47.24 34.75,47.19 ; 34.51,47.24 34.75,47.19 ; 39.46,41.37 39.34,41.38 ; 39.46,41.37 39.34,41.38 ; 38.61,29.36 38.84,29.41 ; 38.61,29.36 38.37,29.41 ; 38.61,29.36 38.37,29.41 ; 38.61,29.36 38.84,29.41 ; 38.84,29.41 39.04,29.54 ; 38.84,29.41 39.04,29.54 ; 26.96,8.03 27.09,7.84 ; 26.96,8.03 27.09,7.84 ; 27.09,7.84 27.29,7.7 ; 27.09,7.84 27.29,7.7 ; 21.57,27.11 21.77,26.98 ; 21.57,27.11 21.77,26.98 ; 36.52,7.66 36.76,7.7 ; 36.52,7.66 36.76,7.7 ; 28.09,8.03 28.13,8.27 ; 28.09,8.03 28.13,8.27 ; 8.59,8.03 8.63,8.27 ; 8.59,8.03 8.63,8.27 ; 10.49,49.79 10.26,49.74 ; 10.49,49.79 10.26,49.74 ; 9.9,12.88 8.71,11.69 ; 9.9,12.88 8.71,11.69 ; 24.28,32.99 24.38,32.92 ; 24.28,32.99 24.38,32.92 ; 15.8,19.81 16.01,19.95 ; 15.8,19.81 16.01,19.95 ; 15.8,19.81 15.54,19.76 ; 15.8,19.81 15.54,19.76 ; 16.01,19.95 16.16,20.17 ; 16.01,19.95 16.16,20.17 ; 24.06,49.95 23.94,49.72 ; 24.06,49.95 23.94,49.72 ; 8.71,11.69 8.62,11.54 ; 8.71,11.69 8.62,11.54 ; 8.62,11.54 8.58,11.38 ; 8.62,11.54 8.58,11.38 ; 19.59,7.84 19.79,7.7 ; 19.59,7.84 19.79,7.7 ; 12.87,11 10.19,8.32 ; 12.87,11 10.19,8.32 ; 33.75,38.99 33.95,38.86 ; 33.75,38.99 33.95,38.86 ; 33.95,38.86 34.19,38.81 ; 33.95,38.86 34.19,38.81 ; 6.53,36.04 6.53,48.13 ; 6.53,36.04 6.53,48.13 ; 8.63,8.27 8.59,8.5 ; 8.63,8.27 8.59,8.5 ; 8.59,8.5 8.46,8.7 ; 8.59,8.5 8.46,8.7 ; 34.09,8.03 34.13,8.27 ; 34.09,8.03 34.13,8.27 ; 34.13,8.27 34.09,8.5 ; 34.13,8.27 34.09,8.5 ; 47.26,7.7 47.46,7.84 ; 47.26,7.7 47.46,7.84 ; 47.26,7.7 47.02,7.66 ; 47.26,7.7 47.02,7.66 ; 20.96,8.03 20.91,8.27 ; 20.96,8.03 20.91,8.27 ; 28.37,39.58 28.12,39.63 ; 28.37,39.58 28.59,39.43 ; 28.37,39.58 28.59,39.43 ; 28.37,39.58 28.12,39.63 ; 28.12,39.63 27.86,39.58 ; 28.12,39.63 27.86,39.58 ; 32.84,11.17 32.84,11.25 ; 32.84,11.17 32.84,11.25 ; 28.89,27.21 28.75,27.41 ; 28.89,27.21 28.75,27.41 ; 16.79,8.83 17.02,8.88 ; 16.79,8.83 17.02,8.88 ; 37.08,37.72 36.95,37.92 ; 37.08,37.72 36.95,37.92 ; 39.27,54.77 39.01,54.77 ; 39.27,54.77 39.01,54.77 ; 39.01,54.77 39.02,54.81 ; 39.01,54.77 39.02,54.81 ; 2.46,7.84 2.59,8.03 ; 2.46,7.84 2.26,7.7 ; 2.46,7.84 2.26,7.7 ; 2.46,7.84 2.59,8.03 ; 14.26,7.7 14.46,7.84 ; 14.26,7.7 14.02,7.66 ; 14.26,7.7 14.02,7.66 ; 14.26,7.7 14.46,7.84 ; 21.44,13.99 22.31,12.69 ; 21.44,13.99 22.31,12.69 ; 22.31,12.69 23.5,11.86 ; 22.31,12.69 23.5,11.86 ; 43.59,8.7 43.79,8.83 ; 43.59,8.7 43.79,8.83 ; 5.66,48.31 5.66,36.04 ; 5.66,48.31 5.66,36.04 ; 16.08,32.36 16.08,22.99 ; 16.08,32.36 16.08,22.99 ; 12.96,7.84 13.09,8.03 ; 12.96,7.84 12.76,7.7 ; 12.96,7.84 13.09,8.03 ; 12.96,7.84 12.76,7.7 ; 13.09,8.03 13.13,8.16 ; 13.09,8.03 13.13,8.16 ; 40.31,31.06 39.27,30.02 ; 40.31,31.06 39.27,30.02 ; 29.31,24.64 29.26,24.38 ; 29.31,24.64 29.26,24.38 ; 40.79,8.83 41.02,8.88 ; 40.79,8.83 41.02,8.88 ; 8.46,8.7 8.26,8.83 ; 8.46,8.7 8.26,8.83 ; 34.21,49.36 34.16,49.12 ; 34.21,49.36 34.34,49.56 ; 34.21,49.36 34.34,49.56 ; 34.21,49.36 34.16,49.12 ; 12.65,43.71 12.45,43.58 ; 12.65,43.71 12.45,43.58 ; 30.2,25.85 30.42,26 ; 30.2,25.85 29.95,25.8 ; 30.2,25.85 29.95,25.8 ; 30.2,25.85 30.42,26 ; 30.42,26 30.56,26.21 ; 30.42,26 30.56,26.21 ; 13.74,53.19 35.79,53.19 ; 13.74,53.19 35.79,53.19 ; 18.99,22.88 19.12,22.68 ; 18.99,22.88 19.12,22.68 ; 18.99,22.88 18.95,23.11 ; 18.99,22.88 18.95,23.11 ; 19.12,22.68 19.32,22.55 ; 19.12,22.68 19.32,22.55 ; 15.13,32.61 15.21,32.47 ; 15.13,32.61 15.21,32.47 ; 15.13,32.61 15.09,32.84 ; 15.13,32.61 15.09,32.84 ; 12.22,43.53 12.45,43.58 ; 12.22,43.53 12.45,43.58 ; 12.22,43.53 11.98,43.58 ; 12.22,43.53 11.98,43.58 ; 1.57,37.99 1.62,37.92 ; 1.57,37.99 1.62,37.92 ; 19.56,19.96 19.32,20.01 ; 19.56,19.96 19.32,20.01 ; 25.07,47.19 25.08,47.32 ; 25.07,47.19 25.08,47.32 ; 8.91,8.27 8.96,8.03 ; 8.91,8.27 8.96,8.03 ; 40.73,9.79 40.9,9.9 ; 40.73,9.79 40.9,9.9 ; 40.44,33.4 40.51,33.56 ; 40.44,33.4 40.51,33.56 ; 22.96,51.26 22.91,51 ; 22.96,51.26 22.91,51 ; 20.93,38.53 22.09,38.53 ; 20.93,38.53 20.3,37.89 ; 20.93,38.53 22.09,38.53 ; 20.93,38.53 20.3,37.89 ; 31.42,50.09 31.63,50.23 ; 31.42,50.09 31.63,50.23 ; 41.63,8.27 41.59,8.5 ; 41.63,8.27 41.59,8.5 ; 2.02,7.66 2.26,7.7 ; 2.02,7.66 2.26,7.7 ; 11.12,55.9 10.89,55.95 ; 11.12,55.9 10.89,55.95 ; 39.29,14.78 39.88,16.32 39.29,14.78 ; 39.29,14.78 38.71,16.32 39.29,14.78 ; 28.73,39.22 28.59,39.43 ; 28.73,39.22 28.59,39.43 ; 12.52,11.83 12.38,11.74 ; 12.52,11.83 12.69,11.86 ; 12.52,11.83 12.69,11.86 ; 12.52,11.83 12.38,11.74 ; 21.09,8.7 20.96,8.5 ; 21.09,8.7 20.96,8.5 ; 30.09,8.7 30.29,8.83 ; 30.09,8.7 30.29,8.83 ; 20.96,8.5 20.91,8.27 ; 20.96,8.5 20.91,8.27 ; 45.14,48.11 45,48.2 ; 45.14,48.11 45,48.2 ; 6.79,49.58 6.65,49.48 ; 6.79,49.58 6.96,49.61 ; 6.79,49.58 6.65,49.48 ; 6.79,49.58 6.96,49.61 ; 21.16,17.09 21.09,17.22 ; 21.16,17.09 21.21,16.84 ; 21.16,17.09 21.21,16.84 ; 21.16,17.09 21.09,17.22 ; 38.18,29.54 38.37,29.41 ; 38.18,29.54 38.37,29.41 ; 25.79,7.7 26.02,7.66 ; 25.79,7.7 26.02,7.66 ; 38.21,18.94 37.97,18.89 ; 38.21,18.94 37.97,18.89 ; 5.26,8.83 5.02,8.88 ; 5.26,8.83 5.02,8.88 ; 18.56,18.92 18.61,18.69 ; 18.56,18.92 18.61,18.69 ; 44.65,47.37 45.36,46.66 ; 44.65,47.37 45.36,46.66 ; 44.65,47.37 35.18,47.37 ; 44.65,47.37 35.18,47.37 ; 40.97,22.96 40.74,23.04 ; 40.97,22.96 40.74,23.04 ; 2.52,10.01 2.48,10.2 ; 2.52,10.01 2.48,10.2 ; 24.26,30.2 24.21,30.45 ; 24.26,30.2 24.22,29.97 ; 24.26,30.2 24.22,29.97 ; 24.26,30.2 24.21,30.45 ; 24.21,30.45 24.07,30.67 ; 24.21,30.45 24.07,30.67 ; 37.94,15.73 38.08,15.59 ; 37.94,15.73 37.79,15.81 ; 37.94,15.73 37.79,15.81 ; 37.94,15.73 38.08,15.59 ; 13.74,22.3 13.74,22.52 ; 13.74,22.3 13.74,22.52 ; 29.69,25.85 29.95,25.8 ; 29.69,25.85 29.95,25.8 ; 1.53,49.75 1.62,49.89 ; 1.53,49.75 1.62,49.89 ; 36.65,15.59 36.73,15.37 36.65,15.59 ; 15.46,9.09 32.49,9.09 ; 15.46,9.09 32.49,9.09 ; 32.49,9.09 32.78,9.05 ; 32.49,9.09 32.78,9.05 ; 21.06,35.76 20.92,35.96 ; 21.06,35.76 20.92,35.96 ; 7.88,31.24 12.5,31.24 ; 7.88,31.24 12.5,31.24 ; 12.66,31.27 12.5,31.24 ; 12.66,31.27 12.5,31.24 ; 33.58,49.51 33.38,49.64 ; 33.58,49.51 33.38,49.64 ; 33.38,49.64 33.15,49.69 ; 33.38,49.64 33.15,49.69 ; 18.61,18.69 18.74,18.49 ; 18.61,18.69 18.74,18.49 ; 15.73,54.83 15.93,54.96 ; 15.73,54.83 15.93,54.96 ; 38.74,26.59 38.97,26.64 ; 38.74,26.59 38.97,26.64 ; 18.99,23.35 18.95,23.11 ; 18.99,23.35 18.95,23.11 ; 20.92,35.96 20.88,36.19 ; 20.92,35.96 20.88,36.19 ; 11.78,43.71 11.98,43.58 ; 11.78,43.71 11.98,43.58 ; 23.5,11.86 12.69,11.86 ; 23.5,11.86 12.69,11.86 ; 36.86,31.79 36.85,31.72 ; 36.86,31.79 36.85,31.72 ; 26.46,7.84 26.26,7.7 ; 26.46,7.84 26.26,7.7 ; 40.74,22.99 40.74,23.04 ; 40.74,22.99 40.74,23.04 ; 19.3,18.27 19.44,18.25 ; 19.3,18.27 19.44,18.25 ; 21.06,36.63 20.92,36.43 ; 21.06,36.63 20.92,36.43 ; 20.92,36.43 20.88,36.19 ; 20.92,36.43 20.88,36.19 ; 14.64,22.8 14.5,22.61 ; 14.64,22.8 14.5,22.61 ; 26.02,7.66 26.26,7.7 ; 26.02,7.66 26.26,7.7 ; 10.06,49.61 6.96,49.61 ; 10.06,49.61 10.26,49.74 ; 10.06,49.61 10.26,49.74 ; 10.06,49.61 6.96,49.61 ; 36.95,37.92 36.9,38.15 ; 36.95,37.92 36.9,38.15 ; 22.77,50.79 22.91,51 ; 22.77,50.79 22.91,51 ; 38.13,38.15 38.08,38.39 ; 38.13,38.15 38.08,38.39 ; 29.26,24.38 29.31,24.13 ; 29.26,24.38 29.31,24.13 ; 20.46,8.7 20.59,8.5 ; 20.46,8.7 20.59,8.5 ; 37.41,26.14 37.55,26.33 ; 37.41,26.14 37.55,26.33 ; 3.44,51.66 3.3,51.56 ; 3.44,51.66 3.3,51.56 ; 23.2,24.01 23.13,24.07 ; 23.2,24.01 23.13,24.07 ; 6.07,18.09 5.87,18.22 ; 6.07,18.09 5.87,18.22 ; 5.64,18.27 5.87,18.22 ; 5.64,18.27 5.87,18.22 ; 17.96,8.03 18.09,7.84 ; 17.96,8.03 18.09,7.84 ; 47.02,8.88 46.79,8.83 ; 47.02,8.88 46.79,8.83 ; 23.92,35.51 23.97,35.25 ; 23.92,35.51 23.97,35.25 ; 34.09,8.5 33.96,8.7 ; 34.09,8.5 33.96,8.7 ; 34.75,47.19 34.98,47.24 ; 34.75,47.19 34.98,47.24 ; 30.85,14.17 30.88,14.04 ; 30.85,14.17 30.88,14.04 ; 22.46,8.03 22.59,7.84 ; 22.46,8.03 22.59,7.84 ; 33.41,47.24 33.17,47.19 ; 33.41,47.24 33.17,47.19 ; 14.5,22.61 14.31,22.47 ; 14.5,22.61 14.31,22.47 ; 36.9,38.15 36.95,38.39 ; 36.9,38.15 36.95,38.39 ; 3.3,51.56 1.62,49.89 ; 3.3,51.56 1.62,49.89 ; 4.79,8.83 5.02,8.88 ; 4.79,8.83 5.02,8.88 ; 27.52,7.66 27.29,7.7 ; 27.52,7.66 27.29,7.7 ; 35.18,47.37 34.98,47.24 ; 35.18,47.37 34.98,47.24 ; 6.4,34.11 6.45,34.37 ; 6.4,34.11 6.45,34.37 ; 34.79,8.83 34.59,8.7 ; 34.79,8.83 34.59,8.7 ; 37.57,15.81 37.79,15.81 ; 37.57,15.81 37.79,15.81 ; 22.98,30.45 22.93,30.2 ; 22.98,30.45 22.93,30.2 ; 27.76,8.83 27.52,8.88 ; 27.76,8.83 27.52,8.88 ; 46.79,8.83 46.59,8.7 ; 46.79,8.83 46.59,8.7 ; 10.13,8.16 10.19,8.32 ; 10.13,8.16 10.19,8.32 ; 14.59,33.15 19.43,37.99 ; 14.59,33.15 19.43,37.99 ; 32.78,9.05 32.89,9.04 ; 32.78,9.05 32.89,9.04 ; 36.73,15.81 36.73,14.78 36.73,15.81
  Bottom Layer w0.254: 17.15,49.07 33.15,49.07 17.15,49.07 ; 17.15,49.07 12.22,44.14 17.15,49.07 ; 17.73,47.8 33.17,47.8 17.73,47.8 ; 17.73,47.8 14.15,44.22 17.73,47.8 ; 23.6,30.2 23.6,24.54 23.6,30.2
  Bottom Layer w0.305: 2.01,8.28 2.02,8.27 2.01,8.28 ; 2.01,8.28 2.01,10.01 ; 2.01,8.28 2.01,10.01 ; 40.54,10.26 39.6,10.26 40.54,10.26 ; 40.54,10.26 41.58,11.3 ; 40.54,10.26 41.58,11.3 ; 46.97,40.79 46.97,50.01 ; 46.97,40.79 46.95,40.77 ; 46.97,40.79 46.97,50.01 ; 46.97,40.79 46.97,25.96 ; 46.97,40.79 46.95,40.77 ; 46.97,40.79 46.97,25.96 ; 46.97,50.01 40.46,56.52 ; 46.97,50.01 40.46,56.52 ; 2.01,10.01 0.99,11.02 ; 2.01,10.01 0.99,11.02 ; 41.58,22.76 44.73,25.91 41.58,22.76 ; 41.58,22.76 41.58,11.3 ; 41.58,22.76 41.58,11.3 ; 46.95,40.77 39.34,40.77 46.95,40.77 ; 46.97,25.96 46.94,25.93 46.97,25.96 ; 0.99,17.86 0.99,12.73 ; 0.99,17.86 0.99,12.73 ; 0.99,17.86 0.99,38.48 0.99,17.86 ; 0.99,12.73 2.57,12.73 ; 0.99,12.73 0.99,11.02 ; 0.99,12.73 2.57,12.73 ; 0.99,12.73 0.99,11.02 ; 12.83,22.99 12.83,28.65 12.83,22.99 ; 12.83,22.99 2.57,12.73 ; 12.83,22.99 2.57,12.73 ; 40.46,56.52 11.12,56.52 40.46,56.52
